# EAGLE schematic MainECU rev16 (EAGLE 9.6.2)

## Sheet 1 of 9
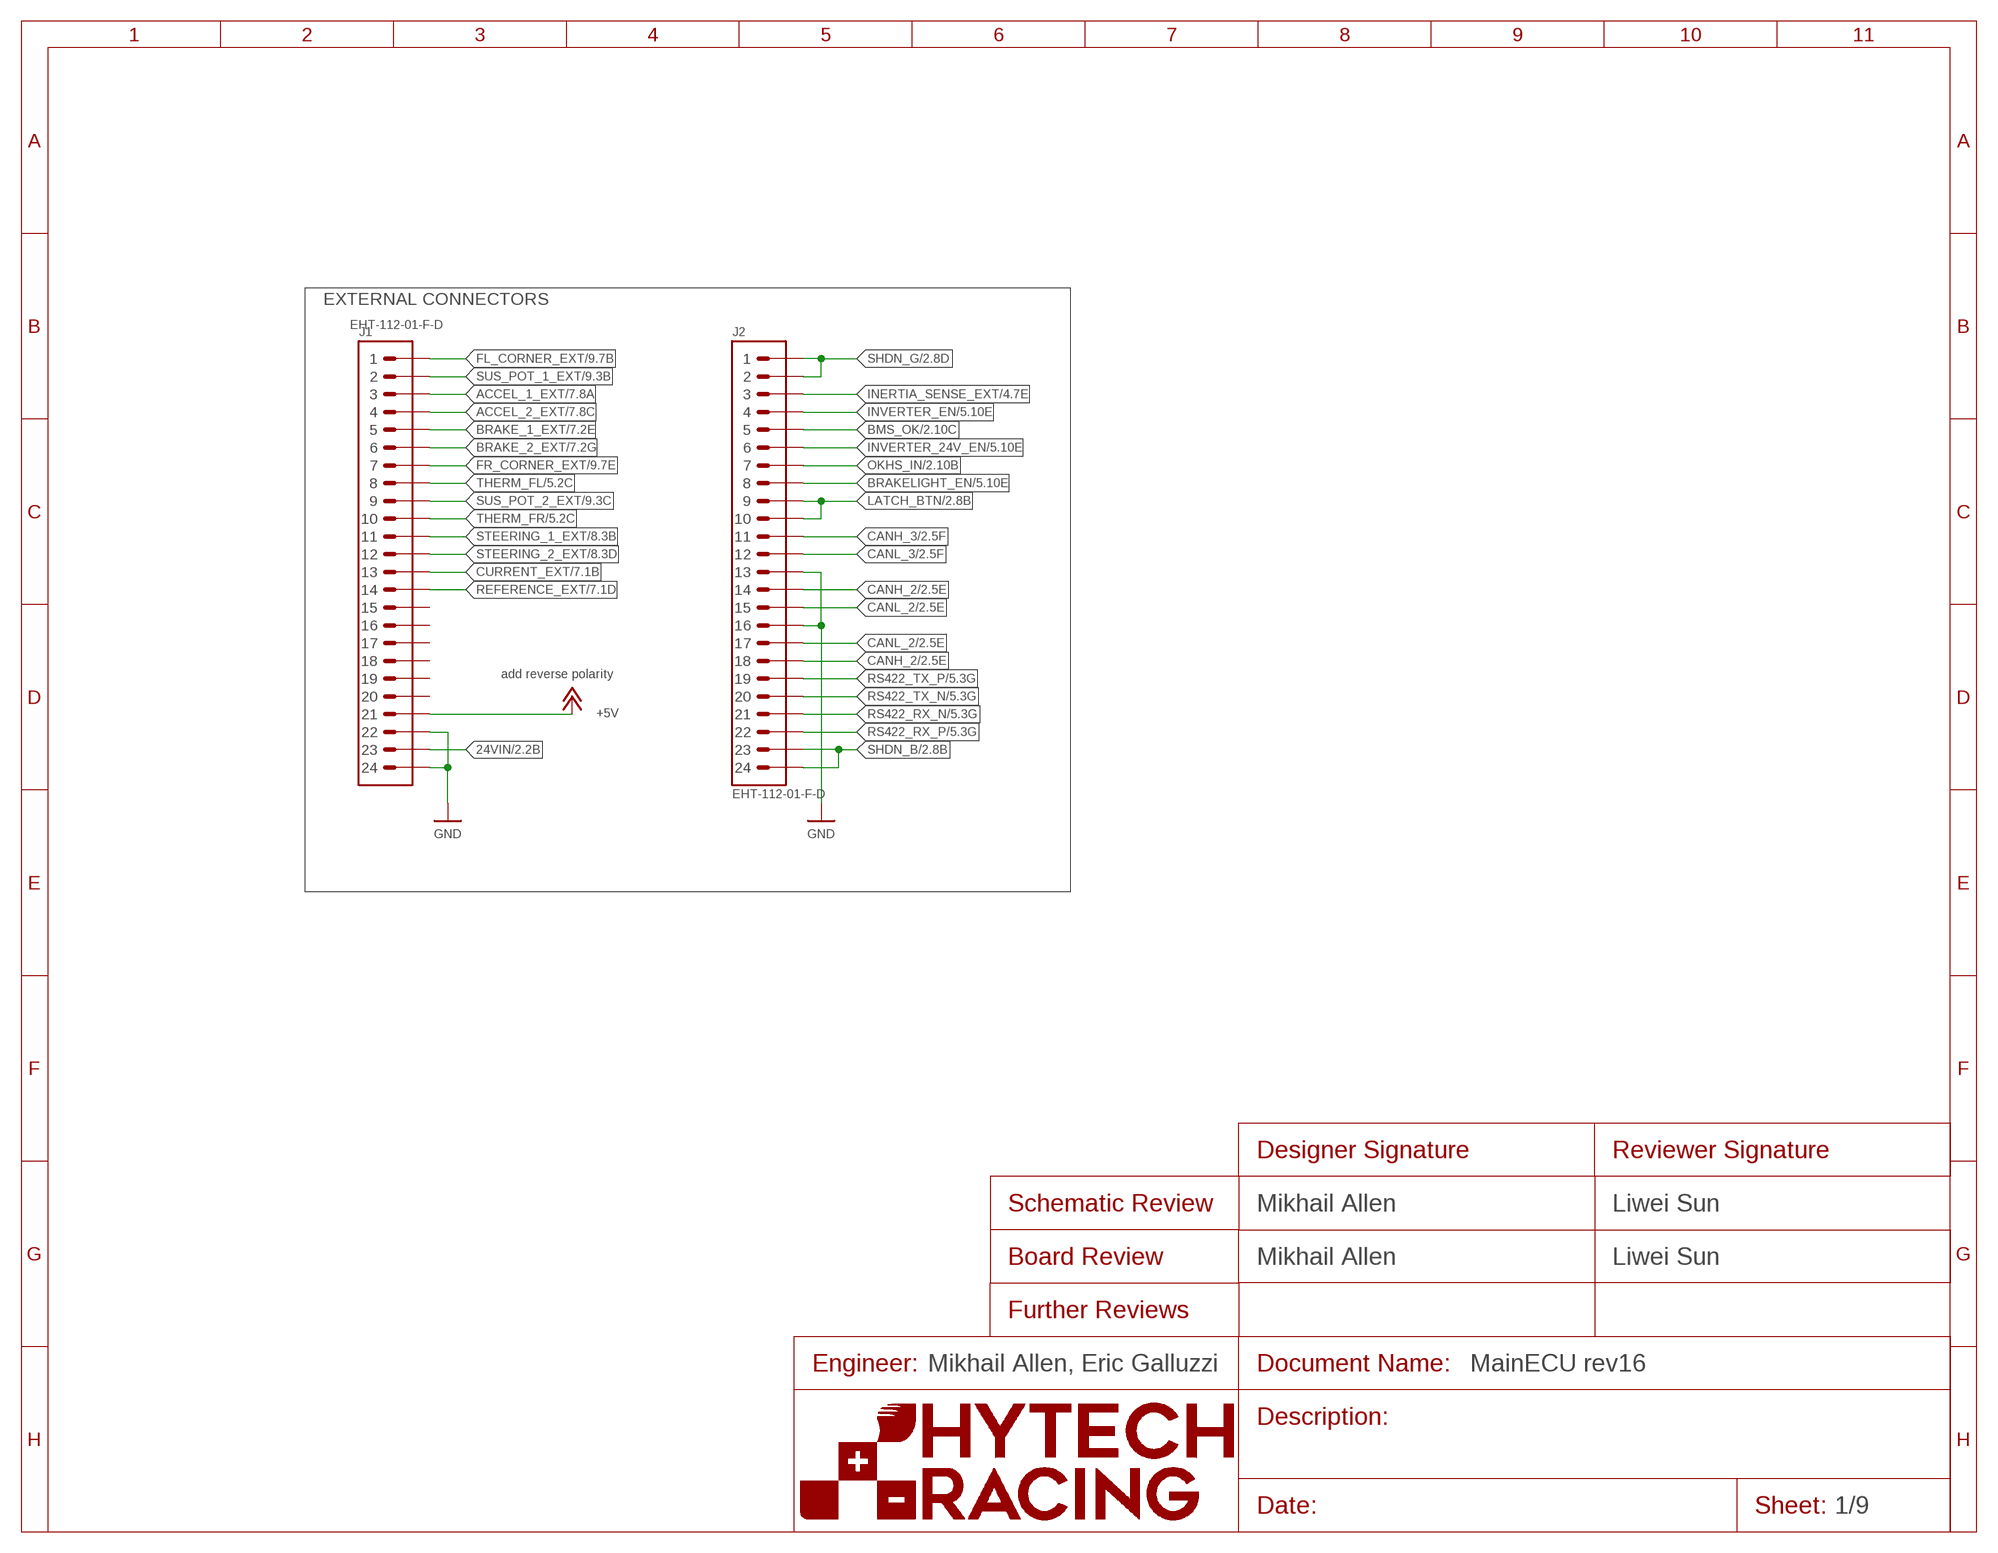
[diagram p0: schematic, sheet 1]
FRAME8 (FRAME): DESIGNER_BOARD: Mikhail Allen; DESIGNER_SCHEMATIC: Mikhail Allen; ENGINEER: Mikhail Allen, Eric Galluzzi; REVIEWER_BOARD: Liwei Sun; REVIEWER_SCHEMATIC: Liwei Sun

### Parts
J1  CONNECTOR-24_CONNECTOR-24_  [EHT-112-01]
J2  CONNECTOR-24_CONNECTOR-24_  [EHT-112-01]

### Nets
24VIN: J1.23 ; also sheet 2
+5V: J1.21 ; also sheet 2,3,5,6,7
ACCEL_1_EXT: J1.3 ; also sheet 7
ACCEL_2_EXT: J1.4 ; also sheet 7
BMS_OK: J2.5 ; also sheet 2,4
BRAKE_1_EXT: J1.5 ; also sheet 7
BRAKE_2_EXT: J1.6 ; also sheet 7
BRAKELIGHT_EN: J2.8 ; also sheet 5
CANH_2 [diff pairs]: J2.14 J2.18 ; also sheet 2,5,6
CANH_3 [diff pairs]: J2.11 ; also sheet 2,5,6
CANL_2 [diff pairs]: J2.15 J2.17 ; also sheet 2,5,6
CANL_3 [diff pairs]: J2.12 ; also sheet 2,5,6
CURRENT_EXT: J1.13 ; also sheet 7
FL_CORNER_EXT [diff pairs]: J1.1 ; also sheet 9
FR_CORNER_EXT: J1.7 ; also sheet 9
GND: J1.22 J1.24 J2.13 J2.16 ; also sheet 2,3,4,5,6,7,8,9
INERTIA_SENSE_EXT: J2.3 ; also sheet 4
INVERTER_24V_EN: J2.6 ; also sheet 5
INVERTER_EN: J2.4 ; also sheet 5
LATCH_BTN: J2.9 J2.10 ; also sheet 2,4
OKHS_IN: J2.7 ; also sheet 2,4
REFERENCE_EXT: J1.14 ; also sheet 7
RS422_RX_N [diff pairs]: J2.21 ; also sheet 5
RS422_RX_P [diff pairs]: J2.22 ; also sheet 5
RS422_TX_N [diff pairs]: J2.20 ; also sheet 5
RS422_TX_P [diff pairs]: J2.19 ; also sheet 5
SHDN_B: J2.23 J2.24 ; also sheet 2,4
SHDN_G: J2.1 J2.2 ; also sheet 2,4
STEERING_1_EXT: J1.11 ; also sheet 8
STEERING_2_EXT: J1.12 ; also sheet 8
SUS_POT_1_EXT [diff pairs]: J1.2 ; also sheet 9
SUS_POT_2_EXT: J1.9 ; also sheet 9
THERM_FL: J1.8 ; also sheet 5,8
THERM_FR: J1.10 ; also sheet 5,8
Unconnected: J1.15 J1.16 J1.17 J1.18 J1.19 J1.20

### Notes on the sheet
- EXTERNAL CONNECTORS
- add reverse polarity

## Sheet 2 of 9
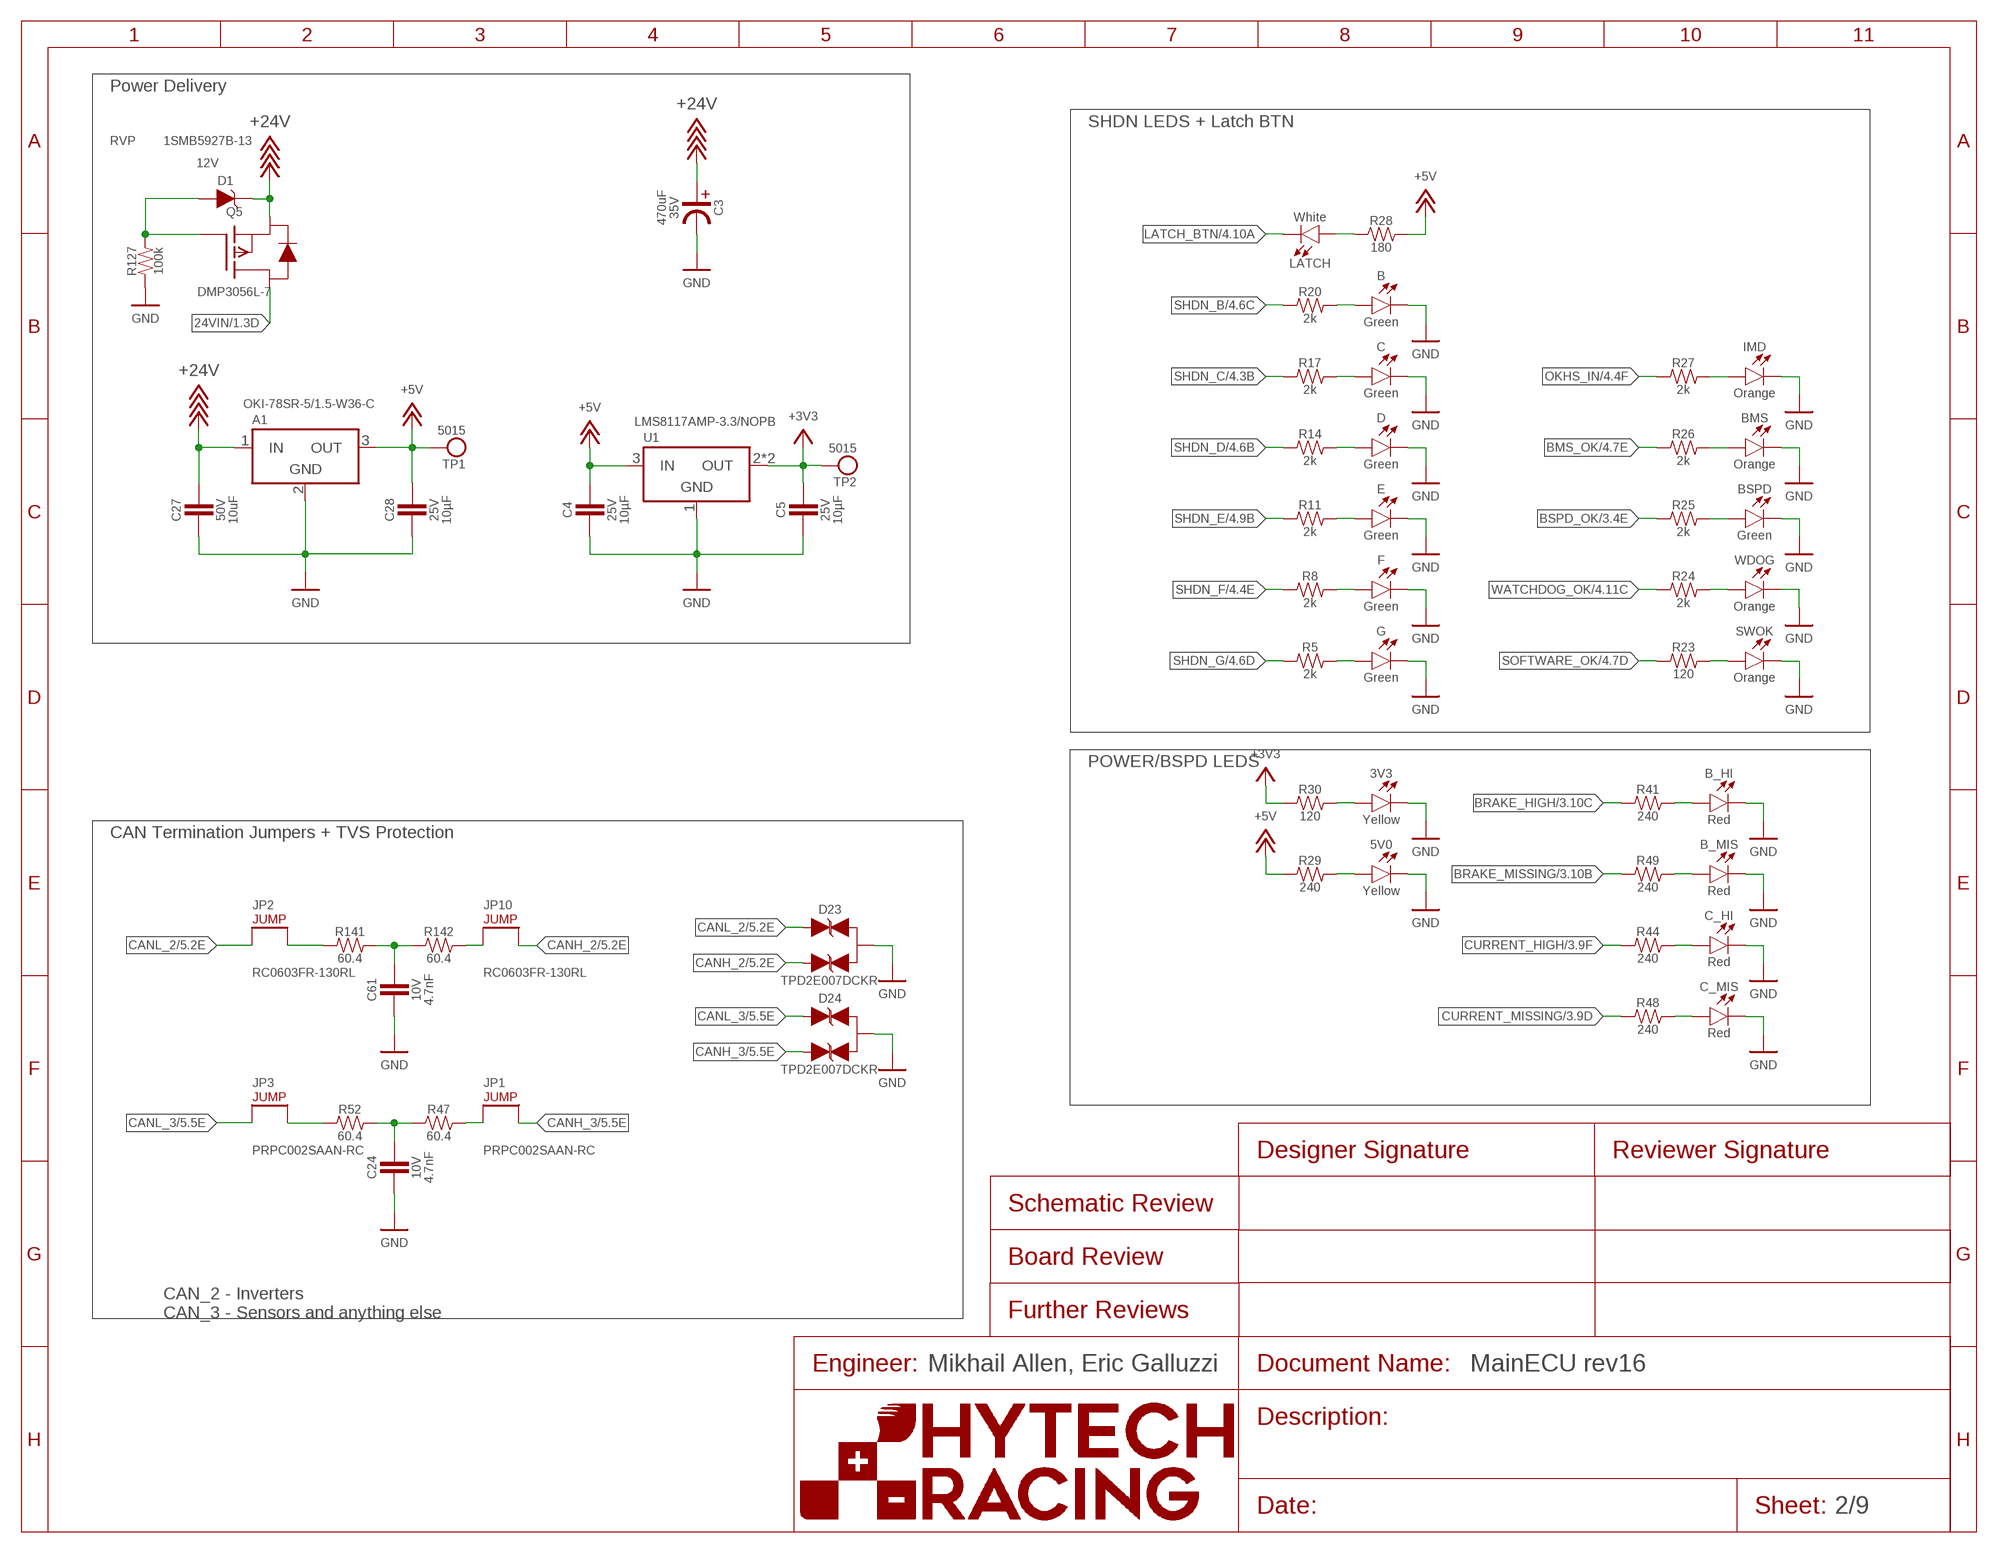
[diagram p1: schematic, sheet 2]
FRAME1 (FRAME): ENGINEER: Mikhail Allen, Eric Galluzzi

### Parts
3V3  LED_0603_YELLOW  [0603-LED]
5V0  LED_0603_YELLOW  [0603-LED]
A1  VOLTAGE_REGULATOR_MODULE_OKI-78SR_5V  [OKI-78SR(VERTICAL)]
B  LED_0603_GREEN  [0603-LED]
B_HI  LED_0603_RED  [0603-LED]
B_MIS  LED_0603_RED  [0603-LED]
BMS  LED_0603_ORANGE  [0603-LED]
BSPD  LED_0603_GREEN  [0603-LED]
C  LED_0603_GREEN  [0603-LED]
C3  CAPACITOR_ELECTROLYTIC_EEH_AZS_470UF  [EEH-AZS]
C4  CAPACITOR_0603_25V_10UF  [0603-CAP]
C5  CAPACITOR_0603_25V_10UF  [0603-CAP]
C24  CAPACITOR_0603_10V_4.7NF  [0603-CAP]
C27  CAPACITOR_0805_50V_10UF  [0805-CAP]
C28  CAPACITOR_0603_25V_10UF  [0603-CAP]
C61  CAPACITOR_0603_10V_4.7NF  [0603-CAP]
C_HI  LED_0603_RED  [0603-LED]
C_MIS  LED_0603_RED  [0603-LED]
D  LED_0603_GREEN  [0603-LED]
D1  ZENER_1.5SMBJ_12V  [1.5SMBJ]
D23  TVS_BIDIRECTIONAL_DUAL  [SC-70-3]
D24  TVS_BIDIRECTIONAL_DUAL  [SC-70-3]
E  LED_0603_GREEN  [0603-LED]
F  LED_0603_GREEN  [0603-LED]
G  LED_0603_GREEN  [0603-LED]
IMD  LED_0603_ORANGE  [0603-LED]
JP1  JUMPER__1X02  [1X02]
JP2  JUMPER_0603_  [0603-RES]
JP3  JUMPER__1X02  [1X02]
JP10  JUMPER_0603_  [0603-RES]
LATCH  LED_0603_WHITE  [0603-LED]
Q5  TRANSISTOR_P_MOS_SOT-23_DMP3056L-7  [SOT-23]
R5  RESISTOR_0603_2K  [0603-RES]
R8  RESISTOR_0603_2K  [0603-RES]
R11  RESISTOR_0603_2K  [0603-RES]
R14  RESISTOR_0603_2K  [0603-RES]
R17  RESISTOR_0603_2K  [0603-RES]
R20  RESISTOR_0603_2K  [0603-RES]
R23  RESISTOR_0603_120  [0603-RES]
R24  RESISTOR_0603_2K  [0603-RES]
R25  RESISTOR_0603_2K  [0603-RES]
R26  RESISTOR_0603_2K  [0603-RES]
R27  RESISTOR_0603_2K  [0603-RES]
R28  RESISTOR_0603_180  [0603-RES]
R29  RESISTOR_0603_240  [0603-RES]
R30  RESISTOR_0603_120  [0603-RES]
R41  RESISTOR_0603_240  [0603-RES]
R44  RESISTOR_0603_240  [0603-RES]
R47  RESISTOR_0603_60.4  [0603-RES]
R48  RESISTOR_0603_240  [0603-RES]
R49  RESISTOR_0603_240  [0603-RES]
R52  RESISTOR_0603_60.4  [0603-RES]
R127  RESISTOR_0603_100K  [0603-RES]
R141  RESISTOR_0603_60.4  [0603-RES]
R142  RESISTOR_0603_60.4  [0603-RES]
SWOK  LED_0603_ORANGE  [0603-LED]
TP1  TEST_POINT  [5015]
TP2  TEST_POINT  [5015]
U1  VOLTAGE_REGULATOR_SOT-223_3.3V  [SOT-223]
WDOG  LED_0603_ORANGE  [0603-LED]

### Nets
24VIN: Q5.3(D) ; also sheet 1
+3V3: C5.1 R30.1 TP2.1 U1.2(OUT) U1.4(OUT) ; also sheet 3,4,5,6,7,8,9
+5V: A1.3(OUT) C4.1 C28.1 R28.2 R29.1 TP1.1 U1.3(IN) ; also sheet 1,3,5,6,7
+24V: A1.1(IN) C3.PLUS C27.1 D1.2(C) Q5.2(S) ; also sheet 3,4,6
BMS_OK: R26.1 ; also sheet 1,4
BRAKE_HIGH: R41.1 ; also sheet 3
BRAKE_MISSING: R49.1 ; also sheet 3
BSPD_OK: R25.1 ; also sheet 3,4
CANH_2 [diff pairs]: D23.2(C2) JP10.2 ; also sheet 1,5,6
CANH_3 [diff pairs]: D24.2(C2) JP1.2 ; also sheet 1,5,6
CANL_2 [diff pairs]: D23.1(C1) JP2.1 ; also sheet 1,5,6
CANL_3 [diff pairs]: D24.1(C1) JP3.1 ; also sheet 1,5,6
CURRENT_HIGH: R44.1 ; also sheet 3
CURRENT_MISSING: R48.1 ; also sheet 3
GND: 3V3.1(C) 5V0.1(C) A1.2(GND) B.1(C) B_HI.1(C) B_MIS.1(C) BMS.1(C) BSPD.1(C) C3.MINUS C4.2 C5.2 C24.2 C27.2 C28.2 C61.2 C.1(C) C_HI.1(C) C_MIS.1(C) D23.3(A) D24.3(A) D.1(C) E.1(C) F.1(C) G.1(C) IMD.1(C) R127.1 SWOK.1(C) U1.1(GND) WDOG.1(C) ; also sheet 1,3,4,5,6,7,8,9
LATCH_BTN: LATCH.1(C) ; also sheet 1,4
N$2: JP10.1 R142.2
N$6: JP1.1 R47.2
N$7: C61.1 R141.2 R142.1
N$8: C24.1 R47.1 R52.2
N$9: JP3.2 R52.1
N$13: G.2(A) R5.2
N$15: LATCH.2(A) R28.1
N$16: B.2(A) R20.2
N$17: C.2(A) R17.2
N$18: D.2(A) R14.2
N$19: E.2(A) R11.2
N$20: F.2(A) R8.2
N$28: B_MIS.2(A) R49.2
N$29: C_HI.2(A) R44.2
N$30: C_MIS.2(A) R48.2
N$36: D1.1(A) Q5.1(G) R127.2
N$37: JP2.2 R141.1
N$40: IMD.2(A) R27.2
N$41: BMS.2(A) R26.2
N$42: BSPD.2(A) R25.2
N$43: R24.2 WDOG.2(A)
N$44: 3V3.2(A) R30.2
N$45: R23.2 SWOK.2(A)
N$47: 5V0.2(A) R29.2
N$56: B_HI.2(A) R41.2
OKHS_IN: R27.1 ; also sheet 1,4
SHDN_B: R20.1 ; also sheet 1,4
SHDN_C: R17.1 ; also sheet 4
SHDN_D: R14.1 ; also sheet 4
SHDN_E: R11.1 ; also sheet 4
SHDN_F: R8.1 ; also sheet 4
SHDN_G: R5.1 ; also sheet 1,4
SOFTWARE_OK: R23.1 ; also sheet 4,5
WATCHDOG_OK: R24.1 ; also sheet 4

### Notes on the sheet
- Power Delivery
- SHDN LEDS + Latch BTN
- RVP
- POWER/BSPD LEDS
- CAN Termination Jumpers + TVS Protection
- CAN_2 - Inverters
  CAN_3 - Sensors and anything else

## Sheet 3 of 9
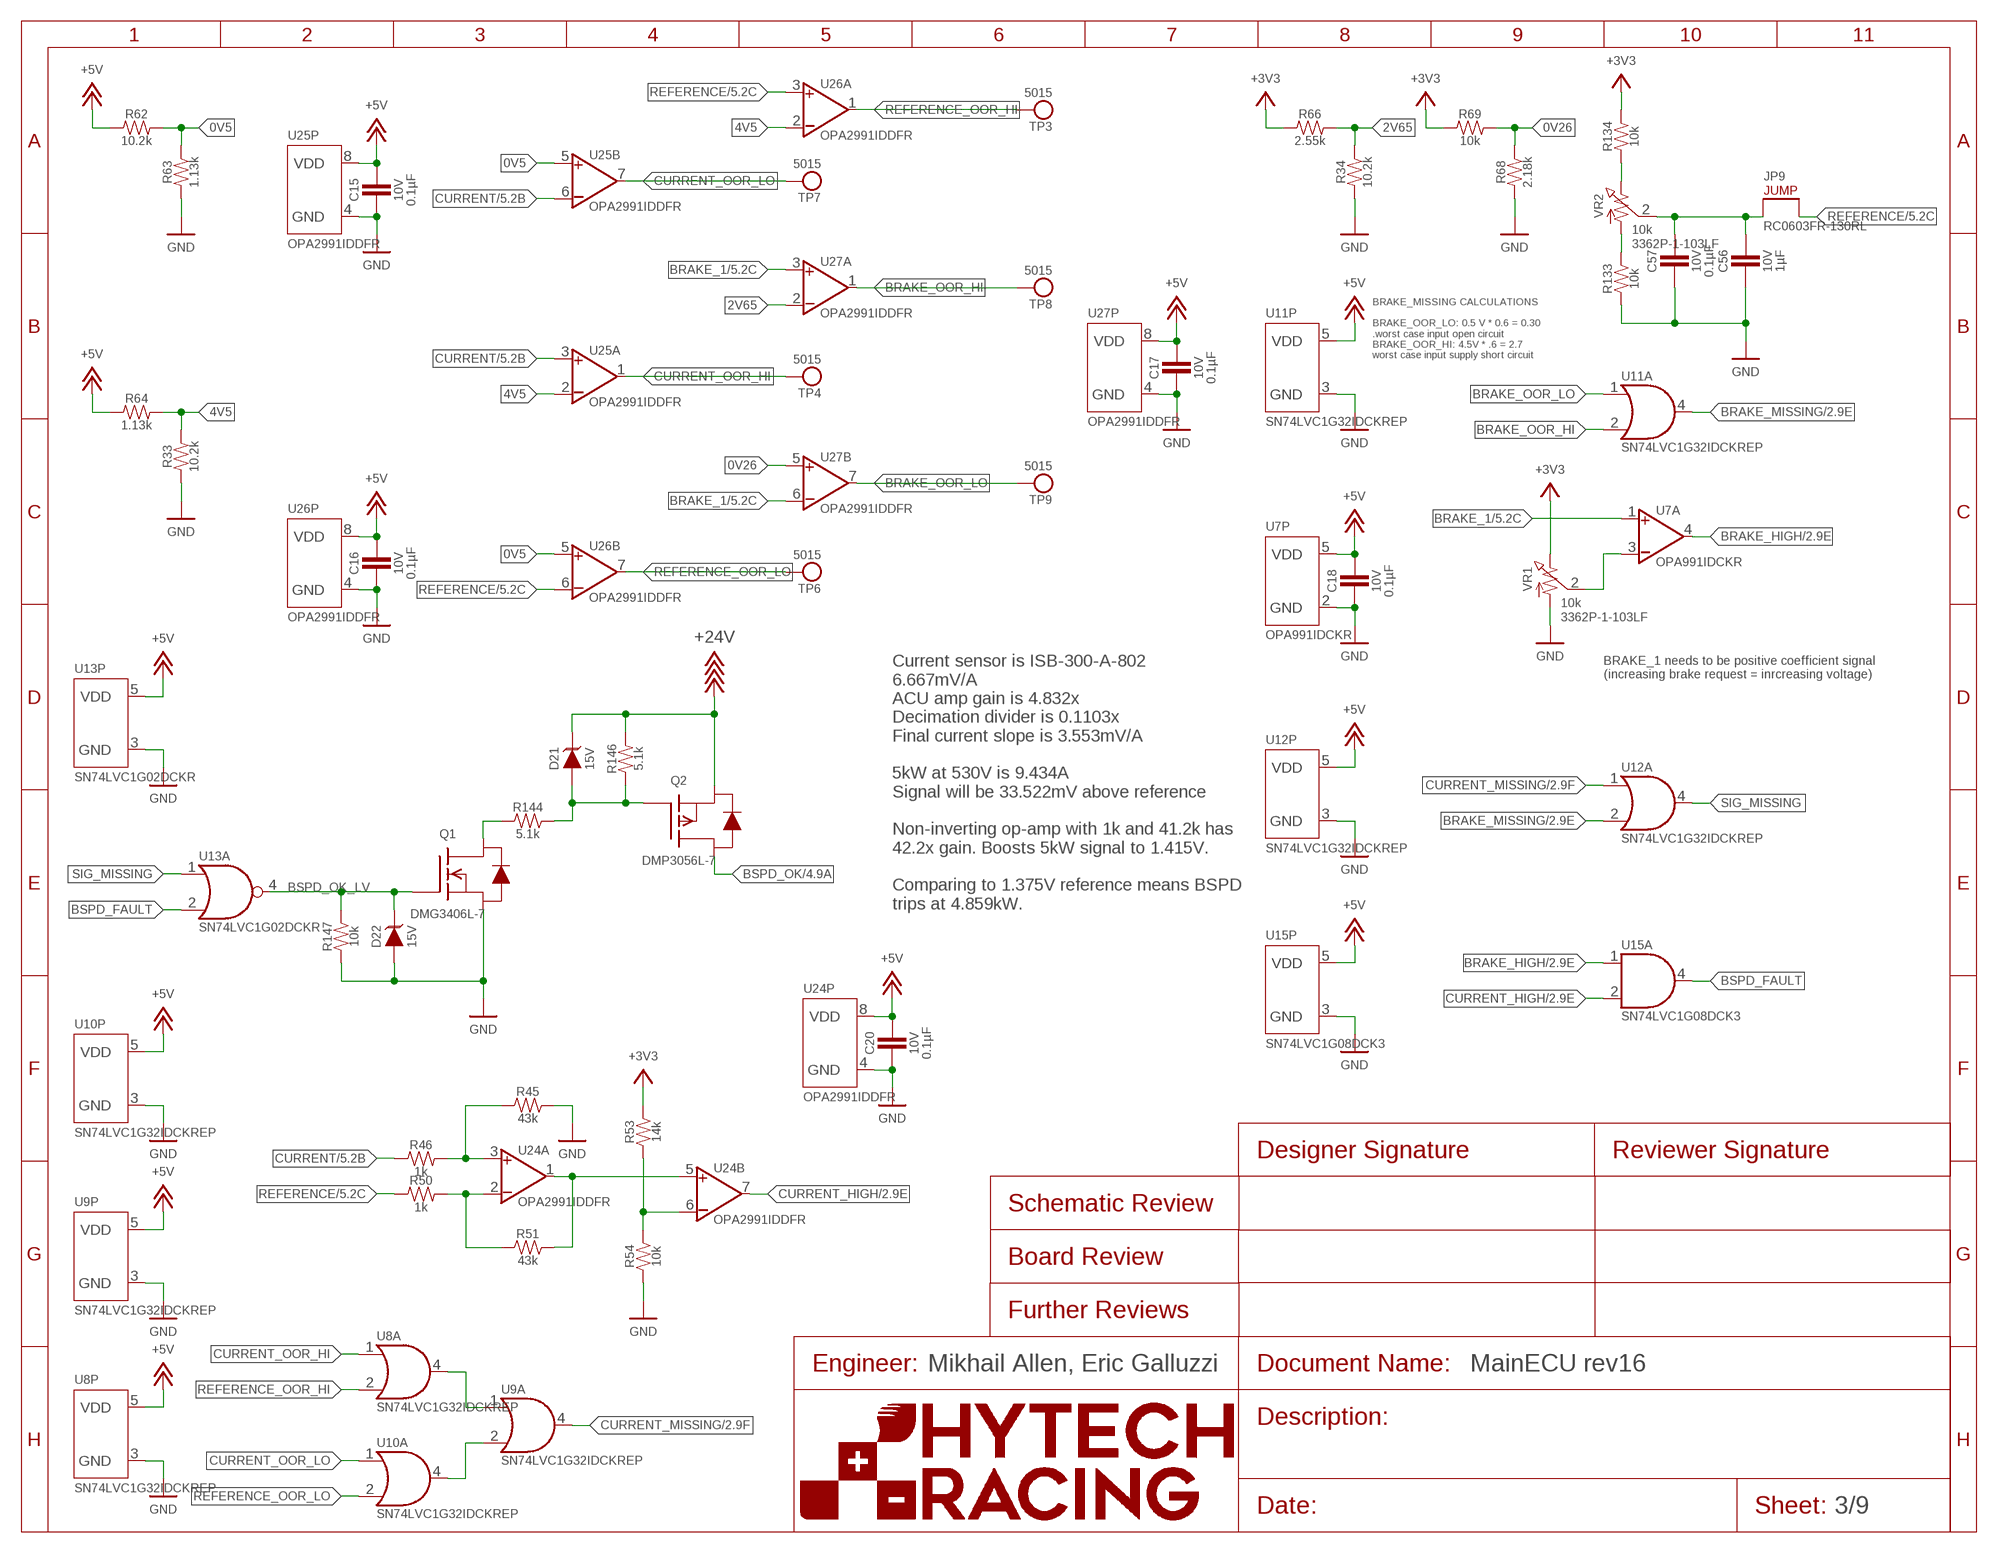
[diagram p2: schematic, sheet 3]
FRAME7 (FRAME): ENGINEER: Mikhail Allen, Eric Galluzzi

### Parts
C15  CAPACITOR_0603_10V_0.1UF  [0603-CAP]
C16  CAPACITOR_0603_10V_0.1UF  [0603-CAP]
C17  CAPACITOR_0603_10V_0.1UF  [0603-CAP]
C18  CAPACITOR_0603_10V_0.1UF  [0603-CAP]
C20  CAPACITOR_0603_10V_0.1UF  [0603-CAP]
C56  CAPACITOR_0603_10V_1UF  [0603-CAP]
C57  CAPACITOR_0603_10V_0.1UF  [0603-CAP]
D21  TVS__15V  [SOT-23]
D22  TVS__15V  [SOT-23]
JP9  DNP  JUMPER_0603_  [0603-RES]
Q1  TRANSISTOR_N_MOS__DMG3406L-7  [SOT-23]
Q2  TRANSISTOR_P_MOS_SOT-23_DMP3056L-7  [SOT-23]
R33  RESISTOR_0603_10.2K  [0603-RES]
R34  RESISTOR_0603_10.2K  [0603-RES]
R45  RESISTOR_0603_43K  [0603-RES]
R46  RESISTOR_0603_1K  [0603-RES]
R50  RESISTOR_0603_1K  [0603-RES]
R51  RESISTOR_0603_43K  [0603-RES]
R53  RESISTOR_0603_14K  [0603-RES]
R54  RESISTOR_0603_10K  [0603-RES]
R62  RESISTOR_0603_10.2K  [0603-RES]
R63  RESISTOR_0603_1.13K  [0603-RES]
R64  RESISTOR_0603_1.13K  [0603-RES]
R66  RESISTOR_0603_2.55K  [0603-RES]
R68  RESISTOR_0603_2.18K  [0603-RES]
R69  RESISTOR_0603_10K  [0603-RES]
R133  RESISTOR_0603_10K  [0603-RES]
R134  RESISTOR_0603_10K  [0603-RES]
R144  RESISTOR_0603_5.1K  [0603-RES]
R146  RESISTOR_0603_5.1K  [0603-RES]
R147  RESISTOR_0603_10K  [0603-RES]
TP3  TEST_POINT  [5015]
TP4  TEST_POINT  [5015]
TP6  TEST_POINT  [5015]
TP7  TEST_POINT  [5015]
TP8  TEST_POINT  [5015]
TP9  TEST_POINT  [5015]
U7  OPAMP_1_CHANNEL_OPA991  [SC-70-5]
U8  LOGICGATE_OR  [SC-70-5]
U9  LOGICGATE_OR  [SC-70-5]
U10  LOGICGATE_OR  [SC-70-5]
U11  LOGICGATE_OR  [SC-70-5]
U12  LOGICGATE_OR  [SC-70-5]
U13  LOGICGATE_NOR  [SC-70-5]
U15  LOGICGATE_AND_DCK3  [SC-70-5]
U24  OPAMP_2_CHANNEL_OPA_2991  [SOT-23-8]
U25  OPAMP_2_CHANNEL_OPA_2991  [SOT-23-8]
U26  OPAMP_2_CHANNEL_OPA_2991  [SOT-23-8]
U27  OPAMP_2_CHANNEL_OPA_2991  [SOT-23-8]
VR1  RESISTOR_TRIMPOT_10K_3362P  [3362P]
VR2  RESISTOR_TRIMPOT_10K_3362P  [3362P]

### Nets
0V5: R62.2 R63.2 U25.5(B:VIN+) U26.5(B:VIN+)
0V26: R68.2 R69.2 U27.5(B:VIN+)
2V65: R34.2 R66.2 U27.2(A:VIN-)
4V5: R33.2 R64.2 U25.2(A:VIN-) U26.2(A:VIN-)
+3V3: R53.2 R66.1 R69.1 R134.2 VR1.3 ; also sheet 2,4,5,6,7,8,9
+5V: C15.1 C16.1 C17.1 C18.1 C20.1 R62.1 R64.1 U7.5(P:VDD) U8.5(P:VDD) U9.5(P:VDD) U10.5(P:VDD) U11.5(P:VDD) U12.5(P:VDD) U13.5(P:VDD) U15.5(P:VDD) U24.8(P:VDD) U25.8(P:VDD) U26.8(P:VDD) U27.8(P:VDD) ; also sheet 1,2,5,6,7
+24V: D21.3(C) Q2.2(S) R146.2 ; also sheet 2,4,6
BRAKE_1: U7.1(A:VIN+) U27.3(A:VIN+) U27.6(B:VIN-) ; also sheet 5,7
BRAKE_HIGH: U7.4(A:VOUT) U15.1(A:IN1) ; also sheet 2
BRAKE_MISSING: U11.4(A:OUT) U12.2(A:IN2) ; also sheet 2
BRAKE_OOR_HI: TP8.1 U11.2(A:IN2) U27.1(A:VOUT)
BRAKE_OOR_LO: TP9.1 U11.1(A:IN1) U27.7(B:VOUT)
BSPD_FAULT: U13.2(A:IN2) U15.4(A:OUT)
BSPD_OK: Q2.3(D) ; also sheet 2,4
BSPD_OK_LV: D22.3(C) Q1.1(G) R147.2 U13.4(A:OUT)
CURRENT: R46.1 U25.3(A:VIN+) U25.6(B:VIN-) ; also sheet 5,6,7
CURRENT_HIGH: U15.2(A:IN2) U24.7(B:VOUT) ; also sheet 2
CURRENT_MISSING: U9.4(A:OUT) U12.1(A:IN1) ; also sheet 2
CURRENT_OOR_HI: TP4.1 U8.1(A:IN1) U25.1(A:VOUT)
CURRENT_OOR_LO: TP7.1 U10.1(A:IN1) U25.7(B:VOUT)
GND: C15.2 C16.2 C17.2 C18.2 C20.2 C56.2 C57.2 D22.1(A) Q1.2(S) R33.1 R34.1 R45.2 R54.1 R63.1 R68.1 R133.1 R147.1 U7.2(P:GND) U8.3(P:GND) U9.3(P:GND) U10.3(P:GND) U11.3(P:GND) U12.3(P:GND) U13.3(P:GND) U15.3(P:GND) U24.4(P:GND) U25.4(P:GND) U26.4(P:GND) U27.4(P:GND) VR1.1 ; also sheet 1,2,4,5,6,7,8,9
N$26: R45.1 R46.2 U24.3(A:VIN+)
N$39: R134.1 VR2.3
N$46: C56.1 C57.1 JP9.1 VR2.2
N$48: R133.2 VR2.1
N$65: R53.1 R54.2 U24.6(B:VIN-)
N$67: R50.2 R51.1 U24.2(A:VIN-)
N$68: R51.2 U24.1(A:VOUT) U24.5(B:VIN+)
N$73: U7.3(A:VIN-) VR1.2
N$74: D21.1(A) Q2.1(G) R144.2 R146.1
N$75: Q1.3(D) R144.1
OOR_HI: U8.4(A:OUT) U9.1(A:IN1)
OOR_LO: U9.2(A:IN2) U10.4(A:OUT)
REFERENCE: JP9.2 R50.1 U26.3(A:VIN+) U26.6(B:VIN-) ; also sheet 5,6,7
REFERENCE_OOR_HI: TP3.1 U8.2(A:IN2) U26.1(A:VOUT)
REFERENCE_OOR_LO: TP6.1 U10.2(A:IN2) U26.7(B:VOUT)
SIG_MISSING: U12.4(A:OUT) U13.1(A:IN1)

### Notes on the sheet
- BRAKE_MISSING CALCULATIONS
  
  BRAKE_OOR_LO: 0.5 V * 0.6 = 0.30
  .worst case input open circuit
  BRAKE_OOR_HI: 4.5V * .6 = 2.7
  worst case input supply short circuit
- BRAKE_1 needs to be positive coefficient signal
  (increasing brake request = inrcreasing voltage)
- Current sensor is ISB-300-A-802
  6.667mV/A
  ACU amp gain is 4.832x
  Decimation divider is 0.1103x
  Final current slope is 3.553mV/A
  
  5kW at 530V is 9.434A
  Signal will be 33.522mV above reference
  
  Non-inverting op-amp with 1k and 41.2k has
  42.2x gain. Boosts 5kW signal to 1.415V.
  
  Comparing to 1.375V reference means BSPD
  trips at 4.859kW.

## Sheet 4 of 9
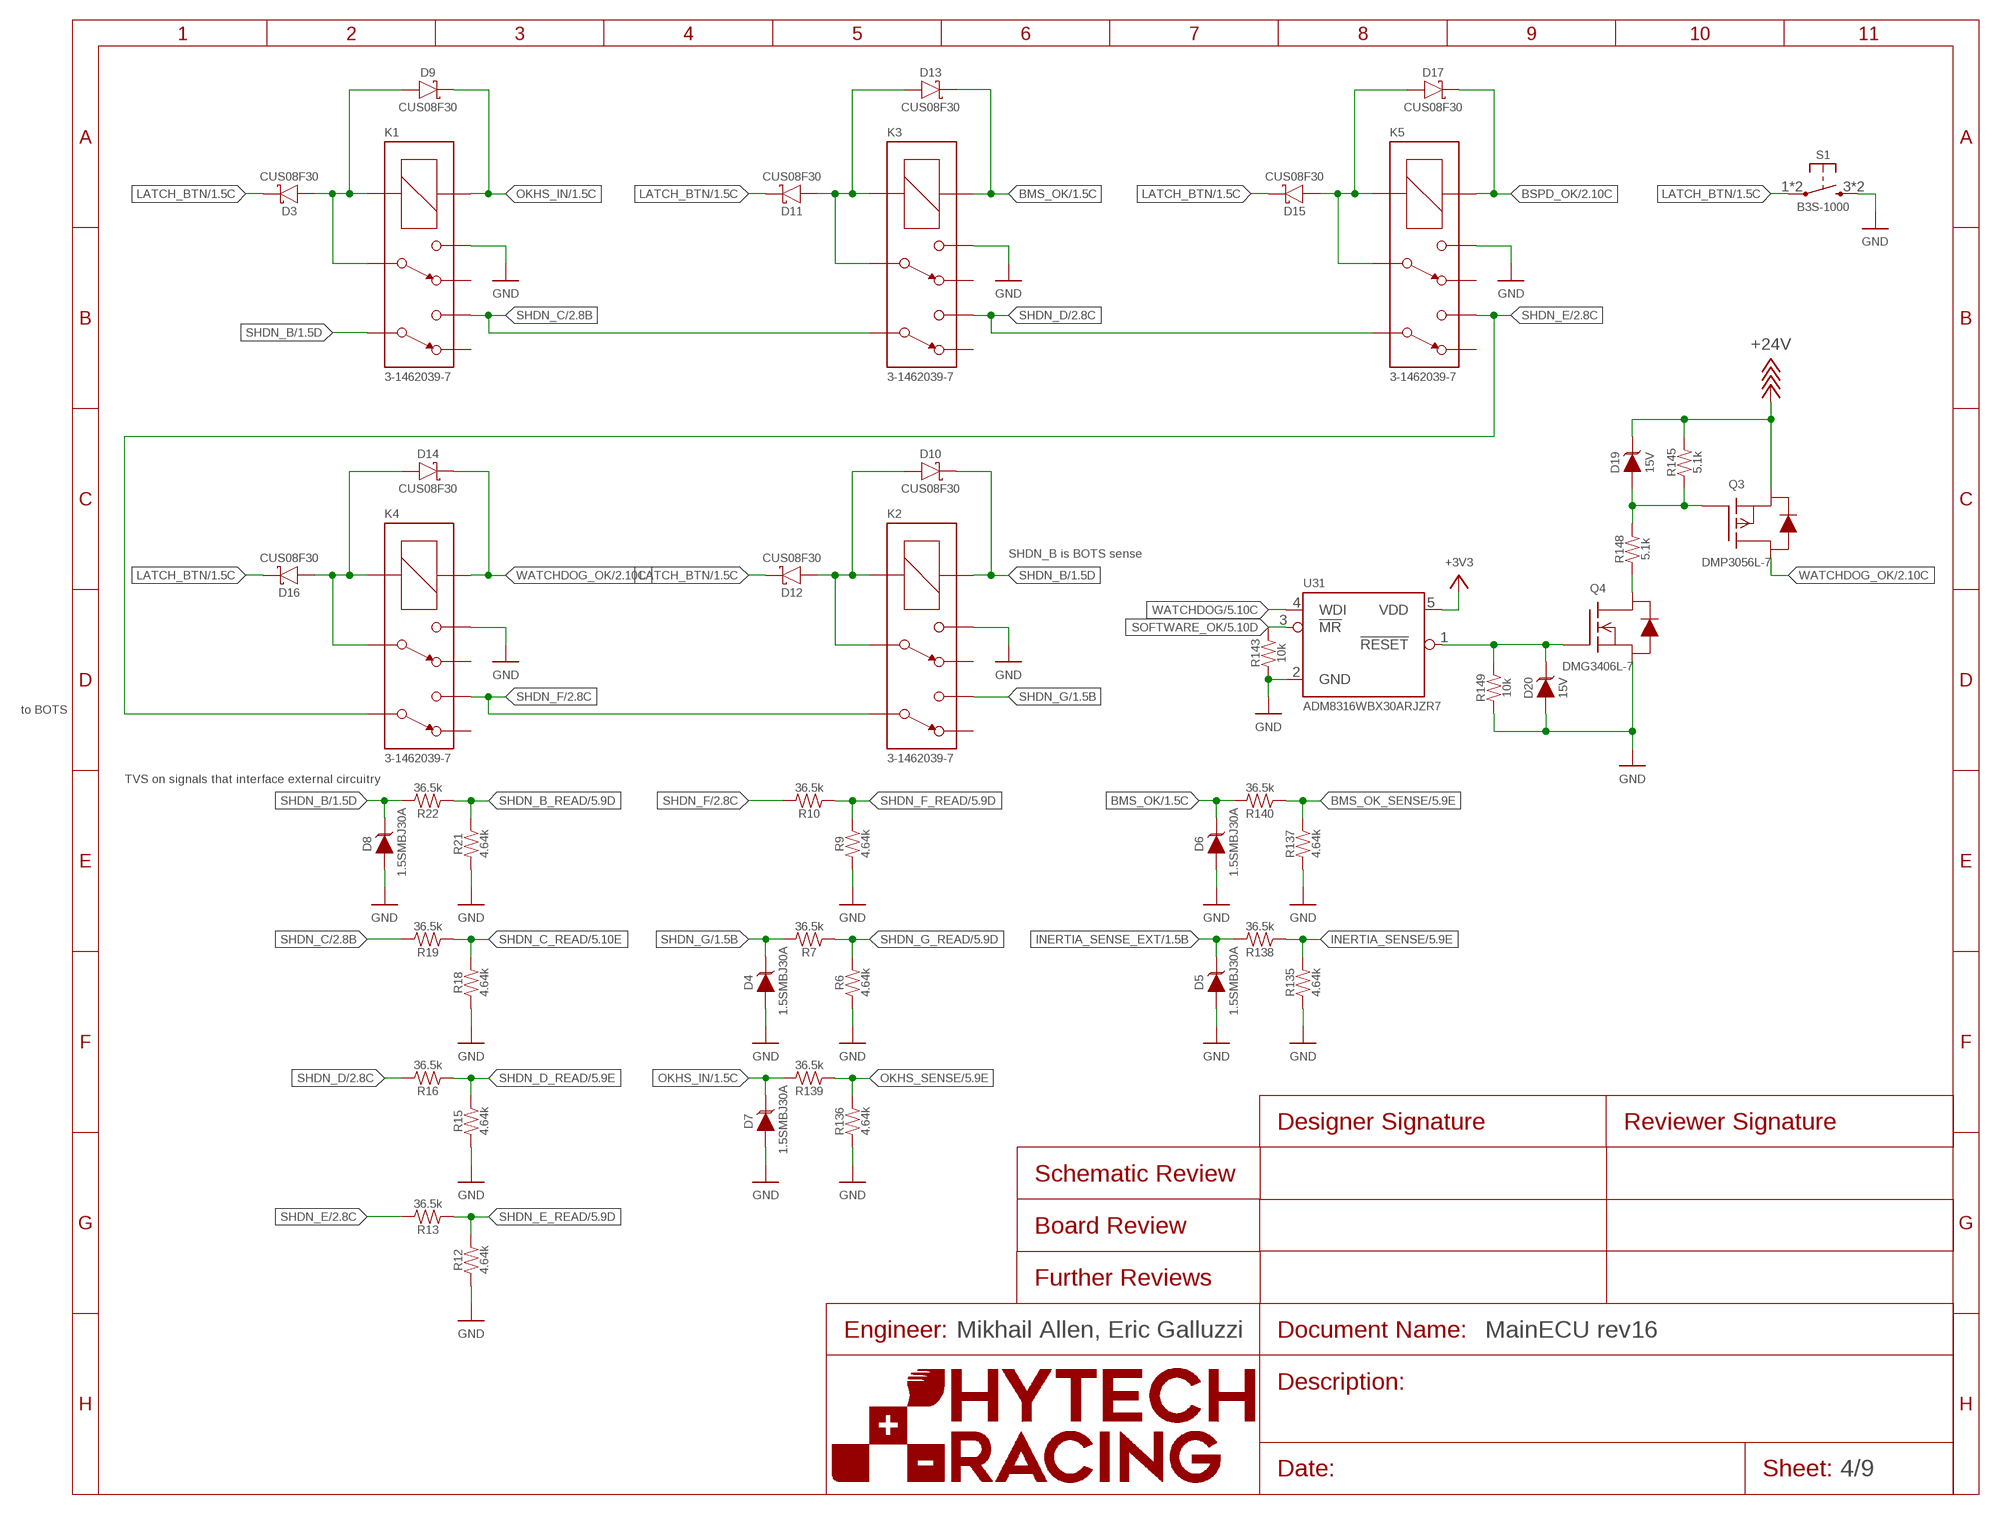
[diagram p3: schematic, sheet 4]
FRAME2 (FRAME): ENGINEER: Mikhail Allen, Eric Galluzzi

### Parts
D3  SCHOTTKY_SOD323_30V  [SOD-323]
D4  TVS_DO-214AA_30V  [1.5SMBJ]
D5  TVS_DO-214AA_30V  [1.5SMBJ]
D6  TVS_DO-214AA_30V  [1.5SMBJ]
D7  TVS_DO-214AA_30V  [1.5SMBJ]
D8  TVS_DO-214AA_30V  [1.5SMBJ]
D9  SCHOTTKY_SOD323_30V  [SOD-323]
D10  SCHOTTKY_SOD323_30V  [SOD-323]
D11  SCHOTTKY_SOD323_30V  [SOD-323]
D12  SCHOTTKY_SOD323_30V  [SOD-323]
D13  SCHOTTKY_SOD323_30V  [SOD-323]
D14  SCHOTTKY_SOD323_30V  [SOD-323]
D15  SCHOTTKY_SOD323_30V  [SOD-323]
D16  SCHOTTKY_SOD323_30V  [SOD-323]
D17  SCHOTTKY_SOD323_30V  [SOD-323]
D19  TVS__15V  [SOT-23]
D20  TVS__15V  [SOT-23]
K1  RELAY_DPDT_07DSMT  [IM*G]
K2  RELAY_DPDT_07DSMT  [IM*G]
K3  RELAY_DPDT_07DSMT  [IM*G]
K4  RELAY_DPDT_07DSMT  [IM*G]
K5  RELAY_DPDT_07DSMT  [IM*G]
Q3  TRANSISTOR_P_MOS_SOT-23_DMP3056L-7  [SOT-23]
Q4  TRANSISTOR_N_MOS__DMG3406L-7  [SOT-23]
R6  RESISTOR_0603_4.64K  [0603-RES]
R7  RESISTOR_0603_36.5K  [0603-RES]
R9  RESISTOR_0603_4.64K  [0603-RES]
R10  RESISTOR_0603_36.5K  [0603-RES]
R12  RESISTOR_0603_4.64K  [0603-RES]
R13  RESISTOR_0603_36.5K  [0603-RES]
R15  RESISTOR_0603_4.64K  [0603-RES]
R16  RESISTOR_0603_36.5K  [0603-RES]
R18  RESISTOR_0603_4.64K  [0603-RES]
R19  RESISTOR_0603_36.5K  [0603-RES]
R21  RESISTOR_0603_4.64K  [0603-RES]
R22  RESISTOR_0603_36.5K  [0603-RES]
R135  RESISTOR_0603_4.64K  [0603-RES]
R136  RESISTOR_0603_4.64K  [0603-RES]
R137  RESISTOR_0603_4.64K  [0603-RES]
R138  RESISTOR_0603_36.5K  [0603-RES]
R139  RESISTOR_0603_36.5K  [0603-RES]
R140  RESISTOR_0603_36.5K  [0603-RES]
R143  RESISTOR_0603_10K  [0603-RES]
R145  RESISTOR_0603_5.1K  [0603-RES]
R148  RESISTOR_0603_5.1K  [0603-RES]
R149  RESISTOR_0603_10K  [0603-RES]
S1  BUTTON  [B3S-100X]
U31  ADM8316WBX30  [SOT-23-5]

### Nets
+3V3: U31.5(VDD) ; also sheet 2,3,5,6,7,8,9
+24V: D19.3(C) Q3.2(S) R145.2 ; also sheet 2,3,6
BMS_OK: D6.2(C) D13.C K3.1(COIL+) R140.2 ; also sheet 1,2
BMS_OK_SENSE: R137.2 R140.1 ; also sheet 5
BSPD_OK: D17.C K5.1(COIL+) ; also sheet 2,3
GND: D4.1(A) D5.1(A) D6.1(A) D7.1(A) D8.1(A) D20.1(A) K1.4 K2.4 K3.4 K4.4 K5.4 Q4.2(S) R6.1 R9.1 R12.1 R15.1 R18.1 R21.1 R135.1 R136.1 R137.1 R143.1 R149.1 S1.3(S) S1.4(S) U31.2(GND) ; also sheet 1,2,3,5,6,7,8,9
INERTIA_SENSE: R135.2 R138.1 ; also sheet 5
INERTIA_SENSE_EXT: D5.2(C) R138.2 ; also sheet 1
LATCH_BTN: D3.C D11.C D12.C D15.C D16.C S1.1(P) S1.2(P) ; also sheet 1,2
N$4: D19.1(A) Q3.1(G) R145.1 R148.2
N$5: Q4.3(D) R148.1
N$21: D3.A D9.A K1.3 K1.8(COIL-)
N$22: D15.A D17.A K5.3 K5.8(COIL-)
N$23: D11.A D13.A K3.3 K3.8(COIL-)
N$24: D10.A D12.A K2.3 K2.8(COIL-)
N$25: D14.A D16.A K4.3 K4.8(COIL-)
OKHS_IN: D7.2(C) D9.C K1.1(COIL+) R139.2 ; also sheet 1,2
OKHS_SENSE: R136.2 R139.1 ; also sheet 5
SHDN_B: D8.2(C) D10.C K1.6 K2.1(COIL+) R22.2 ; also sheet 1,2
SHDN_B_READ: R21.2 R22.1 ; also sheet 5
SHDN_C: K1.5 K3.6 R19.2 ; also sheet 2
SHDN_C_READ: R18.2 R19.1 ; also sheet 5
SHDN_D: K3.5 K5.6 R16.2 ; also sheet 2
SHDN_D_READ: R15.2 R16.1 ; also sheet 5
SHDN_E: K4.6 K5.5 R13.2 ; also sheet 2
SHDN_E_READ: R12.2 R13.1 ; also sheet 5
SHDN_F: K2.6 K4.5 R10.2 ; also sheet 2
SHDN_F_READ: R9.2 R10.1 ; also sheet 5
SHDN_G: D4.2(C) K2.5 R7.2 ; also sheet 1,2
SHDN_G_READ: R6.2 R7.1 ; also sheet 5
SOFTWARE_OK: R143.2 U31.3(!MR!) ; also sheet 2,5
WATCHDOG: U31.4(WDI) ; also sheet 5
WATCHDOG_OK: D14.C K4.1(COIL+) Q3.3(D) ; also sheet 2
WATCHDOG_OK_LV: D20.3(C) Q4.1(G) R149.2 U31.1(!RESET!)
Unconnected: K1.2 K1.7 K2.2 K2.7 K3.2 K3.7 K4.2 K4.7 K5.2 K5.7

### Notes on the sheet
- SHDN_B is BOTS sense
- to BOTS
- TVS on signals that interface external circuitry

## Sheet 5 of 9
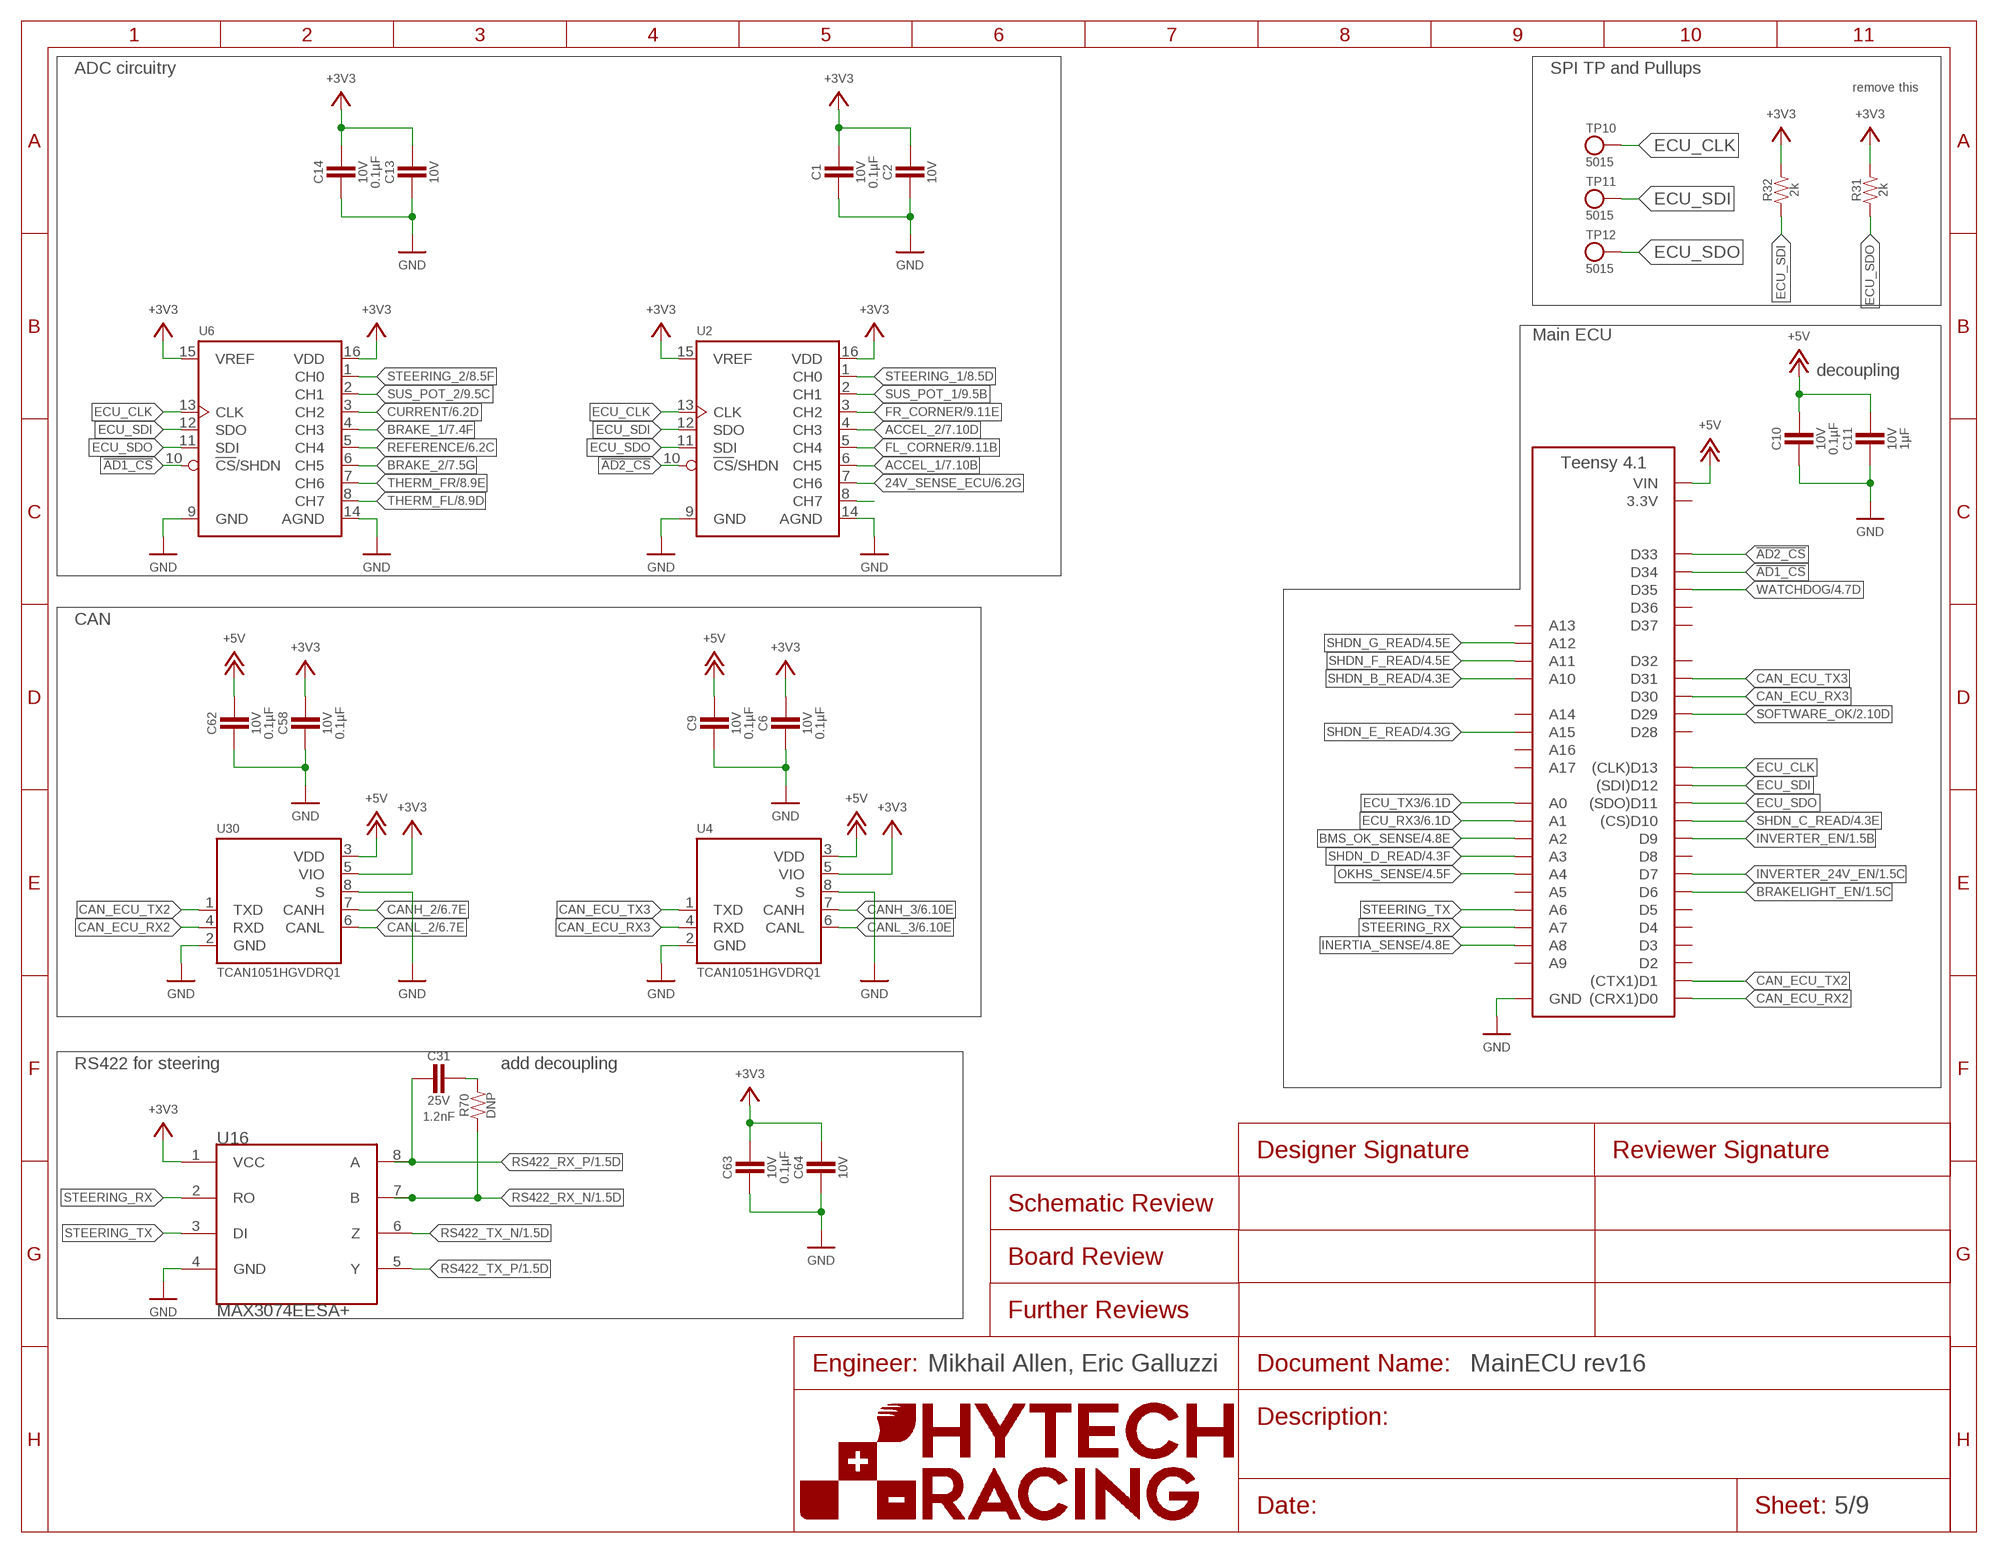
[diagram p4: schematic, sheet 5]
FRAME3 (FRAME): ENGINEER: Mikhail Allen, Eric Galluzzi

### Parts
A2  TEENSY_4.1_SMT  [TEENSY_LONG_SSM]
C1  CAPACITOR_0603_10V_0.1UF  [0603-CAP]
C2  CAPACITOR_0603_10V_1UF  [0603-CAP]
C6  CAPACITOR_0603_10V_0.1UF  [0603-CAP]
C9  CAPACITOR_0603_10V_0.1UF  [0603-CAP]
C10  CAPACITOR_0603_10V_0.1UF  [0603-CAP]
C11  CAPACITOR_0603_10V_1UF  [0603-CAP]
C13  CAPACITOR_0603_10V_1UF  [0603-CAP]
C14  CAPACITOR_0603_10V_0.1UF  [0603-CAP]
C31  CAPACITOR_0603_25V_1.2NF  [0603-CAP]
C58  CAPACITOR_0603_10V_0.1UF  [0603-CAP]
C62  CAPACITOR_0603_10V_0.1UF  [0603-CAP]
C63  CAPACITOR_0603_10V_0.1UF  [0603-CAP]
C64  CAPACITOR_0603_10V_1UF  [0603-CAP]
R31  RESISTOR_0603_2K  [0603-RES]
R32  RESISTOR_0603_2K  [0603-RES]
R70  RESISTOR_0603_DNP  [0603-RES]
TP10  TEST_POINT  [5015]
TP11  TEST_POINT  [5015]
TP12  TEST_POINT  [5015]
U2  MCP3208  [SOIC-16]
U4  TCAN1051HQV-Q1  [SOIC-08(NARROW,0.15")]
U6  MCP3208  [SOIC-16]
U16  MAX3074EESA+  [SOIC-08(NARROW,0.15")]
U30  TCAN1051HQV-Q1  [SOIC-08(NARROW,0.15")]

### Nets
24V_SENSE_ECU: U2.7(CH6) ; also sheet 6
!AD1_CS: A2.D34 U6.10(!CS!/SHDN)
!AD2_CS: A2.D33 U2.10(!CS!/SHDN)
+3V3: C1.1 C2.1 C6.1 C13.1 C14.1 C58.1 C63.1 C64.1 R31.2 R32.2 U2.15(VREF) U2.16(VDD) U4.5(VIO) U6.15(VREF) U6.16(VDD) U16.1(VCC) U30.5(VIO) ; also sheet 2,3,4,6,7,8,9
+5V: A2.VIN C9.1 C10.1 C11.1 C62.1 U4.3(VDD) U30.3(VDD) ; also sheet 1,2,3,6,7
ACCEL_1: U2.6(CH5) ; also sheet 7
ACCEL_2: U2.4(CH3) ; also sheet 7
BMS_OK_SENSE: A2.D16(A2) ; also sheet 4
BRAKE_1: U6.4(CH3) ; also sheet 3,7
BRAKE_2: U6.6(CH5) ; also sheet 7
BRAKELIGHT_EN: A2.D6 ; also sheet 1
CAN_ECU_RX2: A2.D0((CRX1)D0) U30.4(RXD)
CAN_ECU_RX3: A2.D30 U4.4(RXD)
CAN_ECU_TX2: A2.D1((CTX1)D1) U30.1(TXD)
CAN_ECU_TX3: A2.D31 U4.1(TXD)
CANH_2 [diff pairs]: U30.7(CANH) ; also sheet 1,2,6
CANH_3 [diff pairs]: U4.7(CANH) ; also sheet 1,2,6
CANL_2 [diff pairs]: U30.6(CANL) ; also sheet 1,2,6
CANL_3 [diff pairs]: U4.6(CANL) ; also sheet 1,2,6
CURRENT: U6.3(CH2) ; also sheet 3,6,7
ECU_CLK: A2.D13((CLK)D13) TP10.1 U2.13(CLK) U6.13(CLK)
ECU_RX3: A2.D15(A1) ; also sheet 6
ECU_SDI: A2.D12((SDI)D12) R32.1 TP11.1 U2.12(SDO) U6.12(SDO)
ECU_SDO: A2.D11((SDO)D11) R31.1 TP12.1 U2.11(SDI) U6.11(SDI)
ECU_TX3: A2.D14(A0) ; also sheet 6
FL_CORNER: U2.5(CH4) ; also sheet 9
FR_CORNER: U2.3(CH2) ; also sheet 9
GND: A2.AGND/GND(GND) A2.GND A2.GND@1(GND) C1.2 C2.2 C6.2 C9.2 C10.2 C11.2 C13.2 C14.2 C58.2 C62.2 C63.2 C64.2 U2.9(GND) U2.14(AGND) U4.2(GND) U4.8(S) U6.9(GND) U6.14(AGND) U16.4(GND) U30.2(GND) U30.8(S) ; also sheet 1,2,3,4,6,7,8,9
INERTIA_SENSE: A2.D22(A8) ; also sheet 4
INVERTER_24V_EN: A2.D7 ; also sheet 1
INVERTER_EN: A2.D9 ; also sheet 1
N$3: C31.1 R70.2
N$113: U2.8(CH7)
OKHS_SENSE: A2.D18(A4) ; also sheet 4
REFERENCE: U6.5(CH4) ; also sheet 3,6,7
RS422_RX_N [diff pairs]: R70.1 U16.7(B) ; also sheet 1
RS422_RX_P [diff pairs]: C31.2 U16.8(A) ; also sheet 1
RS422_TX_N [diff pairs]: U16.6(Z) ; also sheet 1
RS422_TX_P [diff pairs]: U16.5(Y) ; also sheet 1
SHDN_B_READ: A2.D24(A10) ; also sheet 4
SHDN_C_READ: A2.D10((CS)D10) ; also sheet 4
SHDN_D_READ: A2.D17(A3) ; also sheet 4
SHDN_E_READ: A2.D39(A15) ; also sheet 4
SHDN_F_READ: A2.D25(A11) ; also sheet 4
SHDN_G_READ: A2.D26(A12) ; also sheet 4
SOFTWARE_OK: A2.D29 ; also sheet 2,4
STEERING_1: U2.1(CH0) ; also sheet 8
STEERING_2: U6.1(CH0) ; also sheet 8
STEERING_RX: A2.D21(A7) U16.2(RO)
STEERING_TX: A2.D20(A6) U16.3(DI)
SUS_POT_1: U2.2(CH1) ; also sheet 9
SUS_POT_2: U6.2(CH1) ; also sheet 9
THERM_FL: U6.8(CH7) ; also sheet 1,8
THERM_FR: U6.7(CH6) ; also sheet 1,8
WATCHDOG: A2.D35 ; also sheet 4
Unconnected: A2.D2 A2.D3 A2.D4 A2.D5 A2.D8 A2.D19(A5) A2.D23(A9) A2.D27(A13) A2.D28 A2.D32 A2.D36 A2.D37 A2.D38(A14) A2.D40(A16) A2.D41(A17)

### Notes on the sheet
- ADC circuitry | SPI TP and Pullups
- remove this
- Main ECU
- decoupling
- CAN
- RS422 for steering | add decoupling

## Sheet 6 of 9
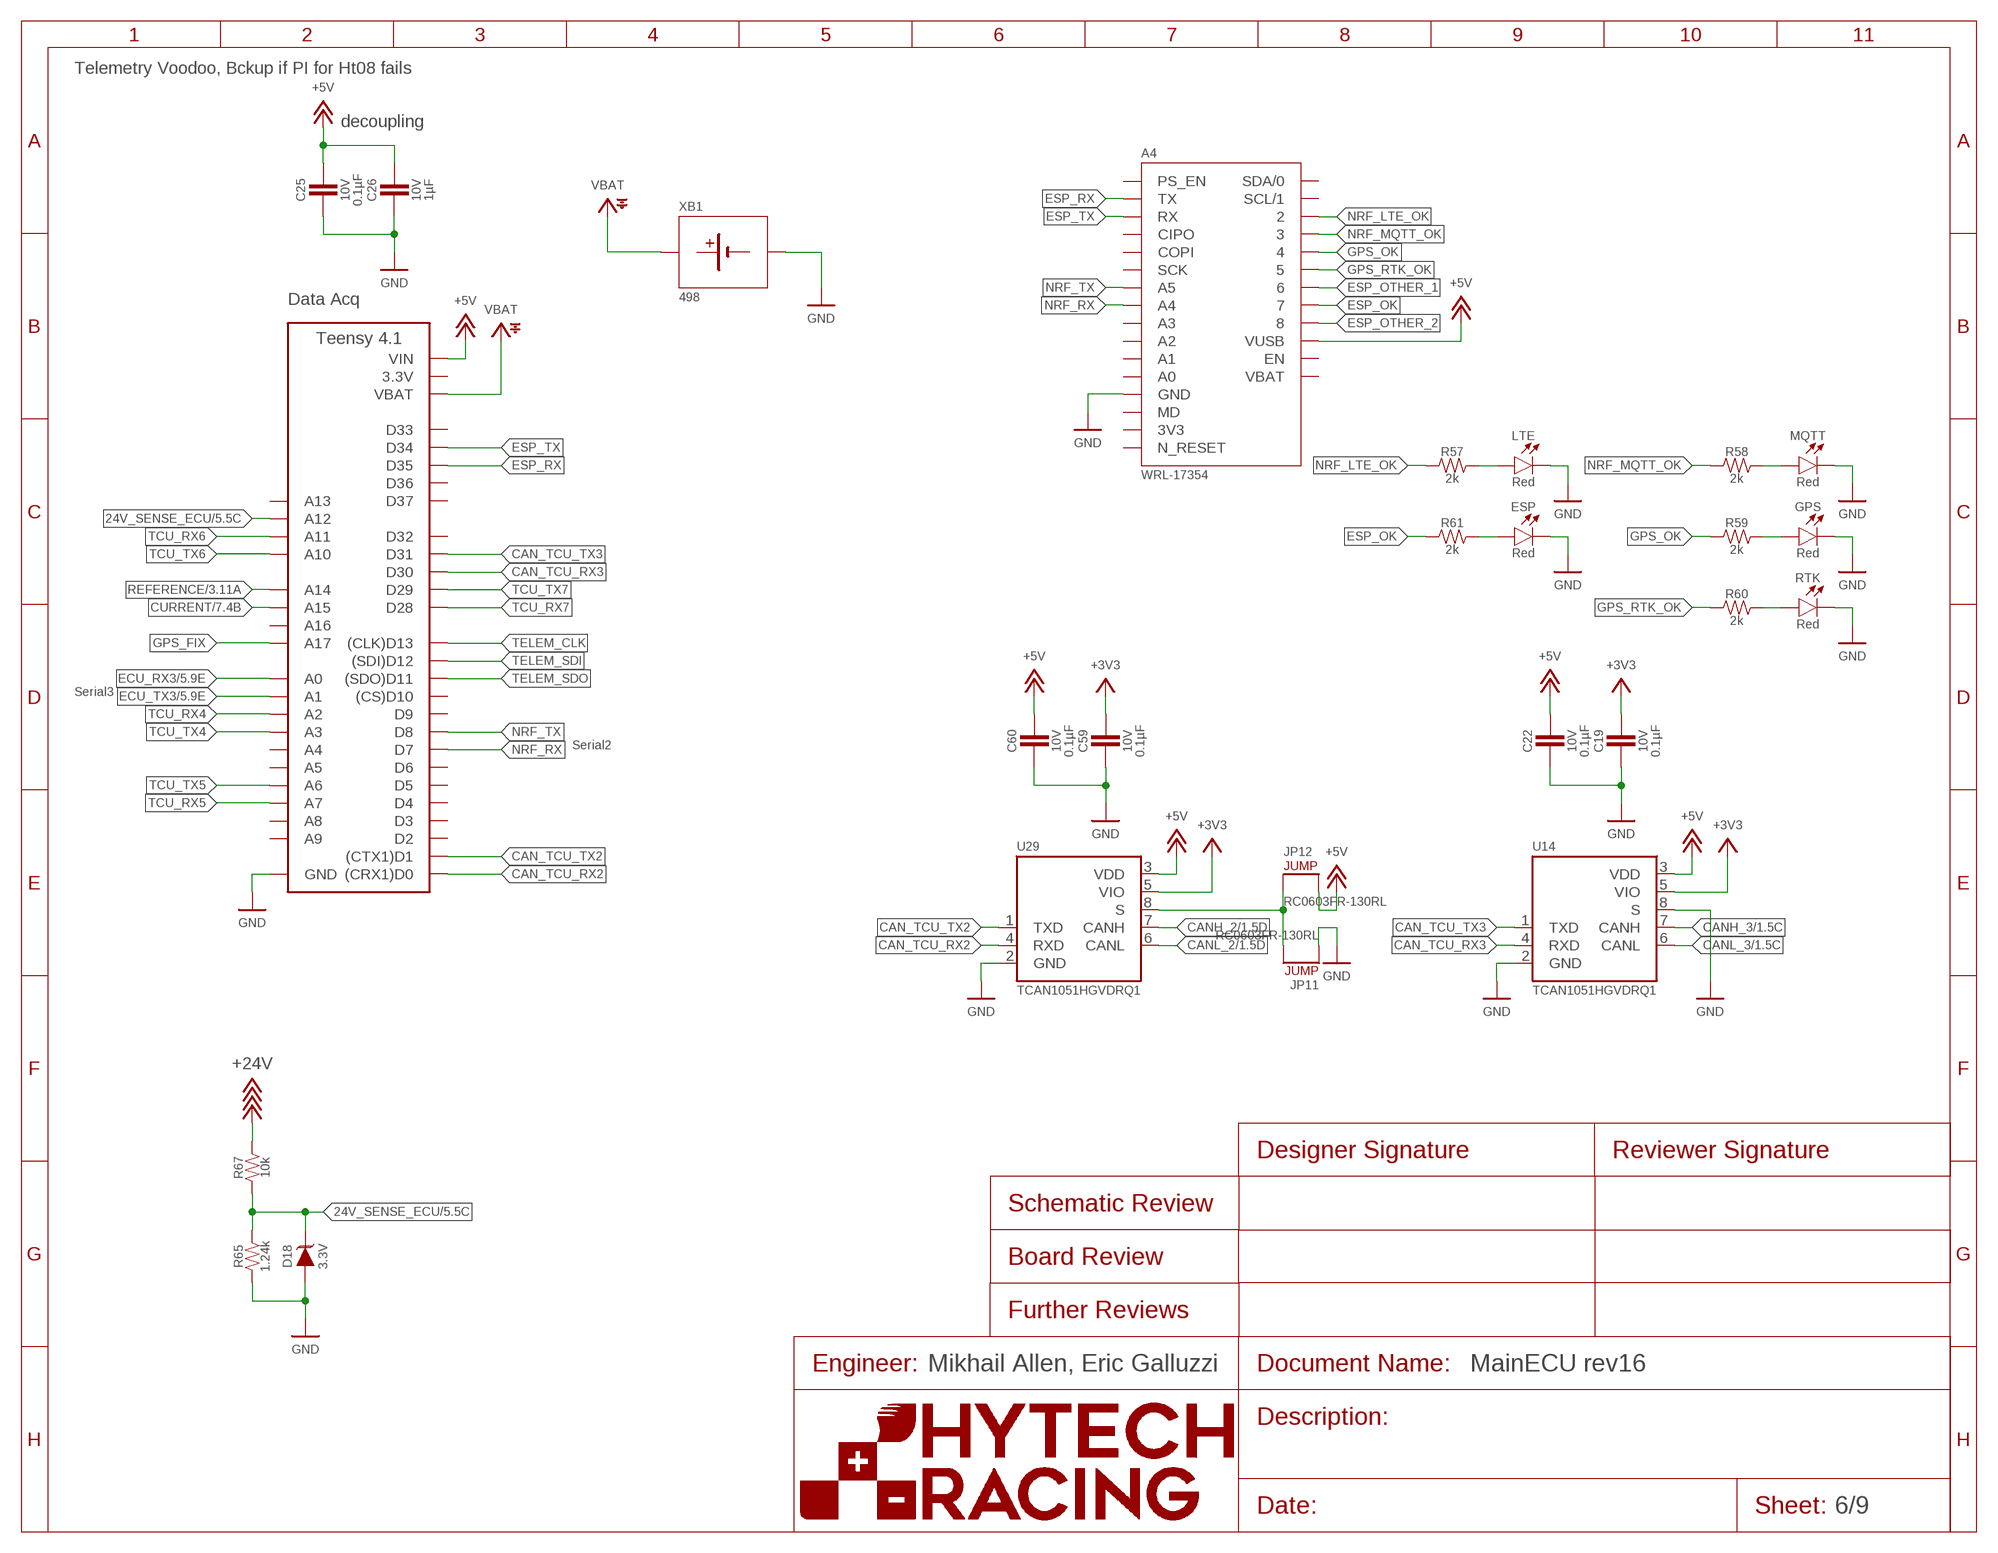
[diagram p5: schematic, sheet 6]
FRAME6 (FRAME): ENGINEER: Mikhail Allen, Eric Galluzzi

### Parts
A3  TEENSY_4.1  [TEENSY_LONG_EXT]
A4  NRF9160LTE  [NRF9160LTE]
C19  CAPACITOR_0603_10V_0.1UF  [0603-CAP]
C22  CAPACITOR_0603_10V_0.1UF  [0603-CAP]
C25  CAPACITOR_0603_10V_0.1UF  [0603-CAP]
C26  CAPACITOR_0603_10V_1UF  [0603-CAP]
C59  CAPACITOR_0603_10V_0.1UF  [0603-CAP]
C60  CAPACITOR_0603_10V_0.1UF  [0603-CAP]
D18  TVS__5V  [SOT-23]
ESP  LED_0603_RED  [0603-LED]
GPS  LED_0603_RED  [0603-LED]
JP11  DNP  JUMPER_0603_  [0603-RES]
JP12  JUMPER_0603_  [0603-RES]
LTE  LED_0603_RED  [0603-LED]
MQTT  LED_0603_RED  [0603-LED]
R57  RESISTOR_0603_2K  [0603-RES]
R58  RESISTOR_0603_2K  [0603-RES]
R59  RESISTOR_0603_2K  [0603-RES]
R60  RESISTOR_0603_2K  [0603-RES]
R61  RESISTOR_0603_2K  [0603-RES]
R65  RESISTOR_0603_1.24K  [0603-RES]
R67  RESISTOR_0603_10K  [0603-RES]
RTK  LED_0603_RED  [0603-LED]
U14  TCAN1051HQV-Q1  [SOIC-08(NARROW,0.15")]
U29  TCAN1051HQV-Q1  [SOIC-08(NARROW,0.15")]
XB1  BATTERY_HOLDER_KEYSTONE_498  [498]

### Nets
24V_SENSE_ECU: A3.D26(A12) D18.3(C) R65.2 R67.1 ; also sheet 5
+3V3: C19.1 C59.1 U14.5(VIO) U29.5(VIO) ; also sheet 2,3,4,5,7,8,9
+5V: A3.VIN A4.VUSB C22.1 C25.1 C26.1 C60.1 JP12.2 U14.3(VDD) U29.3(VDD) ; also sheet 1,2,3,5,7
+24V: R67.2 ; also sheet 2,3,4
CAN_TCU_RX2: A3.D0((CRX1)D0) U29.4(RXD)
CAN_TCU_RX3: A3.D30 U14.4(RXD)
CAN_TCU_TX2: A3.D1((CTX1)D1) U29.1(TXD)
CAN_TCU_TX3: A3.D31 U14.1(TXD)
CANH_2 [diff pairs]: U29.7(CANH) ; also sheet 1,2,5
CANH_3 [diff pairs]: U14.7(CANH) ; also sheet 1,2,5
CANL_2 [diff pairs]: U29.6(CANL) ; also sheet 1,2,5
CANL_3 [diff pairs]: U14.6(CANL) ; also sheet 1,2,5
CURRENT: A3.D39(A15) ; also sheet 3,5,7
ECU_RX3: A3.D14(A0) ; also sheet 5
ECU_TX3: A3.D15(A1) ; also sheet 5
ESP_OK: A4.7 R61.1
ESP_OTHER_1: A4.6
ESP_OTHER_2: A4.8
ESP_RX: A3.D35 A4.TX
ESP_TX: A3.D34 A4.RX
GND: A3.AGND/GND(GND) A3.GND A3.GND@2(GND) A4.GND C19.2 C22.2 C25.2 C26.2 C59.2 C60.2 D18.1(A) ESP.1(C) GPS.1(C) JP11.1 LTE.1(C) MQTT.1(C) R65.1 RTK.1(C) U14.2(GND) U14.8(S) U29.2(GND) XB1.2(MINUS) ; also sheet 1,2,3,4,5,7,8,9
GPS_FIX: A3.D41(A17)
GPS_OK: A4.4 R59.1
GPS_RTK_OK: A4.5 R60.1
N$1: ESP.2(A) R61.2
N$11: JP11.2 JP12.1 U29.8(S)
N$38: LTE.2(A) R57.2
N$52: MQTT.2(A) R58.2
N$57: GPS.2(A) R59.2
N$58: R60.2 RTK.2(A)
NRF_LTE_OK: A4.2 R57.1
NRF_MQTT_OK: A4.3 R58.1
NRF_RX: A3.D7 A4.A4
NRF_TX: A3.D8 A4.A5
REFERENCE: A3.D38(A14) ; also sheet 3,5,7
TCU_RX4: A3.D16(A2)
TCU_RX5: A3.D21(A7)
TCU_RX6: A3.D25(A11)
TCU_RX7: A3.D28
TCU_TX4: A3.D17(A3)
TCU_TX5: A3.D20(A6)
TCU_TX6: A3.D24(A10)
TCU_TX7: A3.D29
TELEM_CLK: A3.D13((CLK)D13)
TELEM_SDI: A3.D12((SDI)D12)
TELEM_SDO: A3.D11((SDO)D11)
VBAT: A3.VBAT XB1.1(PLUS)
Unconnected: A3.D2 A3.D3 A3.D4 A3.D5 A3.D6 A3.D9 A3.D10((CS)D10) A3.D18(A4) A3.D19(A5) A3.D22(A8) A3.D23(A9) A3.D27(A13) A3.D32 A3.D33 A3.D36 A3.D37 A3.D40(A16) A4.A0 A4.A1 A4.A2 A4.A3 A4.CIPO A4.COPI A4.EN A4.MD A4.PS-EN(PS_EN) A4.RESET(N_RESET) A4.SCK A4.SCL/1 A4.SDA/0

### Notes on the sheet
- Telemetry Voodoo, Bckup if PI for Ht08 fails
- decoupling
- Data Acq
- Serial3
- Serial2

## Sheet 7 of 9
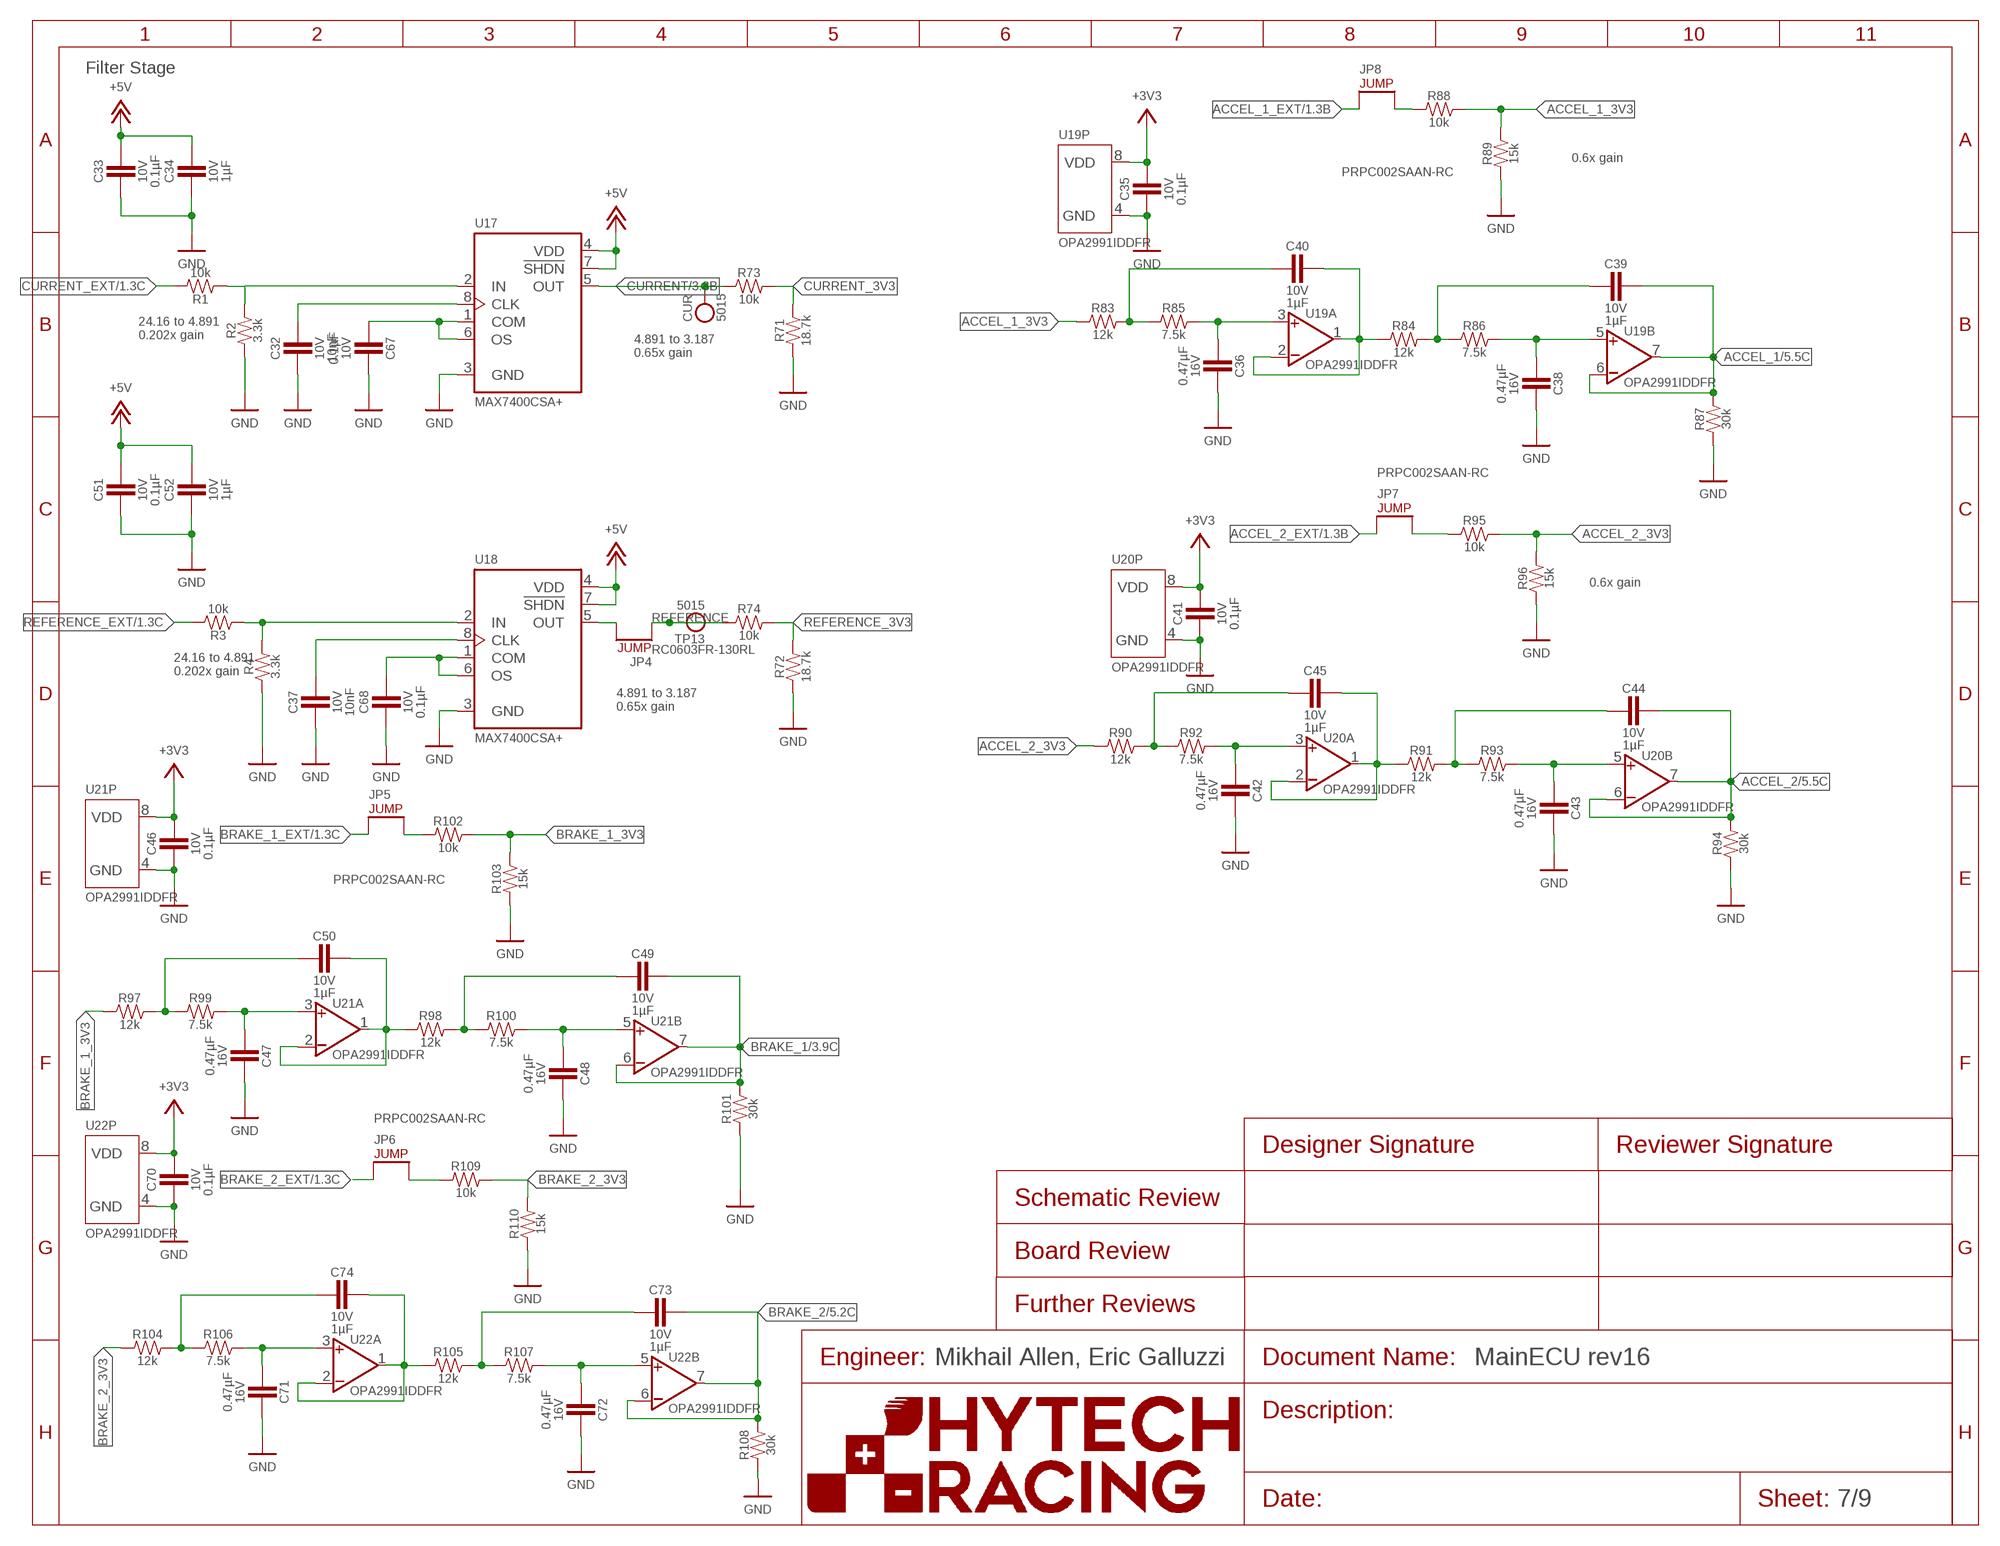
[diagram p6: schematic, sheet 7]
FRAME4 (FRAME): ENGINEER: Mikhail Allen, Eric Galluzzi

### Parts
C32  CAPACITOR_0603_10V_10NF  [0603-CAP]
C33  CAPACITOR_0603_10V_0.1UF  [0603-CAP]
C34  CAPACITOR_0603_10V_1UF  [0603-CAP]
C35  CAPACITOR_0603_10V_0.1UF  [0603-CAP]
C36  CAPACITOR_0603_16V_0.47UF  [0603-CAP]
C37  CAPACITOR_0603_10V_10NF  [0603-CAP]
C38  CAPACITOR_0603_16V_0.47UF  [0603-CAP]
C39  CAPACITOR_0603_10V_1UF  [0603-CAP]
C40  CAPACITOR_0603_10V_1UF  [0603-CAP]
C41  CAPACITOR_0603_10V_0.1UF  [0603-CAP]
C42  CAPACITOR_0603_16V_0.47UF  [0603-CAP]
C43  CAPACITOR_0603_16V_0.47UF  [0603-CAP]
C44  CAPACITOR_0603_10V_1UF  [0603-CAP]
C45  CAPACITOR_0603_10V_1UF  [0603-CAP]
C46  CAPACITOR_0603_10V_0.1UF  [0603-CAP]
C47  CAPACITOR_0603_16V_0.47UF  [0603-CAP]
C48  CAPACITOR_0603_16V_0.47UF  [0603-CAP]
C49  CAPACITOR_0603_10V_1UF  [0603-CAP]
C50  CAPACITOR_0603_10V_1UF  [0603-CAP]
C51  CAPACITOR_0603_10V_0.1UF  [0603-CAP]
C52  CAPACITOR_0603_10V_1UF  [0603-CAP]
C67  CAPACITOR_0603_10V_0.1UF  [0603-CAP]
C68  CAPACITOR_0603_10V_0.1UF  [0603-CAP]
C70  CAPACITOR_0603_10V_0.1UF  [0603-CAP]
C71  CAPACITOR_0603_16V_0.47UF  [0603-CAP]
C72  CAPACITOR_0603_16V_0.47UF  [0603-CAP]
C73  CAPACITOR_0603_10V_1UF  [0603-CAP]
C74  CAPACITOR_0603_10V_1UF  [0603-CAP]
CUR  TEST_POINT  [5015]
JP4  JUMPER_0603_  [0603-RES]
JP5  JUMPER__1X02  [1X02]
JP6  JUMPER__1X02  [1X02]
JP7  JUMPER__1X02  [1X02]
JP8  JUMPER__1X02  [1X02]
R1  RESISTOR_0603_10K  [0603-RES]
R2  RESISTOR_0603_3.3K  [0603-RES]
R3  RESISTOR_0603_10K  [0603-RES]
R4  RESISTOR_0603_3.3K  [0603-RES]
R71  RESISTOR_0603_18.7K  [0603-RES]
R72  RESISTOR_0603_18.7K  [0603-RES]
R73  RESISTOR_0603_10K  [0603-RES]
R74  RESISTOR_0603_10K  [0603-RES]
R83  RESISTOR_0603_12K  [0603-RES]
R84  RESISTOR_0603_12K  [0603-RES]
R85  RESISTOR_0603_7.5K  [0603-RES]
R86  RESISTOR_0603_7.5K  [0603-RES]
R87  RESISTOR_0603_30K  [0603-RES]
R88  RESISTOR_0603_10K  [0603-RES]
R89  RESISTOR_0603_15K  [0603-RES]
R90  RESISTOR_0603_12K  [0603-RES]
R91  RESISTOR_0603_12K  [0603-RES]
R92  RESISTOR_0603_7.5K  [0603-RES]
R93  RESISTOR_0603_7.5K  [0603-RES]
R94  RESISTOR_0603_30K  [0603-RES]
R95  RESISTOR_0603_10K  [0603-RES]
R96  RESISTOR_0603_15K  [0603-RES]
R97  RESISTOR_0603_12K  [0603-RES]
R98  RESISTOR_0603_12K  [0603-RES]
R99  RESISTOR_0603_7.5K  [0603-RES]
R100  RESISTOR_0603_7.5K  [0603-RES]
R101  RESISTOR_0603_30K  [0603-RES]
R102  RESISTOR_0603_10K  [0603-RES]
R103  RESISTOR_0603_15K  [0603-RES]
R104  RESISTOR_0603_12K  [0603-RES]
R105  RESISTOR_0603_12K  [0603-RES]
R106  RESISTOR_0603_7.5K  [0603-RES]
R107  RESISTOR_0603_7.5K  [0603-RES]
R108  RESISTOR_0603_30K  [0603-RES]
R109  RESISTOR_0603_10K  [0603-RES]
R110  RESISTOR_0603_15K  [0603-RES]
TP13  TEST_POINT  [5015]
U17  MAX7400  [SOIC-08(NARROW,0.15")]
U18  MAX7400  [SOIC-08(NARROW,0.15")]
U19  OPAMP_2_CHANNEL_OPA_2991  [SOT-23-8]
U20  OPAMP_2_CHANNEL_OPA_2991  [SOT-23-8]
U21  OPAMP_2_CHANNEL_OPA_2991  [SOT-23-8]
U22  OPAMP_2_CHANNEL_OPA_2991  [SOT-23-8]

### Nets
+3V3: C35.1 C41.1 C46.1 C70.1 U19.8(P:VDD) U20.8(P:VDD) U21.8(P:VDD) U22.8(P:VDD) ; also sheet 2,3,4,5,6,8,9
+5V: C33.1 C34.1 C51.1 C52.1 U17.4(VDD) U17.7(!SHDN) U18.4(VDD) U18.7(!SHDN) ; also sheet 1,2,3,5,6
ACCEL_1: C39.1 R87.2 U19.6(B:VIN-) U19.7(B:VOUT) ; also sheet 5
ACCEL_1_3V3: R83.1 R88.2 R89.2
ACCEL_1_EXT: JP8.1 ; also sheet 1
ACCEL_2: C44.1 R94.2 U20.6(B:VIN-) U20.7(B:VOUT) ; also sheet 5
ACCEL_2_3V3: R90.1 R95.2 R96.2
ACCEL_2_EXT: JP7.1 ; also sheet 1
BRAKE_1: C49.1 R101.2 U21.6(B:VIN-) U21.7(B:VOUT) ; also sheet 3,5
BRAKE_1_3V3: R97.1 R102.2 R103.2
BRAKE_1_EXT: JP5.1 ; also sheet 1
BRAKE_2: C73.1 R108.2 U22.6(B:VIN-) U22.7(B:VOUT) ; also sheet 5
BRAKE_2_3V3: R104.1 R109.2 R110.2
BRAKE_2_EXT: JP6.1 ; also sheet 1
CURRENT: CUR.1 R73.1 U17.5(OUT) ; also sheet 3,5,6
CURRENT_3V3: R71.2 R73.2
CURRENT_EXT: R1.2 ; also sheet 1
CURRENT_PRE: R1.1 R2.2 U17.2(IN)
GND: C32.2 C33.2 C34.2 C35.2 C36.1 C37.2 C38.1 C41.2 C42.1 C43.1 C46.2 C47.1 C48.1 C51.2 C52.2 C67.1 C68.2 C70.2 C71.1 C72.1 R2.1 R4.1 R71.1 R72.1 R87.1 R89.1 R94.1 R96.1 R101.1 R103.1 R108.1 R110.1 U17.3(GND) U18.3(GND) U19.4(P:GND) U20.4(P:GND) U21.4(P:GND) U22.4(P:GND) ; also sheet 1,2,3,4,5,6,8,9
N$14: C40.2 R83.2 R85.1
N$27: C36.2 R85.2 U19.3(A:VIN+)
N$31: C39.2 R84.2 R86.1
N$33: C40.1 R84.1 U19.1(A:VOUT) U19.2(A:VIN-)
N$34: C38.2 R86.2 U19.5(B:VIN+)
N$35: C43.2 R93.2 U20.5(B:VIN+)
N$50: JP4.2 U18.5(OUT)
N$54: C42.2 R92.2 U20.3(A:VIN+)
N$60: C37.1 U18.8(CLK)
N$61: C45.1 R91.1 U20.1(A:VOUT) U20.2(A:VIN-)
N$64: C44.2 R91.2 R93.1
N$72: C45.2 R90.2 R92.1
N$77: C50.2 R97.2 R99.1
N$78: C68.1 U18.1(COM) U18.6(OS)
N$79: C32.1 U17.8(CLK)
N$80: C47.2 R99.2 U21.3(A:VIN+)
N$81: C67.2 U17.1(COM) U17.6(OS)
N$82: C50.1 R98.1 U21.1(A:VOUT) U21.2(A:VIN-)
N$83: C49.2 R98.2 R100.1
N$84: C48.2 R100.2 U21.5(B:VIN+)
N$88: C74.2 R104.2 R106.1
N$89: C71.2 R106.2 U22.3(A:VIN+)
N$90: C74.1 R105.1 U22.1(A:VOUT) U22.2(A:VIN-)
N$91: C73.2 R105.2 R107.1
N$92: C72.2 R107.2 U22.5(B:VIN+)
N$103: JP5.2 R102.1
N$104: JP8.2 R88.1
N$105: JP7.2 R95.1
N$106: JP6.2 R109.1
REFERENCE: JP4.1 R74.1 TP13.1 ; also sheet 3,5,6
REFERENCE_3V3: R72.2 R74.2
REFERENCE_EXT: R3.2 ; also sheet 1
REFERNECE_PRE: R3.1 R4.2 U18.2(IN)

### Notes on the sheet
- Filter Stage
- 0.6x gain
- 24.16 to 4.891
  0.202x gain
- 4.891 to 3.187
  0.65x gain
- 0.6x gain
- 24.16 to 4.891
  0.202x gain
- 4.891 to 3.187
  0.65x gain

## Sheet 8 of 9
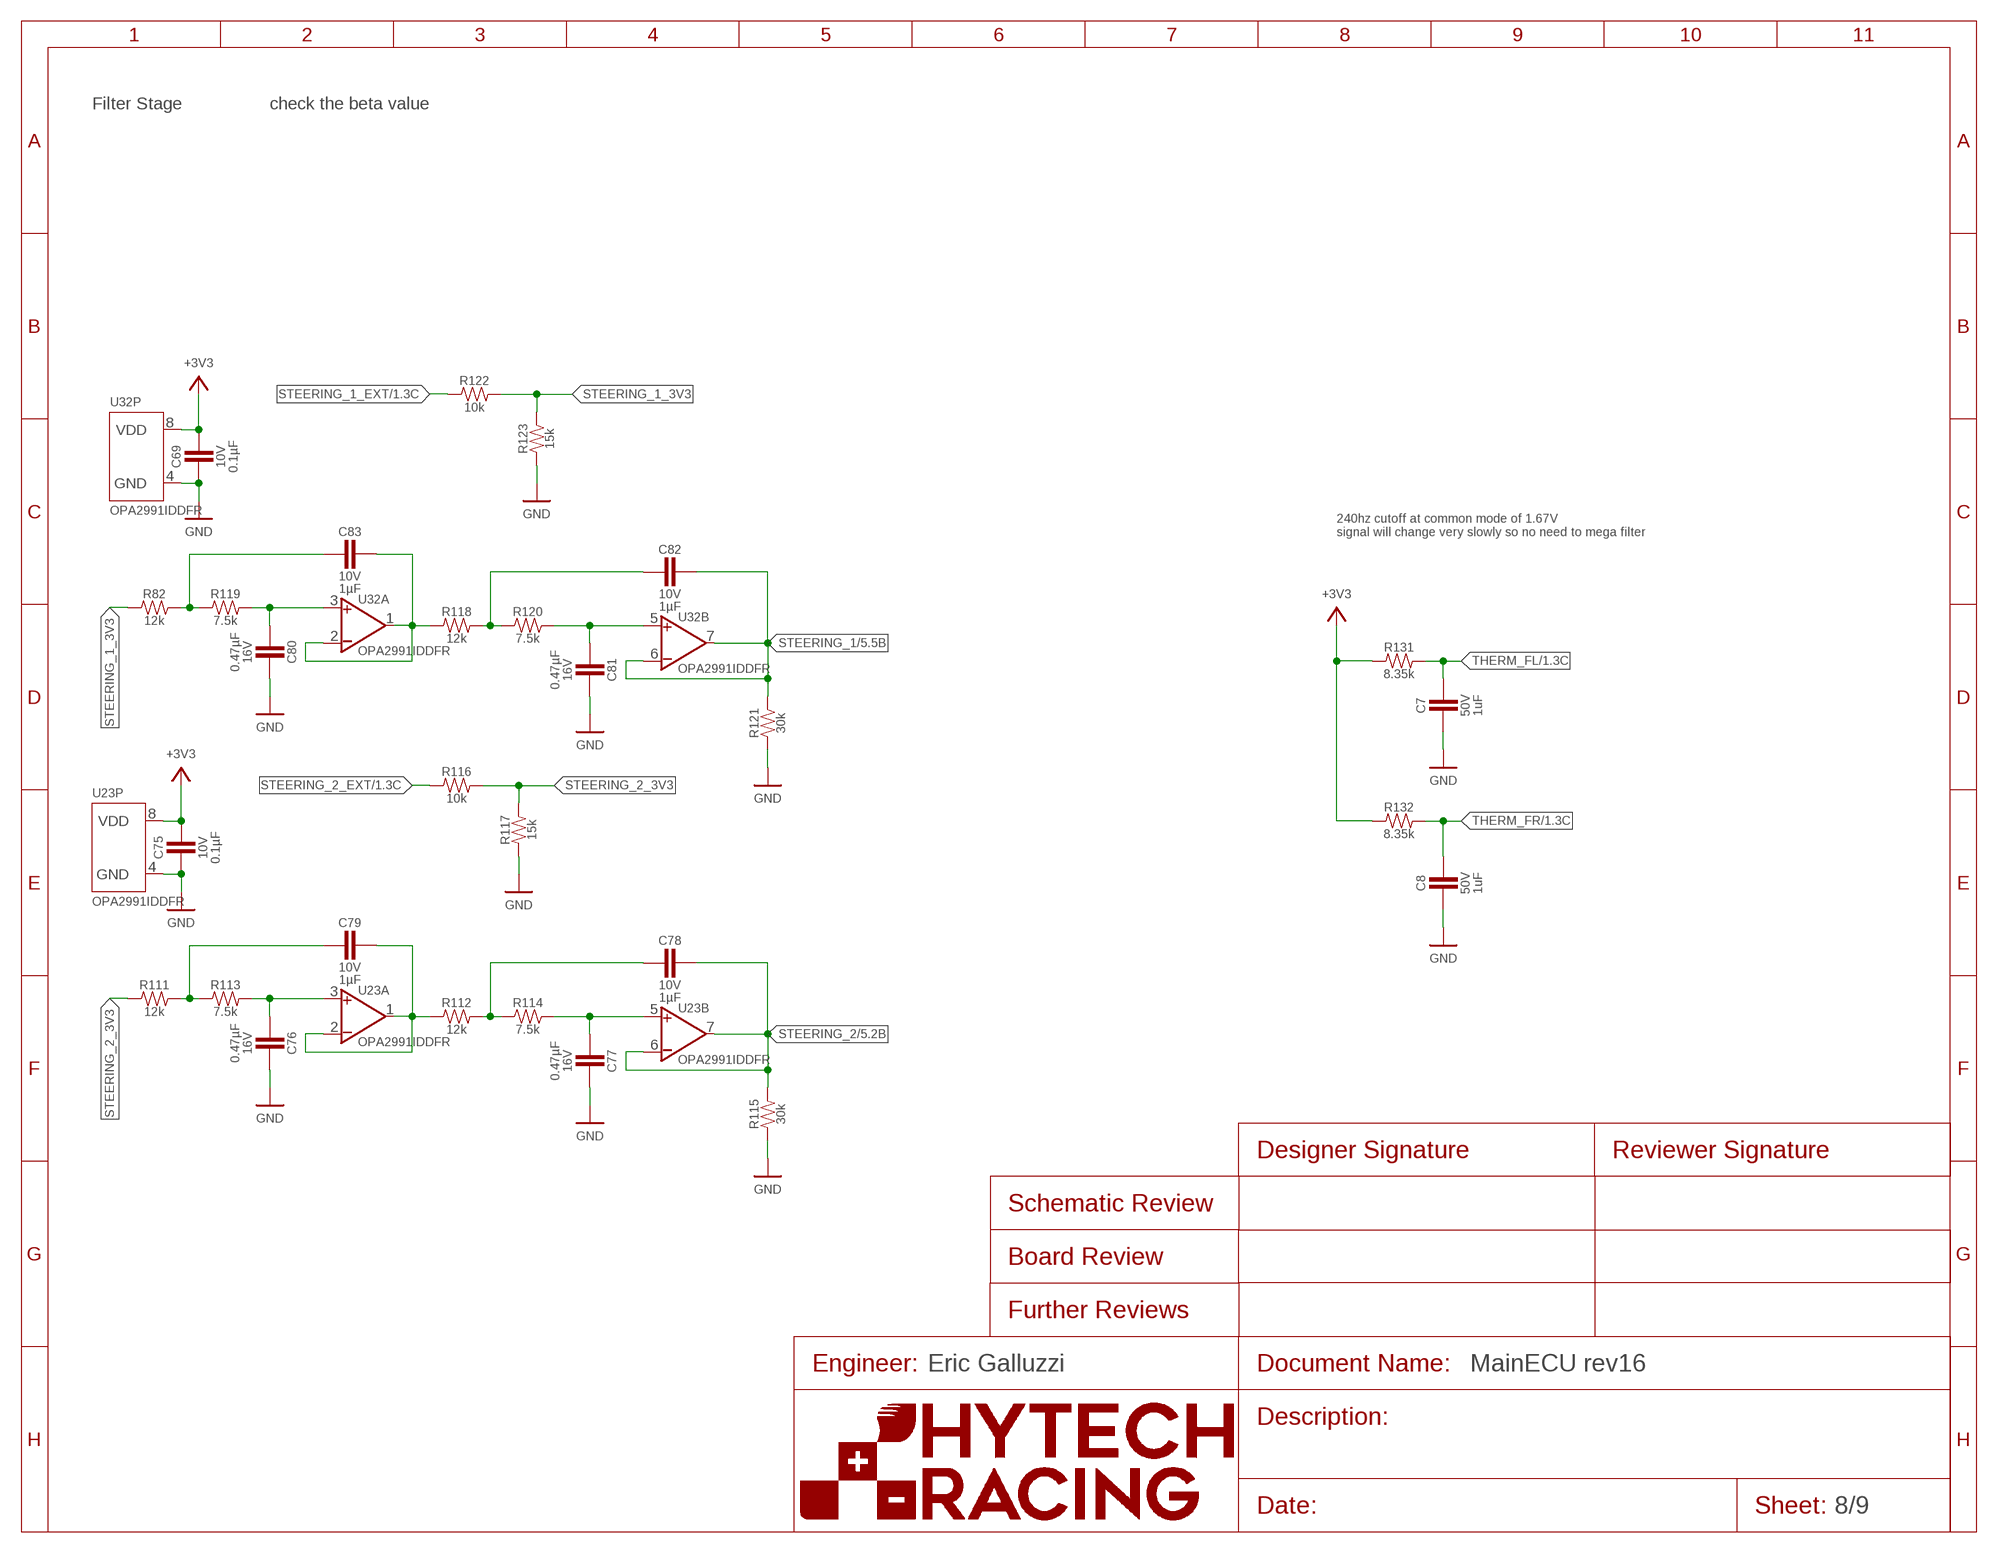
[diagram p7: schematic, sheet 8]
FRAME5 (FRAME): ENGINEER: Eric Galluzzi

### Parts
C7  CAPACITOR_0603_50V_1UF  [0603-CAP]
C8  CAPACITOR_0603_50V_1UF  [0603-CAP]
C69  CAPACITOR_0603_10V_0.1UF  [0603-CAP]
C75  CAPACITOR_0603_10V_0.1UF  [0603-CAP]
C76  CAPACITOR_0603_16V_0.47UF  [0603-CAP]
C77  CAPACITOR_0603_16V_0.47UF  [0603-CAP]
C78  CAPACITOR_0603_10V_1UF  [0603-CAP]
C79  CAPACITOR_0603_10V_1UF  [0603-CAP]
C80  CAPACITOR_0603_16V_0.47UF  [0603-CAP]
C81  CAPACITOR_0603_16V_0.47UF  [0603-CAP]
C82  CAPACITOR_0603_10V_1UF  [0603-CAP]
C83  CAPACITOR_0603_10V_1UF  [0603-CAP]
R82  RESISTOR_0603_12K  [0603-RES]
R111  RESISTOR_0603_12K  [0603-RES]
R112  RESISTOR_0603_12K  [0603-RES]
R113  RESISTOR_0603_7.5K  [0603-RES]
R114  RESISTOR_0603_7.5K  [0603-RES]
R115  RESISTOR_0603_30K  [0603-RES]
R116  RESISTOR_0603_10K  [0603-RES]
R117  RESISTOR_0603_15K  [0603-RES]
R118  RESISTOR_0603_12K  [0603-RES]
R119  RESISTOR_0603_7.5K  [0603-RES]
R120  RESISTOR_0603_7.5K  [0603-RES]
R121  RESISTOR_0603_30K  [0603-RES]
R122  RESISTOR_0603_10K  [0603-RES]
R123  RESISTOR_0603_15K  [0603-RES]
R131  RESISTOR_0603_8.35K  [0603-RES]
R132  RESISTOR_0603_8.35K  [0603-RES]
U23  OPAMP_2_CHANNEL_OPA_2991  [SOT-23-8]
U32  OPAMP_2_CHANNEL_OPA_2991  [SOT-23-8]

### Nets
+3V3: C69.1 C75.1 R131.1 R132.1 U23.8(P:VDD) U32.8(P:VDD) ; also sheet 2,3,4,5,6,7,9
GND: C7.2 C8.2 C69.2 C75.2 C76.1 C77.1 C80.1 C81.1 R115.1 R117.1 R121.1 R123.1 U23.4(P:GND) U32.4(P:GND) ; also sheet 1,2,3,4,5,6,7,9
N$86: C83.2 R82.2 R119.1
N$87: C80.2 R119.2 U32.3(A:VIN+)
N$93: C83.1 R118.1 U32.1(A:VOUT) U32.2(A:VIN-)
N$94: C82.2 R118.2 R120.1
N$95: C81.2 R120.2 U32.5(B:VIN+)
N$96: C79.2 R111.2 R113.1
N$97: C76.2 R113.2 U23.3(A:VIN+)
N$98: C79.1 R112.1 U23.1(A:VOUT) U23.2(A:VIN-)
N$99: C78.2 R112.2 R114.1
N$100: C77.2 R114.2 U23.5(B:VIN+)
STEERING_1: C82.1 R121.2 U32.6(B:VIN-) U32.7(B:VOUT) ; also sheet 5
STEERING_1_3V3: R82.1 R122.2 R123.2
STEERING_1_EXT: R122.1 ; also sheet 1
STEERING_2: C78.1 R115.2 U23.6(B:VIN-) U23.7(B:VOUT) ; also sheet 5
STEERING_2_3V3: R111.1 R116.2 R117.2
STEERING_2_EXT: R116.1 ; also sheet 1
THERM_FL: C7.1 R131.2 ; also sheet 1,5
THERM_FR: C8.1 R132.2 ; also sheet 1,5

### Notes on the sheet
- Filter Stage | check the beta value
- 240hz cutoff at common mode of 1.67V
  signal will change very slowly so no need to mega filter

## Sheet 9 of 9
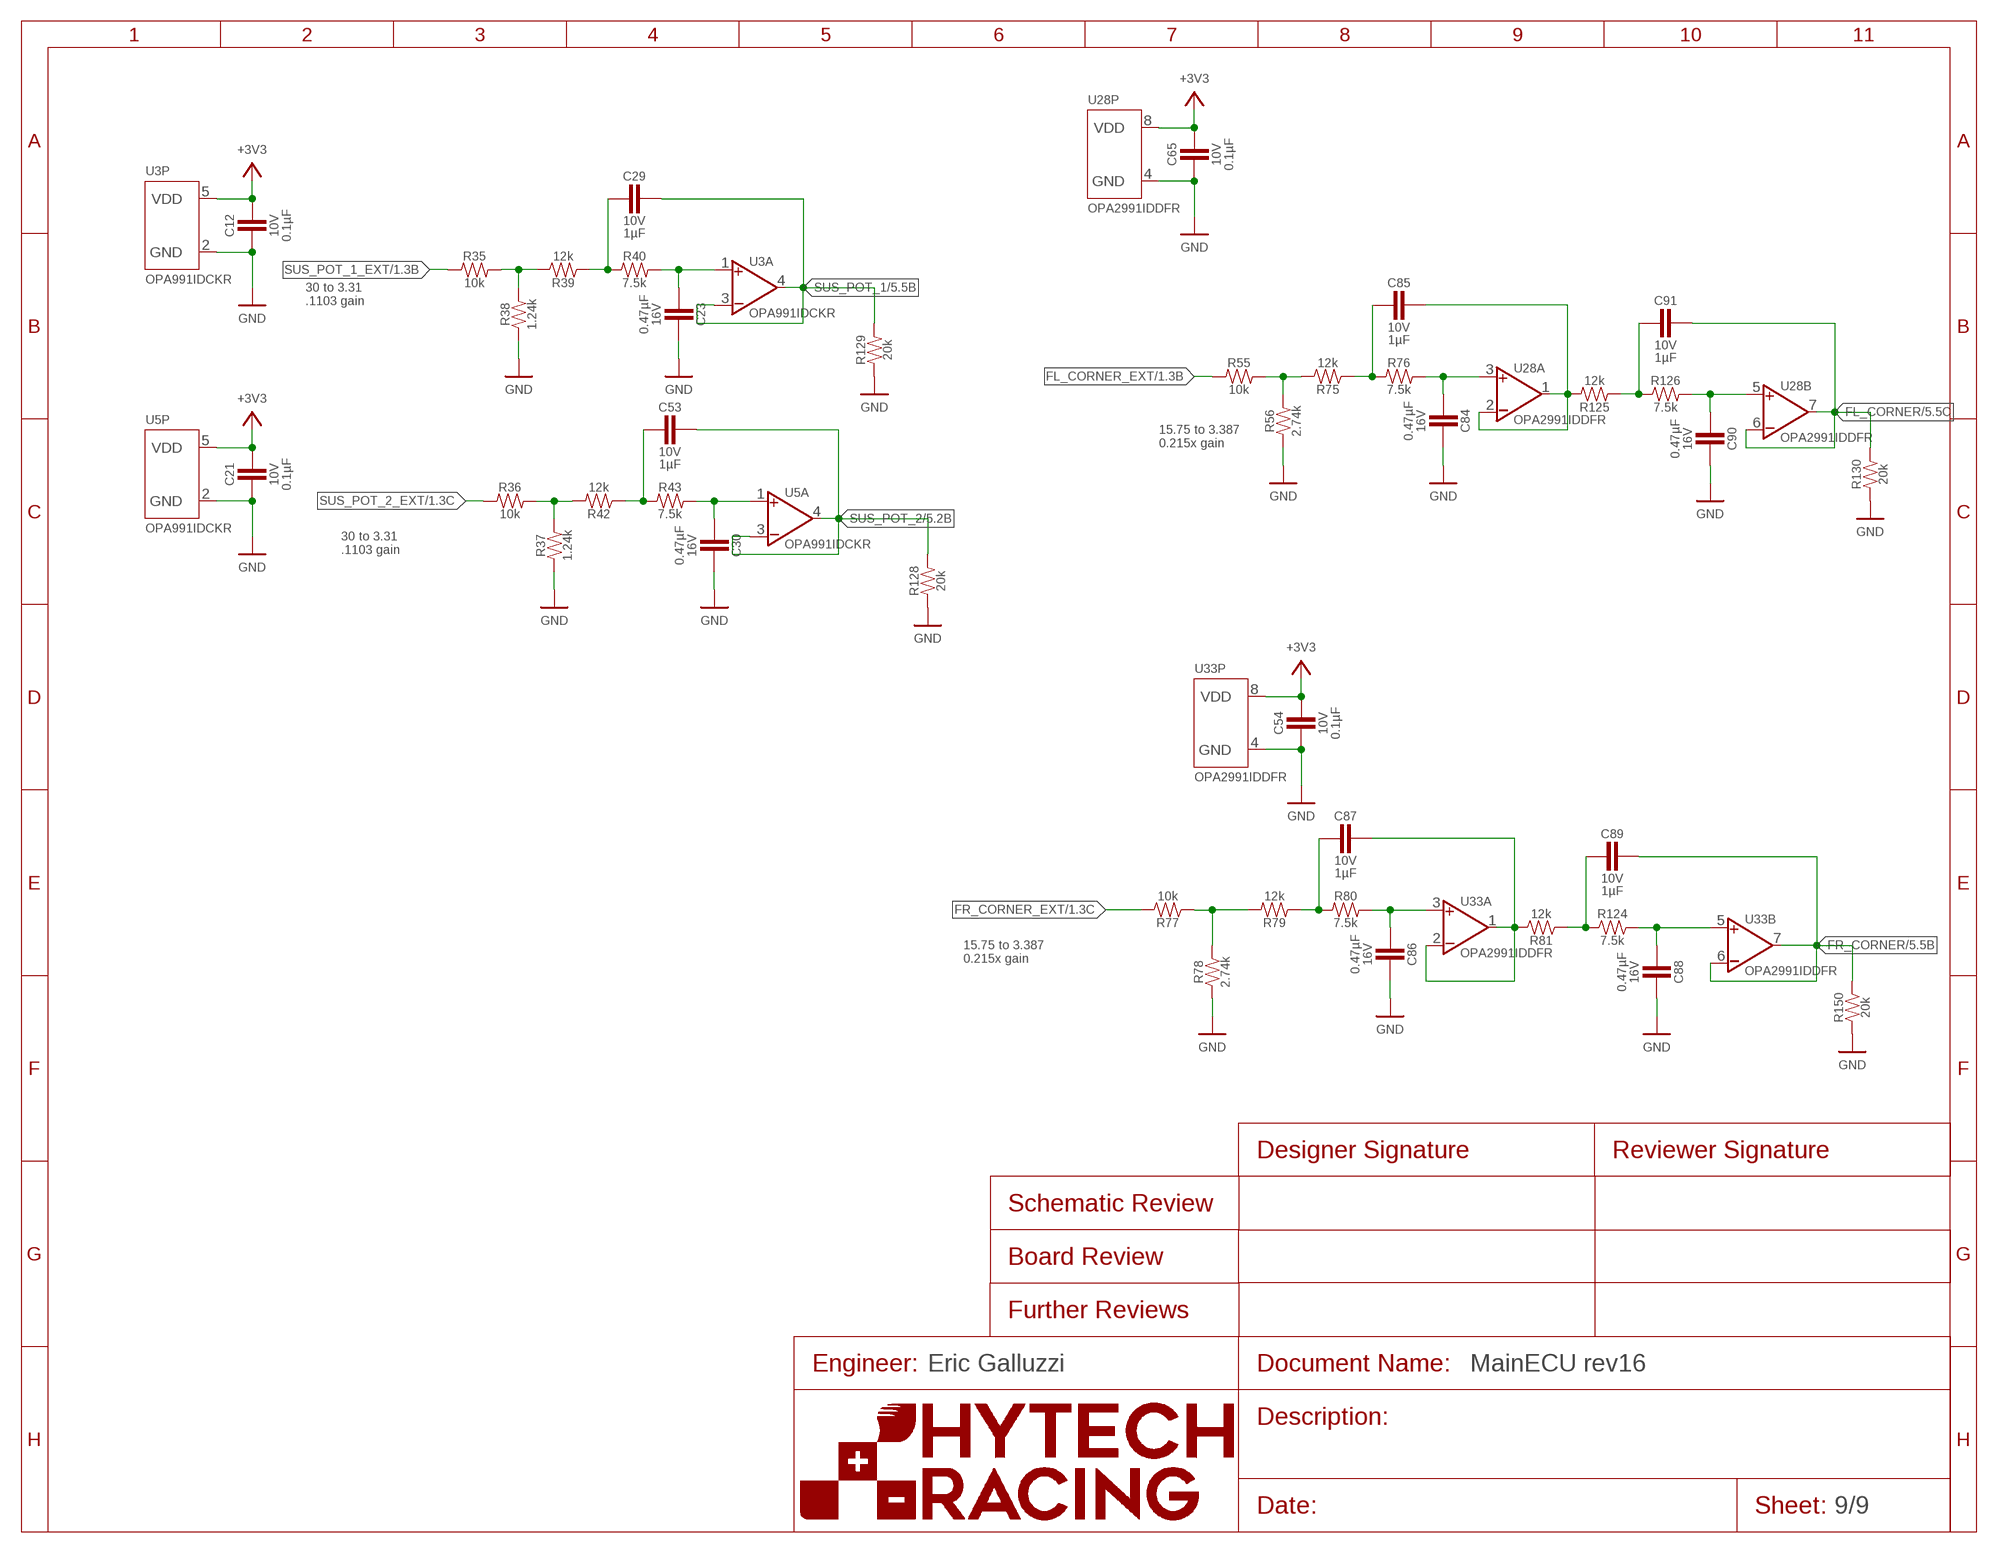
[diagram p8: schematic, sheet 9]
FRAME9 (FRAME): ENGINEER: Eric Galluzzi

### Parts
C12  CAPACITOR_0603_10V_0.1UF  [0603-CAP]
C21  CAPACITOR_0603_10V_0.1UF  [0603-CAP]
C23  CAPACITOR_0603_16V_0.47UF  [0603-CAP]
C29  CAPACITOR_0603_10V_1UF  [0603-CAP]
C30  CAPACITOR_0603_16V_0.47UF  [0603-CAP]
C53  CAPACITOR_0603_10V_1UF  [0603-CAP]
C54  CAPACITOR_0603_10V_0.1UF  [0603-CAP]
C65  CAPACITOR_0603_10V_0.1UF  [0603-CAP]
C84  CAPACITOR_0603_16V_0.47UF  [0603-CAP]
C85  CAPACITOR_0603_10V_1UF  [0603-CAP]
C86  CAPACITOR_0603_16V_0.47UF  [0603-CAP]
C87  CAPACITOR_0603_10V_1UF  [0603-CAP]
C88  CAPACITOR_0603_16V_0.47UF  [0603-CAP]
C89  CAPACITOR_0603_10V_1UF  [0603-CAP]
C90  CAPACITOR_0603_16V_0.47UF  [0603-CAP]
C91  CAPACITOR_0603_10V_1UF  [0603-CAP]
R35  RESISTOR_0603_10K  [0603-RES]
R36  RESISTOR_0603_10K  [0603-RES]
R37  RESISTOR_0603_1.24K  [0603-RES]
R38  RESISTOR_0603_1.24K  [0603-RES]
R39  RESISTOR_0603_12K  [0603-RES]
R40  RESISTOR_0603_7.5K  [0603-RES]
R42  RESISTOR_0603_12K  [0603-RES]
R43  RESISTOR_0603_7.5K  [0603-RES]
R55  RESISTOR_0603_10K  [0603-RES]
R56  RESISTOR_0603_2.74K  [0603-RES]
R75  RESISTOR_0603_12K  [0603-RES]
R76  RESISTOR_0603_7.5K  [0603-RES]
R77  RESISTOR_0603_10K  [0603-RES]
R78  RESISTOR_0603_2.74K  [0603-RES]
R79  RESISTOR_0603_12K  [0603-RES]
R80  RESISTOR_0603_7.5K  [0603-RES]
R81  RESISTOR_0603_12K  [0603-RES]
R124  RESISTOR_0603_7.5K  [0603-RES]
R125  RESISTOR_0603_12K  [0603-RES]
R126  RESISTOR_0603_7.5K  [0603-RES]
R128  RESISTOR_0603_20K  [0603-RES]
R129  RESISTOR_0603_20K  [0603-RES]
R130  RESISTOR_0603_20K  [0603-RES]
R150  RESISTOR_0603_20K  [0603-RES]
U3  OPAMP_1_CHANNEL_OPA991  [SC-70-5]
U5  OPAMP_1_CHANNEL_OPA991  [SC-70-5]
U28  OPAMP_2_CHANNEL_OPA_2991  [SOT-23-8]
U33  OPAMP_2_CHANNEL_OPA_2991  [SOT-23-8]

### Nets
+3V3: C12.1 C21.1 C54.1 C65.1 U3.5(P:VDD) U5.5(P:VDD) U28.8(P:VDD) U33.8(P:VDD) ; also sheet 2,3,4,5,6,7,8
FL_CORNER: C91.1 R130.2 U28.6(B:VIN-) U28.7(B:VOUT) ; also sheet 5
FL_CORNER_EXT [diff pairs]: R55.1 ; also sheet 1
FL_CORNER_PRE: R55.2 R56.2 R75.2
FR_CORNER: C89.1 R150.2 U33.6(B:VIN-) U33.7(B:VOUT) ; also sheet 5
FR_CORNER_EXT: R77.2 ; also sheet 1
FR_CORNER_PRE: R77.1 R78.2 R79.2
FR_CORNER_STAGE1: C87.1 R81.2 U33.1(A:VOUT) U33.2(A:VIN-)
GND: C12.2 C21.2 C23.1 C30.1 C54.2 C65.2 C84.1 C86.1 C88.1 C90.1 R37.1 R38.1 R56.1 R78.1 R128.1 R129.1 R130.1 R150.1 U3.2(P:GND) U5.2(P:GND) U28.4(P:GND) U33.4(P:GND) ; also sheet 1,2,3,4,5,6,7,8
N$12: C84.2 R76.2 U28.3(A:VIN+)
N$32: C85.2 R75.1 R76.1
N$49: C23.2 R40.2 U3.1(A:VIN+)
N$51: C29.2 R39.1 R40.1
N$53: R35.2 R38.2 R39.2
N$59: C86.2 R80.2 U33.3(A:VIN+)
N$62: C30.2 R43.2 U5.1(A:VIN+)
N$63: C53.2 R42.1 R43.1
N$66: R36.2 R37.2 R42.2
N$69: C87.2 R79.1 R80.1
N$70: C88.2 R124.2 U33.5(B:VIN+)
N$71: C89.2 R81.1 R124.1
N$76: C90.2 R126.2 U28.5(B:VIN+)
N$85: C91.2 R125.1 R126.1
N$101: C85.1 R125.2 U28.1(A:VOUT) U28.2(A:VIN-)
SUS_POT_1: C29.1 R129.2 U3.3(A:VIN-) U3.4(A:VOUT) ; also sheet 5
SUS_POT_1_EXT [diff pairs]: R35.1 ; also sheet 1
SUS_POT_2: C53.1 R128.2 U5.3(A:VIN-) U5.4(A:VOUT) ; also sheet 5
SUS_POT_2_EXT: R36.1 ; also sheet 1

### Notes on the sheet
- 30 to 3.31
  .1103 gain
- 15.75 to 3.387
  0.215x gain
- 30 to 3.31
  .1103 gain
- 15.75 to 3.387
  0.215x gain

## Power pins joined to a net without a drawn wire
3.3V: A2.3.3V A2.3.3V@1(3.3V) A3.3V3(3.3V) A3.3V3@2(3.3V) A3.3V3@3(3.3V)
3V3: A4.3V3
VBAT: A4.VBAT

## Library data of the parts
3V3 5V0 = HyTechDevices:LED_?_*: LED 0603 Blue <https://www.mouser.com/datasheet/2/216/APT1608VBC_D-246010.pdf> Green <https://www.mouser.com/datasheet/2/216/APT1608ZGCK-1173388.pdf> Orange <https://www.mouser.com/datasheet/2/216/APT1608SECK-6197.pdf> Red <https://www.mouser.com/datasheet/2/216/APT1608SECK-J3-PRV-1173336.pdf> White <https://www.mouser.com/datasheet/2/50/SM0603UWC-880813.pdf> Yellow <https://www.mouser.com/datasheet/2/216/APT1608SYCK-J3-PRV-1173311.pdf> 2835 (Series not on Digikey) Lumiled LUXEON 2835 Color Line <https://www.mouser.com/datasheet/2/602/DS236_luxeon_2835_color_line_datasheet-1596094.pdf>; COLOR: Yellow; DKPN: 754-1788-1-ND; MANUFACTURER: Kingbright; MOPN: 604-APT1608SYCK/J3-PRV; MPN: APT1608SYCK/J3-PRV
A1 = HyTechDevices:VOLTAGE_REGULATOR_MODULE_?_*: Voltage Regulator Modules OKI-78SR Datasheet <https://www.mouser.com/datasheet/2/281/oki-78sr-56393.pdf>; DKPN: 811-2196-5-ND; MANUFACTURER: Murata Power Solutions Inc.; MOPN: 580-OKI78SR5/1.5W36C; MPN: OKI-78SR-5/1.5-W36-C
A2 = HyTechDevices:TEENSY_4.1_SMT: Teensy 4.1 without VBAT Datasheet <https://www.pjrc.com/store/teensy41.html#pins> Requires ordering of: 2: 24 pin, 0.1" pitch SMT female headers; TEENSY: 4.1
A3 = HyTechDevices:TEENSY_4.1: Teensy 4.1 with VBAT Datasheet <https://www.pjrc.com/store/teensy41.html#pins> Requires ordering of: 2: 24 pin, 0.1" pitch female headers 1: 2 pin, 0.1" pitch female headers; TEENSY: 4.1
A4 = HyTechDevices:NRF9160LTE: SparkFun Thing Plus - nRF9160 LTE module Datasheet <https://cdn.sparkfun.com/assets/learn_tutorials/1/5/9/7/nRF9160_PS_v1.2.pdf> Sparkfun link <https://www.sparkfun.com/products/17354>; DKPN: 1568-WRL-17354-ND; MANUFACTURER: SparkFun Electronics; MOPN: 474-WRL-17354; MPN: WRL-17354
B BSPD C D E F G = HyTechDevices:LED_?_*: LED 0603 Blue <https://www.mouser.com/datasheet/2/216/APT1608VBC_D-246010.pdf> Green <https://www.mouser.com/datasheet/2/216/APT1608ZGCK-1173388.pdf> Orange <https://www.mouser.com/datasheet/2/216/APT1608SECK-6197.pdf> Red <https://www.mouser.com/datasheet/2/216/APT1608SECK-J3-PRV-1173336.pdf> White <https://www.mouser.com/datasheet/2/50/SM0603UWC-880813.pdf> Yellow <https://www.mouser.com/datasheet/2/216/APT1608SYCK-J3-PRV-1173311.pdf> 2835 (Series not on Digikey) Lumiled LUXEON 2835 Color Line <https://www.mouser.com/datasheet/2/602/DS236_luxeon_2835_color_line_datasheet-1596094.pdf>; COLOR: Green; DKPN: 754-1790-1-ND; MANUFACTURER: Kingbright; MOPN: 604-APT1608ZGCK; MPN: APT1608ZGCK
B_HI B_MIS C_HI C_MIS ESP GPS LTE MQTT RTK = HyTechDevices:LED_?_*: LED 0603 Blue <https://www.mouser.com/datasheet/2/216/APT1608VBC_D-246010.pdf> Green <https://www.mouser.com/datasheet/2/216/APT1608ZGCK-1173388.pdf> Orange <https://www.mouser.com/datasheet/2/216/APT1608SECK-6197.pdf> Red <https://www.mouser.com/datasheet/2/216/APT1608SECK-J3-PRV-1173336.pdf> White <https://www.mouser.com/datasheet/2/50/SM0603UWC-880813.pdf> Yellow <https://www.mouser.com/datasheet/2/216/APT1608SYCK-J3-PRV-1173311.pdf> 2835 (Series not on Digikey) Lumiled LUXEON 2835 Color Line <https://www.mouser.com/datasheet/2/602/DS236_luxeon_2835_color_line_datasheet-1596094.pdf>; COLOR: Red; DKPN: 754-1786-1-ND; MANUFACTURER: Kingbright; MOPN: 604-APT1608SECKJ3PRV; MPN: APT1608SECK/J3-PRV
BMS IMD SWOK WDOG = HyTechDevices:LED_?_*: LED 0603 Blue <https://www.mouser.com/datasheet/2/216/APT1608VBC_D-246010.pdf> Green <https://www.mouser.com/datasheet/2/216/APT1608ZGCK-1173388.pdf> Orange <https://www.mouser.com/datasheet/2/216/APT1608SECK-6197.pdf> Red <https://www.mouser.com/datasheet/2/216/APT1608SECK-J3-PRV-1173336.pdf> White <https://www.mouser.com/datasheet/2/50/SM0603UWC-880813.pdf> Yellow <https://www.mouser.com/datasheet/2/216/APT1608SYCK-J3-PRV-1173311.pdf> 2835 (Series not on Digikey) Lumiled LUXEON 2835 Color Line <https://www.mouser.com/datasheet/2/602/DS236_luxeon_2835_color_line_datasheet-1596094.pdf>; COLOR: Orange; DKPN: 754-1120-1-ND; MANUFACTURER: Kingbright; MOPN: 604-APT1608SECK; MPN: APT1608SECK
C1 C6 C9 C10 C12 C14-C22 C25 C33 C35 C41 C46 C51 C54 C57-C60 C62 C63 C65 C67-C70 C75 = HyTechDevices:CAPACITOR_?_*: Capacitor, Non-Polarized VJ...1BC Series Datasheet <https://www.mouser.com/datasheet/2/427/vjw1bcbascomseries-1762447.pdf> Samsung Datasheet <https://www.mouser.com/datasheet/2/585/MLCC-1837944.pdf> Samsung Automotive MLCC Datasheet <https://www.mouser.com/datasheet/2/585/MLCC_Automotive-1837966.pdf> Walsin Datasheet <https://www.mouser.com/datasheet/2/210/WTC_MLCC_General_Purpose-1534899.pdf> GRM188R61A226ME15D <https://www.mouser.com/datasheet/2/281/1/GRM188R61A226ME15_02A-1985787.pdf> GRM188R61E106MA73D <https://www.mouser.com/datasheet/2/281/1/GRM188R61E106MA73_01A-1985806.pdf> 885012006013 <https://www.mouser.com/datasheet/2/445/885012006013-1726946.pdf> 2220Y6300105KXTWS2 <https://www.mouser.com/datasheet/2/218/SMD_High_and_Std_StackiCap_P62-1825512.pdf> Yageo Class 2, X5R <https://www.mouser.com/datasheet/2/447/UPY_GPHC_X5R_4V_to_50V_26-1827097.pdf> TDK C Series <https://www.mouser.com/ProductDetail/TDK/C3216X5R1V226M160AC?qs=%2Fha2pyFadujbcx9jh7lYl%2F4NeMoXFhdc8AqVWNq4wW6M2y7zl6GzBuhgtI0ngznN> AVX Automotive MLCC <https://www.mouser.com/datasheet/2/40/AutoMLCC-777028.pdf> KEMET X7R Series <https://www.mouser.com/datasheet/2/212/KEM_C1002_X7R_SMD-1102033.pdf> Kyocera AVX <https://www.mouser.com/datasheet/2/40/C0GNP0_Dielectric-951274.pdf> GRM21BR61H <https://www.mouser.com/datasheet/2/281/1/GRM21BR61H106KE43_01A-1986884.pdf> C1812W104KDRACTU <https://www.mouser.com/datasheet/2/212/KEM_C1034_X7R_HV_ARC_SMD-1101730.pdf> CGA series - MLCC Automotive grade <https://product.tdk.com/system/files/dam/doc/product/capacitor/ceramic/mlcc/catalog/mlcc_automotive_general_en.pdf> TDK C Series Data Sheet <https://product.tdk.com/system/files/dam/doc/product/capacitor/ceramic/mlcc/catalog/mlcc_commercial_general_en.pdf>; CAPACITANCE: 0.1µF; DKPN: 720-1688-1-ND; MANUFACTURER: Vishay Vitramon; MOPN: 77-VJ0603Y104JXQPBC; MPN: VJ0603Y104JXQPW1BC; TOLERANCE: 5%; VOLTAGE: 10V
C2 C11 C13 C26 C29 C34 C39 C40 C44 C45 C49 C50 C52 C53 C56 C64 C73 C74 C78 C79 C82 C83 C85 C87 C89 C91 = HyTechDevices:CAPACITOR_?_*: Capacitor, Non-Polarized VJ...1BC Series Datasheet <https://www.mouser.com/datasheet/2/427/vjw1bcbascomseries-1762447.pdf> Samsung Datasheet <https://www.mouser.com/datasheet/2/585/MLCC-1837944.pdf> Samsung Automotive MLCC Datasheet <https://www.mouser.com/datasheet/2/585/MLCC_Automotive-1837966.pdf> Walsin Datasheet <https://www.mouser.com/datasheet/2/210/WTC_MLCC_General_Purpose-1534899.pdf> GRM188R61A226ME15D <https://www.mouser.com/datasheet/2/281/1/GRM188R61A226ME15_02A-1985787.pdf> GRM188R61E106MA73D <https://www.mouser.com/datasheet/2/281/1/GRM188R61E106MA73_01A-1985806.pdf> 885012006013 <https://www.mouser.com/datasheet/2/445/885012006013-1726946.pdf> 2220Y6300105KXTWS2 <https://www.mouser.com/datasheet/2/218/SMD_High_and_Std_StackiCap_P62-1825512.pdf> Yageo Class 2, X5R <https://www.mouser.com/datasheet/2/447/UPY_GPHC_X5R_4V_to_50V_26-1827097.pdf> TDK C Series <https://www.mouser.com/ProductDetail/TDK/C3216X5R1V226M160AC?qs=%2Fha2pyFadujbcx9jh7lYl%2F4NeMoXFhdc8AqVWNq4wW6M2y7zl6GzBuhgtI0ngznN> AVX Automotive MLCC <https://www.mouser.com/datasheet/2/40/AutoMLCC-777028.pdf> KEMET X7R Series <https://www.mouser.com/datasheet/2/212/KEM_C1002_X7R_SMD-1102033.pdf> Kyocera AVX <https://www.mouser.com/datasheet/2/40/C0GNP0_Dielectric-951274.pdf> GRM21BR61H <https://www.mouser.com/datasheet/2/281/1/GRM21BR61H106KE43_01A-1986884.pdf> C1812W104KDRACTU <https://www.mouser.com/datasheet/2/212/KEM_C1034_X7R_HV_ARC_SMD-1101730.pdf> CGA series - MLCC Automotive grade <https://product.tdk.com/system/files/dam/doc/product/capacitor/ceramic/mlcc/catalog/mlcc_automotive_general_en.pdf> TDK C Series Data Sheet <https://product.tdk.com/system/files/dam/doc/product/capacitor/ceramic/mlcc/catalog/mlcc_commercial_general_en.pdf>; CAPACITANCE: 1µF; DKPN: 311-1796-1-ND; MANUFACTURER: Yageo; MOPN: 603-CC603KRX7R6BB105; MPN: CC0603KRX7R6BB105; TOLERANCE: 10%; VOLTAGE: 10V
C3 = HyTechDevices:CAPACITOR_ELECTROLYTIC_?_*: A759 Series Aluminium Hybrid Electrolytic Capacitor Datasheet <https://www.mouser.com/datasheet/2/212/KEM_A4072_A759-1104329.pdf> EEH_AZS Hybrid Electrolytic Capacitor Datasheet <https://www.mouser.com/datasheet/2/315/DMD0000COL92-1141863.pdf> EEU-FP1E Aluminum Electrolytic Capacitor Datasheet <https://www.mouser.com/datasheet/2/315/RDF0000C1260-1391675.pdf>; CAPACITANCE: 470uF; DKPN: 10-EEH-AZS1V471BCT-ND; MANUFACTURER: Panasonic Electronic Components; MOPN: 667-EEH-AZS1V471B; MPN: EEH-AZS1V471B; TOLERANCE: 20&; VOLTAGE: 35V
C4 C5 C28 = HyTechDevices:CAPACITOR_?_*: Capacitor, Non-Polarized VJ...1BC Series Datasheet <https://www.mouser.com/datasheet/2/427/vjw1bcbascomseries-1762447.pdf> Samsung Datasheet <https://www.mouser.com/datasheet/2/585/MLCC-1837944.pdf> Samsung Automotive MLCC Datasheet <https://www.mouser.com/datasheet/2/585/MLCC_Automotive-1837966.pdf> Walsin Datasheet <https://www.mouser.com/datasheet/2/210/WTC_MLCC_General_Purpose-1534899.pdf> GRM188R61A226ME15D <https://www.mouser.com/datasheet/2/281/1/GRM188R61A226ME15_02A-1985787.pdf> GRM188R61E106MA73D <https://www.mouser.com/datasheet/2/281/1/GRM188R61E106MA73_01A-1985806.pdf> 885012006013 <https://www.mouser.com/datasheet/2/445/885012006013-1726946.pdf> 2220Y6300105KXTWS2 <https://www.mouser.com/datasheet/2/218/SMD_High_and_Std_StackiCap_P62-1825512.pdf> Yageo Class 2, X5R <https://www.mouser.com/datasheet/2/447/UPY_GPHC_X5R_4V_to_50V_26-1827097.pdf> TDK C Series <https://www.mouser.com/ProductDetail/TDK/C3216X5R1V226M160AC?qs=%2Fha2pyFadujbcx9jh7lYl%2F4NeMoXFhdc8AqVWNq4wW6M2y7zl6GzBuhgtI0ngznN> AVX Automotive MLCC <https://www.mouser.com/datasheet/2/40/AutoMLCC-777028.pdf> KEMET X7R Series <https://www.mouser.com/datasheet/2/212/KEM_C1002_X7R_SMD-1102033.pdf> Kyocera AVX <https://www.mouser.com/datasheet/2/40/C0GNP0_Dielectric-951274.pdf> GRM21BR61H <https://www.mouser.com/datasheet/2/281/1/GRM21BR61H106KE43_01A-1986884.pdf> C1812W104KDRACTU <https://www.mouser.com/datasheet/2/212/KEM_C1034_X7R_HV_ARC_SMD-1101730.pdf> CGA series - MLCC Automotive grade <https://product.tdk.com/system/files/dam/doc/product/capacitor/ceramic/mlcc/catalog/mlcc_automotive_general_en.pdf> TDK C Series Data Sheet <https://product.tdk.com/system/files/dam/doc/product/capacitor/ceramic/mlcc/catalog/mlcc_commercial_general_en.pdf>; CAPACITANCE: 10µF; DKPN: 490-7202-1-ND; MANUFACTURER: Murata Electronics; MOPN: 81-GRM188R61E106MA3D; MPN: GRM188R61E106MA73D; TOLERANCE: 20%; VOLTAGE: 25V
C7 C8 = HyTechDevices:CAPACITOR_?_*: Capacitor, Non-Polarized VJ...1BC Series Datasheet <https://www.mouser.com/datasheet/2/427/vjw1bcbascomseries-1762447.pdf> Samsung Datasheet <https://www.mouser.com/datasheet/2/585/MLCC-1837944.pdf> Samsung Automotive MLCC Datasheet <https://www.mouser.com/datasheet/2/585/MLCC_Automotive-1837966.pdf> Walsin Datasheet <https://www.mouser.com/datasheet/2/210/WTC_MLCC_General_Purpose-1534899.pdf> GRM188R61A226ME15D <https://www.mouser.com/datasheet/2/281/1/GRM188R61A226ME15_02A-1985787.pdf> GRM188R61E106MA73D <https://www.mouser.com/datasheet/2/281/1/GRM188R61E106MA73_01A-1985806.pdf> 885012006013 <https://www.mouser.com/datasheet/2/445/885012006013-1726946.pdf> 2220Y6300105KXTWS2 <https://www.mouser.com/datasheet/2/218/SMD_High_and_Std_StackiCap_P62-1825512.pdf> Yageo Class 2, X5R <https://www.mouser.com/datasheet/2/447/UPY_GPHC_X5R_4V_to_50V_26-1827097.pdf> TDK C Series <https://www.mouser.com/ProductDetail/TDK/C3216X5R1V226M160AC?qs=%2Fha2pyFadujbcx9jh7lYl%2F4NeMoXFhdc8AqVWNq4wW6M2y7zl6GzBuhgtI0ngznN> AVX Automotive MLCC <https://www.mouser.com/datasheet/2/40/AutoMLCC-777028.pdf> KEMET X7R Series <https://www.mouser.com/datasheet/2/212/KEM_C1002_X7R_SMD-1102033.pdf> Kyocera AVX <https://www.mouser.com/datasheet/2/40/C0GNP0_Dielectric-951274.pdf> GRM21BR61H <https://www.mouser.com/datasheet/2/281/1/GRM21BR61H106KE43_01A-1986884.pdf> C1812W104KDRACTU <https://www.mouser.com/datasheet/2/212/KEM_C1034_X7R_HV_ARC_SMD-1101730.pdf> CGA series - MLCC Automotive grade <https://product.tdk.com/system/files/dam/doc/product/capacitor/ceramic/mlcc/catalog/mlcc_automotive_general_en.pdf> TDK C Series Data Sheet <https://product.tdk.com/system/files/dam/doc/product/capacitor/ceramic/mlcc/catalog/mlcc_commercial_general_en.pdf>; CAPACITANCE: 1uF; DKPN: 587-2400-2-ND; MANUFACTURER: Taiyo Yuden; MOPN: 963-UMK107BJ105KA-T; MPN: UMK107BJ105KA-T; TOLERANCE: 10%; VOLTAGE: 50V
C23 C30 C36 C38 C42 C43 C47 C48 C71 C72 C76 C77 C80 C81 C84 C86 C88 C90 = HyTechDevices:CAPACITOR_?_*: Capacitor, Non-Polarized VJ...1BC Series Datasheet <https://www.mouser.com/datasheet/2/427/vjw1bcbascomseries-1762447.pdf> Samsung Datasheet <https://www.mouser.com/datasheet/2/585/MLCC-1837944.pdf> Samsung Automotive MLCC Datasheet <https://www.mouser.com/datasheet/2/585/MLCC_Automotive-1837966.pdf> Walsin Datasheet <https://www.mouser.com/datasheet/2/210/WTC_MLCC_General_Purpose-1534899.pdf> GRM188R61A226ME15D <https://www.mouser.com/datasheet/2/281/1/GRM188R61A226ME15_02A-1985787.pdf> GRM188R61E106MA73D <https://www.mouser.com/datasheet/2/281/1/GRM188R61E106MA73_01A-1985806.pdf> 885012006013 <https://www.mouser.com/datasheet/2/445/885012006013-1726946.pdf> 2220Y6300105KXTWS2 <https://www.mouser.com/datasheet/2/218/SMD_High_and_Std_StackiCap_P62-1825512.pdf> Yageo Class 2, X5R <https://www.mouser.com/datasheet/2/447/UPY_GPHC_X5R_4V_to_50V_26-1827097.pdf> TDK C Series <https://www.mouser.com/ProductDetail/TDK/C3216X5R1V226M160AC?qs=%2Fha2pyFadujbcx9jh7lYl%2F4NeMoXFhdc8AqVWNq4wW6M2y7zl6GzBuhgtI0ngznN> AVX Automotive MLCC <https://www.mouser.com/datasheet/2/40/AutoMLCC-777028.pdf> KEMET X7R Series <https://www.mouser.com/datasheet/2/212/KEM_C1002_X7R_SMD-1102033.pdf> Kyocera AVX <https://www.mouser.com/datasheet/2/40/C0GNP0_Dielectric-951274.pdf> GRM21BR61H <https://www.mouser.com/datasheet/2/281/1/GRM21BR61H106KE43_01A-1986884.pdf> C1812W104KDRACTU <https://www.mouser.com/datasheet/2/212/KEM_C1034_X7R_HV_ARC_SMD-1101730.pdf> CGA series - MLCC Automotive grade <https://product.tdk.com/system/files/dam/doc/product/capacitor/ceramic/mlcc/catalog/mlcc_automotive_general_en.pdf> TDK C Series Data Sheet <https://product.tdk.com/system/files/dam/doc/product/capacitor/ceramic/mlcc/catalog/mlcc_commercial_general_en.pdf>; CAPACITANCE: 0.47µF; DKPN: 445-5192-1-ND; MANUFACTURER: TDK Corporation; MOPN: 810-C1608X7R1C474K; MPN: C1608X7R1C474K080AC; TOLERANCE: 10%; VOLTAGE: 16V
C24 C61 = HyTechDevices:CAPACITOR_?_*: Capacitor, Non-Polarized VJ...1BC Series Datasheet <https://www.mouser.com/datasheet/2/427/vjw1bcbascomseries-1762447.pdf> Samsung Datasheet <https://www.mouser.com/datasheet/2/585/MLCC-1837944.pdf> Samsung Automotive MLCC Datasheet <https://www.mouser.com/datasheet/2/585/MLCC_Automotive-1837966.pdf> Walsin Datasheet <https://www.mouser.com/datasheet/2/210/WTC_MLCC_General_Purpose-1534899.pdf> GRM188R61A226ME15D <https://www.mouser.com/datasheet/2/281/1/GRM188R61A226ME15_02A-1985787.pdf> GRM188R61E106MA73D <https://www.mouser.com/datasheet/2/281/1/GRM188R61E106MA73_01A-1985806.pdf> 885012006013 <https://www.mouser.com/datasheet/2/445/885012006013-1726946.pdf> 2220Y6300105KXTWS2 <https://www.mouser.com/datasheet/2/218/SMD_High_and_Std_StackiCap_P62-1825512.pdf> Yageo Class 2, X5R <https://www.mouser.com/datasheet/2/447/UPY_GPHC_X5R_4V_to_50V_26-1827097.pdf> TDK C Series <https://www.mouser.com/ProductDetail/TDK/C3216X5R1V226M160AC?qs=%2Fha2pyFadujbcx9jh7lYl%2F4NeMoXFhdc8AqVWNq4wW6M2y7zl6GzBuhgtI0ngznN> AVX Automotive MLCC <https://www.mouser.com/datasheet/2/40/AutoMLCC-777028.pdf> KEMET X7R Series <https://www.mouser.com/datasheet/2/212/KEM_C1002_X7R_SMD-1102033.pdf> Kyocera AVX <https://www.mouser.com/datasheet/2/40/C0GNP0_Dielectric-951274.pdf> GRM21BR61H <https://www.mouser.com/datasheet/2/281/1/GRM21BR61H106KE43_01A-1986884.pdf> C1812W104KDRACTU <https://www.mouser.com/datasheet/2/212/KEM_C1034_X7R_HV_ARC_SMD-1101730.pdf> CGA series - MLCC Automotive grade <https://product.tdk.com/system/files/dam/doc/product/capacitor/ceramic/mlcc/catalog/mlcc_automotive_general_en.pdf> TDK C Series Data Sheet <https://product.tdk.com/system/files/dam/doc/product/capacitor/ceramic/mlcc/catalog/mlcc_commercial_general_en.pdf>; CAPACITANCE: 4.7nF; DKPN: 732-7931-1-ND; MANUFACTURER: Würth Elektronik; MOPN: 710-885012206012; MPN: 885012206012; TOLERANCE: 10%; VOLTAGE: 10V
C27 = HyTechDevices:CAPACITOR_?_*: Capacitor, Non-Polarized VJ...1BC Series Datasheet <https://www.mouser.com/datasheet/2/427/vjw1bcbascomseries-1762447.pdf> Samsung Datasheet <https://www.mouser.com/datasheet/2/585/MLCC-1837944.pdf> Samsung Automotive MLCC Datasheet <https://www.mouser.com/datasheet/2/585/MLCC_Automotive-1837966.pdf> Walsin Datasheet <https://www.mouser.com/datasheet/2/210/WTC_MLCC_General_Purpose-1534899.pdf> GRM188R61A226ME15D <https://www.mouser.com/datasheet/2/281/1/GRM188R61A226ME15_02A-1985787.pdf> GRM188R61E106MA73D <https://www.mouser.com/datasheet/2/281/1/GRM188R61E106MA73_01A-1985806.pdf> 885012006013 <https://www.mouser.com/datasheet/2/445/885012006013-1726946.pdf> 2220Y6300105KXTWS2 <https://www.mouser.com/datasheet/2/218/SMD_High_and_Std_StackiCap_P62-1825512.pdf> Yageo Class 2, X5R <https://www.mouser.com/datasheet/2/447/UPY_GPHC_X5R_4V_to_50V_26-1827097.pdf> TDK C Series <https://www.mouser.com/ProductDetail/TDK/C3216X5R1V226M160AC?qs=%2Fha2pyFadujbcx9jh7lYl%2F4NeMoXFhdc8AqVWNq4wW6M2y7zl6GzBuhgtI0ngznN> AVX Automotive MLCC <https://www.mouser.com/datasheet/2/40/AutoMLCC-777028.pdf> KEMET X7R Series <https://www.mouser.com/datasheet/2/212/KEM_C1002_X7R_SMD-1102033.pdf> Kyocera AVX <https://www.mouser.com/datasheet/2/40/C0GNP0_Dielectric-951274.pdf> GRM21BR61H <https://www.mouser.com/datasheet/2/281/1/GRM21BR61H106KE43_01A-1986884.pdf> C1812W104KDRACTU <https://www.mouser.com/datasheet/2/212/KEM_C1034_X7R_HV_ARC_SMD-1101730.pdf> CGA series - MLCC Automotive grade <https://product.tdk.com/system/files/dam/doc/product/capacitor/ceramic/mlcc/catalog/mlcc_automotive_general_en.pdf> TDK C Series Data Sheet <https://product.tdk.com/system/files/dam/doc/product/capacitor/ceramic/mlcc/catalog/mlcc_commercial_general_en.pdf>; CAPACITANCE: 10uF; DKPN: 490-18663-2-ND; MANUFACTURER: Murata; MOPN: 81-GRM21BR61H106KE3L; MPN: GRM21BR61H106KE43L; TOLERANCE: 10%; VOLTAGE: 50V
C31 = HyTechDevices:CAPACITOR_?_*: Capacitor, Non-Polarized VJ...1BC Series Datasheet <https://www.mouser.com/datasheet/2/427/vjw1bcbascomseries-1762447.pdf> Samsung Datasheet <https://www.mouser.com/datasheet/2/585/MLCC-1837944.pdf> Samsung Automotive MLCC Datasheet <https://www.mouser.com/datasheet/2/585/MLCC_Automotive-1837966.pdf> Walsin Datasheet <https://www.mouser.com/datasheet/2/210/WTC_MLCC_General_Purpose-1534899.pdf> GRM188R61A226ME15D <https://www.mouser.com/datasheet/2/281/1/GRM188R61A226ME15_02A-1985787.pdf> GRM188R61E106MA73D <https://www.mouser.com/datasheet/2/281/1/GRM188R61E106MA73_01A-1985806.pdf> 885012006013 <https://www.mouser.com/datasheet/2/445/885012006013-1726946.pdf> 2220Y6300105KXTWS2 <https://www.mouser.com/datasheet/2/218/SMD_High_and_Std_StackiCap_P62-1825512.pdf> Yageo Class 2, X5R <https://www.mouser.com/datasheet/2/447/UPY_GPHC_X5R_4V_to_50V_26-1827097.pdf> TDK C Series <https://www.mouser.com/ProductDetail/TDK/C3216X5R1V226M160AC?qs=%2Fha2pyFadujbcx9jh7lYl%2F4NeMoXFhdc8AqVWNq4wW6M2y7zl6GzBuhgtI0ngznN> AVX Automotive MLCC <https://www.mouser.com/datasheet/2/40/AutoMLCC-777028.pdf> KEMET X7R Series <https://www.mouser.com/datasheet/2/212/KEM_C1002_X7R_SMD-1102033.pdf> Kyocera AVX <https://www.mouser.com/datasheet/2/40/C0GNP0_Dielectric-951274.pdf> GRM21BR61H <https://www.mouser.com/datasheet/2/281/1/GRM21BR61H106KE43_01A-1986884.pdf> C1812W104KDRACTU <https://www.mouser.com/datasheet/2/212/KEM_C1034_X7R_HV_ARC_SMD-1101730.pdf> CGA series - MLCC Automotive grade <https://product.tdk.com/system/files/dam/doc/product/capacitor/ceramic/mlcc/catalog/mlcc_automotive_general_en.pdf> TDK C Series Data Sheet <https://product.tdk.com/system/files/dam/doc/product/capacitor/ceramic/mlcc/catalog/mlcc_commercial_general_en.pdf>; CAPACITANCE: 1.2nF; DKPN: 311-4079-2-ND; MANUFACTURER: YAGEO; MOPN: 603-CC603KRX7R8BB122; MPN: CC0603KRX7R8BB122; TOLERANCE: 10%; VOLTAGE: 25V
C32 C37 = HyTechDevices:CAPACITOR_?_*: Capacitor, Non-Polarized VJ...1BC Series Datasheet <https://www.mouser.com/datasheet/2/427/vjw1bcbascomseries-1762447.pdf> Samsung Datasheet <https://www.mouser.com/datasheet/2/585/MLCC-1837944.pdf> Samsung Automotive MLCC Datasheet <https://www.mouser.com/datasheet/2/585/MLCC_Automotive-1837966.pdf> Walsin Datasheet <https://www.mouser.com/datasheet/2/210/WTC_MLCC_General_Purpose-1534899.pdf> GRM188R61A226ME15D <https://www.mouser.com/datasheet/2/281/1/GRM188R61A226ME15_02A-1985787.pdf> GRM188R61E106MA73D <https://www.mouser.com/datasheet/2/281/1/GRM188R61E106MA73_01A-1985806.pdf> 885012006013 <https://www.mouser.com/datasheet/2/445/885012006013-1726946.pdf> 2220Y6300105KXTWS2 <https://www.mouser.com/datasheet/2/218/SMD_High_and_Std_StackiCap_P62-1825512.pdf> Yageo Class 2, X5R <https://www.mouser.com/datasheet/2/447/UPY_GPHC_X5R_4V_to_50V_26-1827097.pdf> TDK C Series <https://www.mouser.com/ProductDetail/TDK/C3216X5R1V226M160AC?qs=%2Fha2pyFadujbcx9jh7lYl%2F4NeMoXFhdc8AqVWNq4wW6M2y7zl6GzBuhgtI0ngznN> AVX Automotive MLCC <https://www.mouser.com/datasheet/2/40/AutoMLCC-777028.pdf> KEMET X7R Series <https://www.mouser.com/datasheet/2/212/KEM_C1002_X7R_SMD-1102033.pdf> Kyocera AVX <https://www.mouser.com/datasheet/2/40/C0GNP0_Dielectric-951274.pdf> GRM21BR61H <https://www.mouser.com/datasheet/2/281/1/GRM21BR61H106KE43_01A-1986884.pdf> C1812W104KDRACTU <https://www.mouser.com/datasheet/2/212/KEM_C1034_X7R_HV_ARC_SMD-1101730.pdf> CGA series - MLCC Automotive grade <https://product.tdk.com/system/files/dam/doc/product/capacitor/ceramic/mlcc/catalog/mlcc_automotive_general_en.pdf> TDK C Series Data Sheet <https://product.tdk.com/system/files/dam/doc/product/capacitor/ceramic/mlcc/catalog/mlcc_commercial_general_en.pdf>; CAPACITANCE: 10nF; DKPN: 311-4054-1-ND; MANUFACTURER: Yageo; MOPN: 603-CC603KRX7R6BB103; MPN: CC0603KRX7R6BB103; TOLERANCE: 10%; VOLTAGE: 10V
CUR TP1-TP4 TP6-TP13 = HyTechDevices:TEST_POINT: Test Point for Probing; DKPN: 36-5015CT-ND; MANUFACTURER: Keystone Electronics; MOPN: 534-5015; MPN: 5015
D1 = HyTechDevices:ZENER_?_*: Zener Diode 1SMB5949B-13 <https://www.diodes.com/assets/Datasheets/ds32125.pdf> SMBJ5350B-TP <https://www.mccsemi.com/pdf/Products/SMBJ5338B-SMBJ5388B(SMB).pdf>; CURRENT: 0.031A; DKPN: 1SMB5927B-13DICT-ND; MANUFACTURER: Diodes Incorporated; MOPN: 621-1SMB5927B-13; MPN: 1SMB5927B-13; VOLTAGE: 12V
D3 D9-D17 = HyTechDevices:SCHOTTKY_?_*: CUS08F30 Shottky Diode Datasheet <https://www.mouser.com/datasheet/2/408/CUS08F30_datasheet_en_20140414-1916097.pdf> CMDSH2-3 Shottky Diode Datasheet <https://www.mouser.com/datasheet/2/68/cmdsh2-3-39086.pdf> SD1206S040S2R0 Schottky Diode Datasheet <https://datasheets.kyocera-avx.com/schottky.pdf>; CURRENT: 0.8A; DKPN: CUS08F30H3FTR-ND; MANUFACTURER: Toshiba Semiconductor and Storage; MOPN: 757-CUS08F30H3F; MPN: CUS08F30; VOLTAGE: 30V
D4-D8 = HyTechDevices:TVS_?_*: TVS Diode GSOT Datasheet <https://www.mouser.com/datasheet/2/427/gsot03-1767593.pdf>; DKPN: 118-1.5SMBJ30ATR-ND; MANUFACTURER: Bourns Inc.; MOPN: 652-1.5SMBJ30A; MPN: 1.5SMBJ30A; VOLTAGE: 30V
D18 = HyTechDevices:TVS_?_*: TVS Diode GSOT Datasheet <https://www.mouser.com/datasheet/2/427/gsot03-1767593.pdf>; DKPN: GSOT03-E3-08CT-ND; MANUFACTURER: Vishay General Semiconductor - Diodes Division; MOPN: 78-GSOT03-E3-08; MPN: GSOT03-E3-08; VOLTAGE: 3.3V
D19-D22 = HyTechDevices:TVS_?_*: TVS Diode GSOT Datasheet <https://www.mouser.com/datasheet/2/427/gsot03-1767593.pdf>; DKPN: GSOT15-E3-08CT-ND; MANUFACTURER: Vishay General Semiconductor - Diodes Division; MOPN: 78-GSOT15-E3-08; MPN: GSOT15-E3-08; VOLTAGE: 15V
D23 D24 = HyTechDevices:TVS_BIDIRECTIONAL_DUAL: Bdirectional TVS for CAN ESD Datasheet <https://www.ti.com/lit/ds/symlink/tpd2e007.pdf?HQS=dis-mous-null-mousermode-dsf-pf-null-wwe&ts=1615155679700&ref_url=https%253A%252F%252Fwww.mouser.com%252F>; DKPN: 296-25281-1-ND; MANUFACTURER: Texas Instruments; MOPN: 595-TPD2E007DCKR; MPN: TPD2E007DCKR
J1 J2 = HyTechDevices:CONNECTOR-24_?_*: 24 pin ribbon connector header (EHT-112-01) Catalog <https://suddendocs.samtec.com/catalog_english/eht.pdf> Datasheet <http://suddendocs.samtec.com/prints/eht-d.pdf> Part <https://www.digikey.com/en/products/detail/samtec-inc/EHT-112-01-F-D/6693915>; DKPN: EHT-112-01-F-D-ND; MANUFACTURER: Samtec; MOPN: 200-EHT11201FD; MPN: EHT-112-01-F-D
JP1 JP3 JP5-JP8 = HyTechDevices:JUMPER_?_*: 2 Pin Connector; DKPN: S1011EC-02-ND; MANUFACTURER: Sullins Connector Solutions; MPN: PRPC002SAAN-RC
JP2 JP4 JP9-JP12 = HyTechDevices:JUMPER_?_*: 2 Pin Connector; DKPN: 13-RC0603FR-130RLTR-ND; MANUFACTURER: YAGEO; MOPN: 603-RC0603FR-130RL; MPN: RC0603FR-130RL
K1-K5 = HyTechDevices:RELAY_DPDT_*: Dual Pole, Dual Throw Relay Datasheet <https://www.mouser.com/datasheet/2/418/5/NG_DS_RT2_1014-572844.pdf>; DKPN: PB2077CT-ND; MANUFACTURER: TE Connectivity; MOPN: 655-3-1462039-7; MPN: 3-1462039-7
LATCH = HyTechDevices:LED_?_*: LED 0603 Blue <https://www.mouser.com/datasheet/2/216/APT1608VBC_D-246010.pdf> Green <https://www.mouser.com/datasheet/2/216/APT1608ZGCK-1173388.pdf> Orange <https://www.mouser.com/datasheet/2/216/APT1608SECK-6197.pdf> Red <https://www.mouser.com/datasheet/2/216/APT1608SECK-J3-PRV-1173336.pdf> White <https://www.mouser.com/datasheet/2/50/SM0603UWC-880813.pdf> Yellow <https://www.mouser.com/datasheet/2/216/APT1608SYCK-J3-PRV-1173311.pdf> 2835 (Series not on Digikey) Lumiled LUXEON 2835 Color Line <https://www.mouser.com/datasheet/2/602/DS236_luxeon_2835_color_line_datasheet-1596094.pdf>; COLOR: White; DKPN: SM0603UWC-ND; MANUFACTURER: Bivar Inc.; MOPN: 749-SM0603UWC; MPN: SM0603UWC
Q1 Q4 = HyTechDevices:TRANSISTOR_N_MOS_?_*: N-MOSFET PMV15ENEA Datasheet <https://www.mouser.com/datasheet/2/916/PMV15ENEA-1604828.pdf> TK6P65W Datasheet <https://www.mouser.com/datasheet/2/408/TK6P65W_datasheet_en_20151225-1916290.pdf> SIR638ADP Datasheet <https://www.mouser.com/datasheet/2/427/sir638adp-1766131.pdf> DMG3406L Datasheet <https://www.diodes.com/assets/Datasheets/DMG3406L.pdf> STL2N80K5 <https://www.mouser.com/datasheet/2/389/dm00092662-1798082.pdf>; DKPN: DMG3406L-7DITR-ND; MANUFACTURER: Diodes Incorporated; MOPN: 621-DMG3406L-7; MPN: DMG3406L-7
Q2 Q3 Q5 = HyTechDevices:TRANSISTOR_P_MOS_?_*: P-MOSFET SI2369DS Datasheet <https://www.mouser.com/datasheet/2/427/si2369d-1764360.pdf> DMP3056L Datasheet <https://www.mouser.com/datasheet/2/115/DIOD_S_A0012915142_1-2543925.pdf>; DKPN: DMP3056L-7DITR-ND; MANUFACTURER: Diodes Incorporated; MOPN: 621-DMP3056L-7; MPN: DMP3056L-7
R1 R3 R35 R36 R54 R55 R67 R69 R73 R74 R77 R88 R95 R102 R109 R116 R122 R133 R134 R143 R147 R149 = HyTechDevices:RESISTOR_?_*: Resistor PWR163 Series <https://www.mouser.com/datasheet/2/54/pwr163-777985.pdf> AC Series <https://www.mouser.com/datasheet/2/447/Yageo_PYu_AC_51_RoHS_L_7_1714230-1874691.pdf> PU Series <https://www.mouser.com/datasheet/2/447/PYu-PU_51_RoHS_L_6-1504619.pdf> UCR Series <https://fscdn.rohm.com/en/products/databook/datasheet/passive/resistor/chip_resistor/ucr-e.pdf> ERA Series <https://www.mouser.com/datasheet/2/315/AOA0000C307-1149632.pdf> PWR263 Series <https://www.mouser.com/datasheet/2/54/pwr263s_35-778069.pdf> KTR Series <https://www.mouser.com/datasheet/2/348/ROHM_S_A0011075115_1-2563276.pdf> RC Series <https://www.mouser.com/datasheet/2/447/Yageo_03_18_2021_PYu_RC_Group_51_RoHS_L_11-2199992.pdf> ERJ Low Resistance Series <https://www.mouser.com/datasheet/2/315/AOA0000C313-1141758.pdf> ERJ PB3, PB6 Series <https://www.mouser.com/datasheet/2/315/AOA0000C328-1530132.pdf> ERJ UP3, UP6, UP8 Series <https://www.mouser.com/datasheet/2/315/Panasonic_Resistors_Thick_Film_Anti_Sulf_Anti_Surg-1825099.pdf> ERJ PA2, P03, PA3, P06, P08, P14 Series <https://www.mouser.com/datasheet/2/315/AOA0000C331-1141874.pdf> B20 Series <https://www.ohmite.com/assets/docs/res_200.pdf?r=false> TE Connectivity/Holsworthy RN73 Series <https://www.mouser.com/datasheet/2/418/4/NG_DS_1773270_M-604713.pdf> Vishay Dale D/CRCW e3 <https://www.mouser.com/datasheet/2/427/dcrcwe3-1762152.pdf> Ohmite B20 <https://www.ohmite.com/assets/docs/res_200.pdf?r=false>; DKPN: P10KBDCT-ND; MANUFACTURER: Panasonic Electronic Components; MOPN: 667-ERA-3ARB103V; MPN: ERA-3ARB103V; POWER: 0.1W; RESISTANCE: 10k; TOLERANCE: 0.1%; VOLTAGE_CONTINUOUS: 31.62V; VOLTAGE_MAX: 75V
R2 R4 = HyTechDevices:RESISTOR_?_*: Resistor PWR163 Series <https://www.mouser.com/datasheet/2/54/pwr163-777985.pdf> AC Series <https://www.mouser.com/datasheet/2/447/Yageo_PYu_AC_51_RoHS_L_7_1714230-1874691.pdf> PU Series <https://www.mouser.com/datasheet/2/447/PYu-PU_51_RoHS_L_6-1504619.pdf> UCR Series <https://fscdn.rohm.com/en/products/databook/datasheet/passive/resistor/chip_resistor/ucr-e.pdf> ERA Series <https://www.mouser.com/datasheet/2/315/AOA0000C307-1149632.pdf> PWR263 Series <https://www.mouser.com/datasheet/2/54/pwr263s_35-778069.pdf> KTR Series <https://www.mouser.com/datasheet/2/348/ROHM_S_A0011075115_1-2563276.pdf> RC Series <https://www.mouser.com/datasheet/2/447/Yageo_03_18_2021_PYu_RC_Group_51_RoHS_L_11-2199992.pdf> ERJ Low Resistance Series <https://www.mouser.com/datasheet/2/315/AOA0000C313-1141758.pdf> ERJ PB3, PB6 Series <https://www.mouser.com/datasheet/2/315/AOA0000C328-1530132.pdf> ERJ UP3, UP6, UP8 Series <https://www.mouser.com/datasheet/2/315/Panasonic_Resistors_Thick_Film_Anti_Sulf_Anti_Surg-1825099.pdf> ERJ PA2, P03, PA3, P06, P08, P14 Series <https://www.mouser.com/datasheet/2/315/AOA0000C331-1141874.pdf> B20 Series <https://www.ohmite.com/assets/docs/res_200.pdf?r=false> TE Connectivity/Holsworthy RN73 Series <https://www.mouser.com/datasheet/2/418/4/NG_DS_1773270_M-604713.pdf> Vishay Dale D/CRCW e3 <https://www.mouser.com/datasheet/2/427/dcrcwe3-1762152.pdf> Ohmite B20 <https://www.ohmite.com/assets/docs/res_200.pdf?r=false>; DKPN: P20340TR-ND; MANUFACTURER: Panasonic Electronic Components; MOPN: 667-ERJ-PB3D3301V; MPN: ERJ-PB3D3301V; POWER: 0.3W; RESISTANCE: 3.3k; TOLERANCE: 0.5%; VOLTAGE_CONTINUOUS: 25.69V; VOLTAGE_MAX: 150
R5 R8 R11 R14 R17 R20 R24-R27 R31 R32 R57-R61 = HyTechDevices:RESISTOR_?_*: Resistor PWR163 Series <https://www.mouser.com/datasheet/2/54/pwr163-777985.pdf> AC Series <https://www.mouser.com/datasheet/2/447/Yageo_PYu_AC_51_RoHS_L_7_1714230-1874691.pdf> PU Series <https://www.mouser.com/datasheet/2/447/PYu-PU_51_RoHS_L_6-1504619.pdf> UCR Series <https://fscdn.rohm.com/en/products/databook/datasheet/passive/resistor/chip_resistor/ucr-e.pdf> ERA Series <https://www.mouser.com/datasheet/2/315/AOA0000C307-1149632.pdf> PWR263 Series <https://www.mouser.com/datasheet/2/54/pwr263s_35-778069.pdf> KTR Series <https://www.mouser.com/datasheet/2/348/ROHM_S_A0011075115_1-2563276.pdf> RC Series <https://www.mouser.com/datasheet/2/447/Yageo_03_18_2021_PYu_RC_Group_51_RoHS_L_11-2199992.pdf> ERJ Low Resistance Series <https://www.mouser.com/datasheet/2/315/AOA0000C313-1141758.pdf> ERJ PB3, PB6 Series <https://www.mouser.com/datasheet/2/315/AOA0000C328-1530132.pdf> ERJ UP3, UP6, UP8 Series <https://www.mouser.com/datasheet/2/315/Panasonic_Resistors_Thick_Film_Anti_Sulf_Anti_Surg-1825099.pdf> ERJ PA2, P03, PA3, P06, P08, P14 Series <https://www.mouser.com/datasheet/2/315/AOA0000C331-1141874.pdf> B20 Series <https://www.ohmite.com/assets/docs/res_200.pdf?r=false> TE Connectivity/Holsworthy RN73 Series <https://www.mouser.com/datasheet/2/418/4/NG_DS_1773270_M-604713.pdf> Vishay Dale D/CRCW e3 <https://www.mouser.com/datasheet/2/427/dcrcwe3-1762152.pdf> Ohmite B20 <https://www.ohmite.com/assets/docs/res_200.pdf?r=false>; DKPN: 10-ERJ-UP3F2001VTR-ND; MANUFACTURER: Panasonic Electronic Components; MOPN: 667-ERJ-UP3F2001V; MPN: ERJ-UP3F2001V; POWER: 0.25W; RESISTANCE: 2k; TOLERANCE: 1%; VOLTAGE_CONTINUOUS: 22.36V; VOLTAGE_MAX: 150V
R6 R9 R12 R15 R18 R21 R135-R137 = HyTechDevices:RESISTOR_?_*: Resistor PWR163 Series <https://www.mouser.com/datasheet/2/54/pwr163-777985.pdf> AC Series <https://www.mouser.com/datasheet/2/447/Yageo_PYu_AC_51_RoHS_L_7_1714230-1874691.pdf> PU Series <https://www.mouser.com/datasheet/2/447/PYu-PU_51_RoHS_L_6-1504619.pdf> UCR Series <https://fscdn.rohm.com/en/products/databook/datasheet/passive/resistor/chip_resistor/ucr-e.pdf> ERA Series <https://www.mouser.com/datasheet/2/315/AOA0000C307-1149632.pdf> PWR263 Series <https://www.mouser.com/datasheet/2/54/pwr263s_35-778069.pdf> KTR Series <https://www.mouser.com/datasheet/2/348/ROHM_S_A0011075115_1-2563276.pdf> RC Series <https://www.mouser.com/datasheet/2/447/Yageo_03_18_2021_PYu_RC_Group_51_RoHS_L_11-2199992.pdf> ERJ Low Resistance Series <https://www.mouser.com/datasheet/2/315/AOA0000C313-1141758.pdf> ERJ PB3, PB6 Series <https://www.mouser.com/datasheet/2/315/AOA0000C328-1530132.pdf> ERJ UP3, UP6, UP8 Series <https://www.mouser.com/datasheet/2/315/Panasonic_Resistors_Thick_Film_Anti_Sulf_Anti_Surg-1825099.pdf> ERJ PA2, P03, PA3, P06, P08, P14 Series <https://www.mouser.com/datasheet/2/315/AOA0000C331-1141874.pdf> B20 Series <https://www.ohmite.com/assets/docs/res_200.pdf?r=false> TE Connectivity/Holsworthy RN73 Series <https://www.mouser.com/datasheet/2/418/4/NG_DS_1773270_M-604713.pdf> Vishay Dale D/CRCW e3 <https://www.mouser.com/datasheet/2/427/dcrcwe3-1762152.pdf> Ohmite B20 <https://www.ohmite.com/assets/docs/res_200.pdf?r=false>; DKPN: 311-4.64KHRCT-ND; MANUFACTURER: Yageo; MOPN: 603-RC0603FR-074K64L; MPN: RC0603FR-074K64L; POWER: 0.1W; RESISTANCE: 4.64k; TOLERANCE: 1%; VOLTAGE_CONTINUOUS: 21.54V; VOLTAGE_MAX: 75V
R7 R10 R13 R16 R19 R22 R138-R140 = HyTechDevices:RESISTOR_?_*: Resistor PWR163 Series <https://www.mouser.com/datasheet/2/54/pwr163-777985.pdf> AC Series <https://www.mouser.com/datasheet/2/447/Yageo_PYu_AC_51_RoHS_L_7_1714230-1874691.pdf> PU Series <https://www.mouser.com/datasheet/2/447/PYu-PU_51_RoHS_L_6-1504619.pdf> UCR Series <https://fscdn.rohm.com/en/products/databook/datasheet/passive/resistor/chip_resistor/ucr-e.pdf> ERA Series <https://www.mouser.com/datasheet/2/315/AOA0000C307-1149632.pdf> PWR263 Series <https://www.mouser.com/datasheet/2/54/pwr263s_35-778069.pdf> KTR Series <https://www.mouser.com/datasheet/2/348/ROHM_S_A0011075115_1-2563276.pdf> RC Series <https://www.mouser.com/datasheet/2/447/Yageo_03_18_2021_PYu_RC_Group_51_RoHS_L_11-2199992.pdf> ERJ Low Resistance Series <https://www.mouser.com/datasheet/2/315/AOA0000C313-1141758.pdf> ERJ PB3, PB6 Series <https://www.mouser.com/datasheet/2/315/AOA0000C328-1530132.pdf> ERJ UP3, UP6, UP8 Series <https://www.mouser.com/datasheet/2/315/Panasonic_Resistors_Thick_Film_Anti_Sulf_Anti_Surg-1825099.pdf> ERJ PA2, P03, PA3, P06, P08, P14 Series <https://www.mouser.com/datasheet/2/315/AOA0000C331-1141874.pdf> B20 Series <https://www.ohmite.com/assets/docs/res_200.pdf?r=false> TE Connectivity/Holsworthy RN73 Series <https://www.mouser.com/datasheet/2/418/4/NG_DS_1773270_M-604713.pdf> Vishay Dale D/CRCW e3 <https://www.mouser.com/datasheet/2/427/dcrcwe3-1762152.pdf> Ohmite B20 <https://www.ohmite.com/assets/docs/res_200.pdf?r=false>; DKPN: 311-36.5KHRCT-ND; MANUFACTURER: Yageo; MOPN: 603-RC0603FR-0736K5L; MPN: RC0603FR-0736K5L; POWER: 0.1W; RESISTANCE: 36.5k; TOLERANCE: 1%; VOLTAGE_CONTINUOUS: 60.42V; VOLTAGE_MAX: 75V
R23 R30 = HyTechDevices:RESISTOR_?_*: Resistor PWR163 Series <https://www.mouser.com/datasheet/2/54/pwr163-777985.pdf> AC Series <https://www.mouser.com/datasheet/2/447/Yageo_PYu_AC_51_RoHS_L_7_1714230-1874691.pdf> PU Series <https://www.mouser.com/datasheet/2/447/PYu-PU_51_RoHS_L_6-1504619.pdf> UCR Series <https://fscdn.rohm.com/en/products/databook/datasheet/passive/resistor/chip_resistor/ucr-e.pdf> ERA Series <https://www.mouser.com/datasheet/2/315/AOA0000C307-1149632.pdf> PWR263 Series <https://www.mouser.com/datasheet/2/54/pwr263s_35-778069.pdf> KTR Series <https://www.mouser.com/datasheet/2/348/ROHM_S_A0011075115_1-2563276.pdf> RC Series <https://www.mouser.com/datasheet/2/447/Yageo_03_18_2021_PYu_RC_Group_51_RoHS_L_11-2199992.pdf> ERJ Low Resistance Series <https://www.mouser.com/datasheet/2/315/AOA0000C313-1141758.pdf> ERJ PB3, PB6 Series <https://www.mouser.com/datasheet/2/315/AOA0000C328-1530132.pdf> ERJ UP3, UP6, UP8 Series <https://www.mouser.com/datasheet/2/315/Panasonic_Resistors_Thick_Film_Anti_Sulf_Anti_Surg-1825099.pdf> ERJ PA2, P03, PA3, P06, P08, P14 Series <https://www.mouser.com/datasheet/2/315/AOA0000C331-1141874.pdf> B20 Series <https://www.ohmite.com/assets/docs/res_200.pdf?r=false> TE Connectivity/Holsworthy RN73 Series <https://www.mouser.com/datasheet/2/418/4/NG_DS_1773270_M-604713.pdf> Vishay Dale D/CRCW e3 <https://www.mouser.com/datasheet/2/427/dcrcwe3-1762152.pdf> Ohmite B20 <https://www.ohmite.com/assets/docs/res_200.pdf?r=false>; DKPN: P120DBCT-ND; MANUFACTURER: Panasonic Electronic Components; MOPN: 667-ERA-3AEB121V; MPN: ERA-3AEB121V; POWER: 0.1W; RESISTANCE: 120; TOLERANCE: 0.1%; VOLTAGE_CONTINUOUS: 3.46V; VOLTAGE_MAX: 75V
R28 = HyTechDevices:RESISTOR_?_*: Resistor PWR163 Series <https://www.mouser.com/datasheet/2/54/pwr163-777985.pdf> AC Series <https://www.mouser.com/datasheet/2/447/Yageo_PYu_AC_51_RoHS_L_7_1714230-1874691.pdf> PU Series <https://www.mouser.com/datasheet/2/447/PYu-PU_51_RoHS_L_6-1504619.pdf> UCR Series <https://fscdn.rohm.com/en/products/databook/datasheet/passive/resistor/chip_resistor/ucr-e.pdf> ERA Series <https://www.mouser.com/datasheet/2/315/AOA0000C307-1149632.pdf> PWR263 Series <https://www.mouser.com/datasheet/2/54/pwr263s_35-778069.pdf> KTR Series <https://www.mouser.com/datasheet/2/348/ROHM_S_A0011075115_1-2563276.pdf> RC Series <https://www.mouser.com/datasheet/2/447/Yageo_03_18_2021_PYu_RC_Group_51_RoHS_L_11-2199992.pdf> ERJ Low Resistance Series <https://www.mouser.com/datasheet/2/315/AOA0000C313-1141758.pdf> ERJ PB3, PB6 Series <https://www.mouser.com/datasheet/2/315/AOA0000C328-1530132.pdf> ERJ UP3, UP6, UP8 Series <https://www.mouser.com/datasheet/2/315/Panasonic_Resistors_Thick_Film_Anti_Sulf_Anti_Surg-1825099.pdf> ERJ PA2, P03, PA3, P06, P08, P14 Series <https://www.mouser.com/datasheet/2/315/AOA0000C331-1141874.pdf> B20 Series <https://www.ohmite.com/assets/docs/res_200.pdf?r=false> TE Connectivity/Holsworthy RN73 Series <https://www.mouser.com/datasheet/2/418/4/NG_DS_1773270_M-604713.pdf> Vishay Dale D/CRCW e3 <https://www.mouser.com/datasheet/2/427/dcrcwe3-1762152.pdf> Ohmite B20 <https://www.ohmite.com/assets/docs/res_200.pdf?r=false>; DKPN: 311-180HRCT-ND; MANUFACTURER: Yageo; MOPN: 603-RC0603FR-07180RL; MPN: RC0603FR-07180RL; POWER: 0.1W; RESISTANCE: 180; TOLERANCE: 1%; VOLTAGE_CONTINUOUS: 4.24V; VOLTAGE_MAX: 75V
R29 R41 R44 R48 R49 = HyTechDevices:RESISTOR_?_*: Resistor PWR163 Series <https://www.mouser.com/datasheet/2/54/pwr163-777985.pdf> AC Series <https://www.mouser.com/datasheet/2/447/Yageo_PYu_AC_51_RoHS_L_7_1714230-1874691.pdf> PU Series <https://www.mouser.com/datasheet/2/447/PYu-PU_51_RoHS_L_6-1504619.pdf> UCR Series <https://fscdn.rohm.com/en/products/databook/datasheet/passive/resistor/chip_resistor/ucr-e.pdf> ERA Series <https://www.mouser.com/datasheet/2/315/AOA0000C307-1149632.pdf> PWR263 Series <https://www.mouser.com/datasheet/2/54/pwr263s_35-778069.pdf> KTR Series <https://www.mouser.com/datasheet/2/348/ROHM_S_A0011075115_1-2563276.pdf> RC Series <https://www.mouser.com/datasheet/2/447/Yageo_03_18_2021_PYu_RC_Group_51_RoHS_L_11-2199992.pdf> ERJ Low Resistance Series <https://www.mouser.com/datasheet/2/315/AOA0000C313-1141758.pdf> ERJ PB3, PB6 Series <https://www.mouser.com/datasheet/2/315/AOA0000C328-1530132.pdf> ERJ UP3, UP6, UP8 Series <https://www.mouser.com/datasheet/2/315/Panasonic_Resistors_Thick_Film_Anti_Sulf_Anti_Surg-1825099.pdf> ERJ PA2, P03, PA3, P06, P08, P14 Series <https://www.mouser.com/datasheet/2/315/AOA0000C331-1141874.pdf> B20 Series <https://www.ohmite.com/assets/docs/res_200.pdf?r=false> TE Connectivity/Holsworthy RN73 Series <https://www.mouser.com/datasheet/2/418/4/NG_DS_1773270_M-604713.pdf> Vishay Dale D/CRCW e3 <https://www.mouser.com/datasheet/2/427/dcrcwe3-1762152.pdf> Ohmite B20 <https://www.ohmite.com/assets/docs/res_200.pdf?r=false>; DKPN: 311-240HRCT-ND; MANUFACTURER: Yageo; MOPN: 603-RC0603FR-07240RL; MPN: RC0603FR-07240RL; POWER: 0.1W; RESISTANCE: 240; TOLERANCE: 1%; VOLTAGE_CONTINUOUS: 4.90V; VOLTAGE_MAX: 75V
R33 R34 R62 = HyTechDevices:RESISTOR_?_*: Resistor PWR163 Series <https://www.mouser.com/datasheet/2/54/pwr163-777985.pdf> AC Series <https://www.mouser.com/datasheet/2/447/Yageo_PYu_AC_51_RoHS_L_7_1714230-1874691.pdf> PU Series <https://www.mouser.com/datasheet/2/447/PYu-PU_51_RoHS_L_6-1504619.pdf> UCR Series <https://fscdn.rohm.com/en/products/databook/datasheet/passive/resistor/chip_resistor/ucr-e.pdf> ERA Series <https://www.mouser.com/datasheet/2/315/AOA0000C307-1149632.pdf> PWR263 Series <https://www.mouser.com/datasheet/2/54/pwr263s_35-778069.pdf> KTR Series <https://www.mouser.com/datasheet/2/348/ROHM_S_A0011075115_1-2563276.pdf> RC Series <https://www.mouser.com/datasheet/2/447/Yageo_03_18_2021_PYu_RC_Group_51_RoHS_L_11-2199992.pdf> ERJ Low Resistance Series <https://www.mouser.com/datasheet/2/315/AOA0000C313-1141758.pdf> ERJ PB3, PB6 Series <https://www.mouser.com/datasheet/2/315/AOA0000C328-1530132.pdf> ERJ UP3, UP6, UP8 Series <https://www.mouser.com/datasheet/2/315/Panasonic_Resistors_Thick_Film_Anti_Sulf_Anti_Surg-1825099.pdf> ERJ PA2, P03, PA3, P06, P08, P14 Series <https://www.mouser.com/datasheet/2/315/AOA0000C331-1141874.pdf> B20 Series <https://www.ohmite.com/assets/docs/res_200.pdf?r=false> TE Connectivity/Holsworthy RN73 Series <https://www.mouser.com/datasheet/2/418/4/NG_DS_1773270_M-604713.pdf> Vishay Dale D/CRCW e3 <https://www.mouser.com/datasheet/2/427/dcrcwe3-1762152.pdf> Ohmite B20 <https://www.ohmite.com/assets/docs/res_200.pdf?r=false>; DKPN: P10.2KDBCT-ND; MANUFACTURER: Panasonic Electronic Components; MOPN: 667-ERA-3AEB1022V; MPN: ERA-3AEB1022V; POWER: 0.1W; RESISTANCE: 10.2k; TOLERANCE: 0.1%; VOLTAGE_CONTINUOUS: 31.94V; VOLTAGE_MAX: 75V
R37 R38 R65 = HyTechDevices:RESISTOR_?_*: Resistor PWR163 Series <https://www.mouser.com/datasheet/2/54/pwr163-777985.pdf> AC Series <https://www.mouser.com/datasheet/2/447/Yageo_PYu_AC_51_RoHS_L_7_1714230-1874691.pdf> PU Series <https://www.mouser.com/datasheet/2/447/PYu-PU_51_RoHS_L_6-1504619.pdf> UCR Series <https://fscdn.rohm.com/en/products/databook/datasheet/passive/resistor/chip_resistor/ucr-e.pdf> ERA Series <https://www.mouser.com/datasheet/2/315/AOA0000C307-1149632.pdf> PWR263 Series <https://www.mouser.com/datasheet/2/54/pwr263s_35-778069.pdf> KTR Series <https://www.mouser.com/datasheet/2/348/ROHM_S_A0011075115_1-2563276.pdf> RC Series <https://www.mouser.com/datasheet/2/447/Yageo_03_18_2021_PYu_RC_Group_51_RoHS_L_11-2199992.pdf> ERJ Low Resistance Series <https://www.mouser.com/datasheet/2/315/AOA0000C313-1141758.pdf> ERJ PB3, PB6 Series <https://www.mouser.com/datasheet/2/315/AOA0000C328-1530132.pdf> ERJ UP3, UP6, UP8 Series <https://www.mouser.com/datasheet/2/315/Panasonic_Resistors_Thick_Film_Anti_Sulf_Anti_Surg-1825099.pdf> ERJ PA2, P03, PA3, P06, P08, P14 Series <https://www.mouser.com/datasheet/2/315/AOA0000C331-1141874.pdf> B20 Series <https://www.ohmite.com/assets/docs/res_200.pdf?r=false> TE Connectivity/Holsworthy RN73 Series <https://www.mouser.com/datasheet/2/418/4/NG_DS_1773270_M-604713.pdf> Vishay Dale D/CRCW e3 <https://www.mouser.com/datasheet/2/427/dcrcwe3-1762152.pdf> Ohmite B20 <https://www.ohmite.com/assets/docs/res_200.pdf?r=false>; DKPN: 311-1.24KHRCT-ND; MANUFACTURER: Yageo; MOPN: 603-RC0603FR-071K24L; MPN: RC0603FR-071K24L; POWER: 0.1W; RESISTANCE: 1.24k; TOLERANCE: 1%; VOLTAGE_CONTINUOUS: 11.14V; VOLTAGE_MAX: 75V
R39 R42 R75 R79 R81-R84 R90 R91 R97 R98 R104 R105 R111 R112 R118 R125 = HyTechDevices:RESISTOR_?_*: Resistor PWR163 Series <https://www.mouser.com/datasheet/2/54/pwr163-777985.pdf> AC Series <https://www.mouser.com/datasheet/2/447/Yageo_PYu_AC_51_RoHS_L_7_1714230-1874691.pdf> PU Series <https://www.mouser.com/datasheet/2/447/PYu-PU_51_RoHS_L_6-1504619.pdf> UCR Series <https://fscdn.rohm.com/en/products/databook/datasheet/passive/resistor/chip_resistor/ucr-e.pdf> ERA Series <https://www.mouser.com/datasheet/2/315/AOA0000C307-1149632.pdf> PWR263 Series <https://www.mouser.com/datasheet/2/54/pwr263s_35-778069.pdf> KTR Series <https://www.mouser.com/datasheet/2/348/ROHM_S_A0011075115_1-2563276.pdf> RC Series <https://www.mouser.com/datasheet/2/447/Yageo_03_18_2021_PYu_RC_Group_51_RoHS_L_11-2199992.pdf> ERJ Low Resistance Series <https://www.mouser.com/datasheet/2/315/AOA0000C313-1141758.pdf> ERJ PB3, PB6 Series <https://www.mouser.com/datasheet/2/315/AOA0000C328-1530132.pdf> ERJ UP3, UP6, UP8 Series <https://www.mouser.com/datasheet/2/315/Panasonic_Resistors_Thick_Film_Anti_Sulf_Anti_Surg-1825099.pdf> ERJ PA2, P03, PA3, P06, P08, P14 Series <https://www.mouser.com/datasheet/2/315/AOA0000C331-1141874.pdf> B20 Series <https://www.ohmite.com/assets/docs/res_200.pdf?r=false> TE Connectivity/Holsworthy RN73 Series <https://www.mouser.com/datasheet/2/418/4/NG_DS_1773270_M-604713.pdf> Vishay Dale D/CRCW e3 <https://www.mouser.com/datasheet/2/427/dcrcwe3-1762152.pdf> Ohmite B20 <https://www.ohmite.com/assets/docs/res_200.pdf?r=false>; DKPN: 311-12.0KHRCT-ND; MANUFACTURER: Yageo; MOPN: 603-RC0603FR-0712KL; MPN: RC0603FR-0712KL; POWER: 0.1W; RESISTANCE: 12k; TOLERANCE: 1%; VOLTAGE_CONTINUOUS: 34.64V; VOLTAGE_MAX: 75V
R40 R43 R76 R80 R85 R86 R92 R93 R99 R100 R106 R107 R113 R114 R119 R120 R124 R126 = HyTechDevices:RESISTOR_?_*: Resistor PWR163 Series <https://www.mouser.com/datasheet/2/54/pwr163-777985.pdf> AC Series <https://www.mouser.com/datasheet/2/447/Yageo_PYu_AC_51_RoHS_L_7_1714230-1874691.pdf> PU Series <https://www.mouser.com/datasheet/2/447/PYu-PU_51_RoHS_L_6-1504619.pdf> UCR Series <https://fscdn.rohm.com/en/products/databook/datasheet/passive/resistor/chip_resistor/ucr-e.pdf> ERA Series <https://www.mouser.com/datasheet/2/315/AOA0000C307-1149632.pdf> PWR263 Series <https://www.mouser.com/datasheet/2/54/pwr263s_35-778069.pdf> KTR Series <https://www.mouser.com/datasheet/2/348/ROHM_S_A0011075115_1-2563276.pdf> RC Series <https://www.mouser.com/datasheet/2/447/Yageo_03_18_2021_PYu_RC_Group_51_RoHS_L_11-2199992.pdf> ERJ Low Resistance Series <https://www.mouser.com/datasheet/2/315/AOA0000C313-1141758.pdf> ERJ PB3, PB6 Series <https://www.mouser.com/datasheet/2/315/AOA0000C328-1530132.pdf> ERJ UP3, UP6, UP8 Series <https://www.mouser.com/datasheet/2/315/Panasonic_Resistors_Thick_Film_Anti_Sulf_Anti_Surg-1825099.pdf> ERJ PA2, P03, PA3, P06, P08, P14 Series <https://www.mouser.com/datasheet/2/315/AOA0000C331-1141874.pdf> B20 Series <https://www.ohmite.com/assets/docs/res_200.pdf?r=false> TE Connectivity/Holsworthy RN73 Series <https://www.mouser.com/datasheet/2/418/4/NG_DS_1773270_M-604713.pdf> Vishay Dale D/CRCW e3 <https://www.mouser.com/datasheet/2/427/dcrcwe3-1762152.pdf> Ohmite B20 <https://www.ohmite.com/assets/docs/res_200.pdf?r=false>; DKPN: P20072CT-ND; MANUFACTURER: Panasonic Electronic Components; MOPN: 667-ERJ-PB3B7501V; MPN: ERJ-PB3B7501V; POWER: 0.2W; RESISTANCE: 7.5k; TOLERANCE: 0.1%; VOLTAGE_CONTINUOUS: 38.73V; VOLTAGE_MAX: 150V
R45 R51 = HyTechDevices:RESISTOR_?_*: Resistor PWR163 Series <https://www.mouser.com/datasheet/2/54/pwr163-777985.pdf> AC Series <https://www.mouser.com/datasheet/2/447/Yageo_PYu_AC_51_RoHS_L_7_1714230-1874691.pdf> PU Series <https://www.mouser.com/datasheet/2/447/PYu-PU_51_RoHS_L_6-1504619.pdf> UCR Series <https://fscdn.rohm.com/en/products/databook/datasheet/passive/resistor/chip_resistor/ucr-e.pdf> ERA Series <https://www.mouser.com/datasheet/2/315/AOA0000C307-1149632.pdf> PWR263 Series <https://www.mouser.com/datasheet/2/54/pwr263s_35-778069.pdf> KTR Series <https://www.mouser.com/datasheet/2/348/ROHM_S_A0011075115_1-2563276.pdf> RC Series <https://www.mouser.com/datasheet/2/447/Yageo_03_18_2021_PYu_RC_Group_51_RoHS_L_11-2199992.pdf> ERJ Low Resistance Series <https://www.mouser.com/datasheet/2/315/AOA0000C313-1141758.pdf> ERJ PB3, PB6 Series <https://www.mouser.com/datasheet/2/315/AOA0000C328-1530132.pdf> ERJ UP3, UP6, UP8 Series <https://www.mouser.com/datasheet/2/315/Panasonic_Resistors_Thick_Film_Anti_Sulf_Anti_Surg-1825099.pdf> ERJ PA2, P03, PA3, P06, P08, P14 Series <https://www.mouser.com/datasheet/2/315/AOA0000C331-1141874.pdf> B20 Series <https://www.ohmite.com/assets/docs/res_200.pdf?r=false> TE Connectivity/Holsworthy RN73 Series <https://www.mouser.com/datasheet/2/418/4/NG_DS_1773270_M-604713.pdf> Vishay Dale D/CRCW e3 <https://www.mouser.com/datasheet/2/427/dcrcwe3-1762152.pdf> Ohmite B20 <https://www.ohmite.com/assets/docs/res_200.pdf?r=false>; DKPN: 311-43.0KHRCT-ND; MANUFACTURER: Yageo; MOPN: 603-RC0603FR-0743KL; MPN: RC0603FR-0743KL; POWER: 0.1W; RESISTANCE: 43k; TOLERANCE: 1%; VOLTAGE_CONTINUOUS: 65.57V; VOLTAGE_MAX: 75V
R46 R50 = HyTechDevices:RESISTOR_?_*: Resistor PWR163 Series <https://www.mouser.com/datasheet/2/54/pwr163-777985.pdf> AC Series <https://www.mouser.com/datasheet/2/447/Yageo_PYu_AC_51_RoHS_L_7_1714230-1874691.pdf> PU Series <https://www.mouser.com/datasheet/2/447/PYu-PU_51_RoHS_L_6-1504619.pdf> UCR Series <https://fscdn.rohm.com/en/products/databook/datasheet/passive/resistor/chip_resistor/ucr-e.pdf> ERA Series <https://www.mouser.com/datasheet/2/315/AOA0000C307-1149632.pdf> PWR263 Series <https://www.mouser.com/datasheet/2/54/pwr263s_35-778069.pdf> KTR Series <https://www.mouser.com/datasheet/2/348/ROHM_S_A0011075115_1-2563276.pdf> RC Series <https://www.mouser.com/datasheet/2/447/Yageo_03_18_2021_PYu_RC_Group_51_RoHS_L_11-2199992.pdf> ERJ Low Resistance Series <https://www.mouser.com/datasheet/2/315/AOA0000C313-1141758.pdf> ERJ PB3, PB6 Series <https://www.mouser.com/datasheet/2/315/AOA0000C328-1530132.pdf> ERJ UP3, UP6, UP8 Series <https://www.mouser.com/datasheet/2/315/Panasonic_Resistors_Thick_Film_Anti_Sulf_Anti_Surg-1825099.pdf> ERJ PA2, P03, PA3, P06, P08, P14 Series <https://www.mouser.com/datasheet/2/315/AOA0000C331-1141874.pdf> B20 Series <https://www.ohmite.com/assets/docs/res_200.pdf?r=false> TE Connectivity/Holsworthy RN73 Series <https://www.mouser.com/datasheet/2/418/4/NG_DS_1773270_M-604713.pdf> Vishay Dale D/CRCW e3 <https://www.mouser.com/datasheet/2/427/dcrcwe3-1762152.pdf> Ohmite B20 <https://www.ohmite.com/assets/docs/res_200.pdf?r=false>; DKPN: 1712-CPF-A-0603B1K0ETR-ND; MANUFACTURER: TE Connectivity Passive Product; MOPN: 279-CPF-A-0603B1K0E; MPN: CPF-A-0603B1K0E; POWER: 0.0625W; RESISTANCE: 1k; TOLERANCE: 0.1%; VOLTAGE_CONTINUOUS: 7.9V; VOLTAGE_MAX: 50V
R47 R52 R141 R142 = HyTechDevices:RESISTOR_?_*: Resistor PWR163 Series <https://www.mouser.com/datasheet/2/54/pwr163-777985.pdf> AC Series <https://www.mouser.com/datasheet/2/447/Yageo_PYu_AC_51_RoHS_L_7_1714230-1874691.pdf> PU Series <https://www.mouser.com/datasheet/2/447/PYu-PU_51_RoHS_L_6-1504619.pdf> UCR Series <https://fscdn.rohm.com/en/products/databook/datasheet/passive/resistor/chip_resistor/ucr-e.pdf> ERA Series <https://www.mouser.com/datasheet/2/315/AOA0000C307-1149632.pdf> PWR263 Series <https://www.mouser.com/datasheet/2/54/pwr263s_35-778069.pdf> KTR Series <https://www.mouser.com/datasheet/2/348/ROHM_S_A0011075115_1-2563276.pdf> RC Series <https://www.mouser.com/datasheet/2/447/Yageo_03_18_2021_PYu_RC_Group_51_RoHS_L_11-2199992.pdf> ERJ Low Resistance Series <https://www.mouser.com/datasheet/2/315/AOA0000C313-1141758.pdf> ERJ PB3, PB6 Series <https://www.mouser.com/datasheet/2/315/AOA0000C328-1530132.pdf> ERJ UP3, UP6, UP8 Series <https://www.mouser.com/datasheet/2/315/Panasonic_Resistors_Thick_Film_Anti_Sulf_Anti_Surg-1825099.pdf> ERJ PA2, P03, PA3, P06, P08, P14 Series <https://www.mouser.com/datasheet/2/315/AOA0000C331-1141874.pdf> B20 Series <https://www.ohmite.com/assets/docs/res_200.pdf?r=false> TE Connectivity/Holsworthy RN73 Series <https://www.mouser.com/datasheet/2/418/4/NG_DS_1773270_M-604713.pdf> Vishay Dale D/CRCW e3 <https://www.mouser.com/datasheet/2/427/dcrcwe3-1762152.pdf> Ohmite B20 <https://www.ohmite.com/assets/docs/res_200.pdf?r=false>; DKPN: 311-60.4HRCT-ND; MANUFACTURER: Yageo; MOPN: 603-RC0603FR-0760R4L; MPN: RC0603FR-0760R4L; POWER: 0.1W; RESISTANCE: 60.4; TOLERANCE: 1%; VOLTAGE_CONTINUOUS: 2.48V; VOLTAGE_MAX: 75V
R53 = HyTechDevices:RESISTOR_?_*: Resistor PWR163 Series <https://www.mouser.com/datasheet/2/54/pwr163-777985.pdf> AC Series <https://www.mouser.com/datasheet/2/447/Yageo_PYu_AC_51_RoHS_L_7_1714230-1874691.pdf> PU Series <https://www.mouser.com/datasheet/2/447/PYu-PU_51_RoHS_L_6-1504619.pdf> UCR Series <https://fscdn.rohm.com/en/products/databook/datasheet/passive/resistor/chip_resistor/ucr-e.pdf> ERA Series <https://www.mouser.com/datasheet/2/315/AOA0000C307-1149632.pdf> PWR263 Series <https://www.mouser.com/datasheet/2/54/pwr263s_35-778069.pdf> KTR Series <https://www.mouser.com/datasheet/2/348/ROHM_S_A0011075115_1-2563276.pdf> RC Series <https://www.mouser.com/datasheet/2/447/Yageo_03_18_2021_PYu_RC_Group_51_RoHS_L_11-2199992.pdf> ERJ Low Resistance Series <https://www.mouser.com/datasheet/2/315/AOA0000C313-1141758.pdf> ERJ PB3, PB6 Series <https://www.mouser.com/datasheet/2/315/AOA0000C328-1530132.pdf> ERJ UP3, UP6, UP8 Series <https://www.mouser.com/datasheet/2/315/Panasonic_Resistors_Thick_Film_Anti_Sulf_Anti_Surg-1825099.pdf> ERJ PA2, P03, PA3, P06, P08, P14 Series <https://www.mouser.com/datasheet/2/315/AOA0000C331-1141874.pdf> B20 Series <https://www.ohmite.com/assets/docs/res_200.pdf?r=false> TE Connectivity/Holsworthy RN73 Series <https://www.mouser.com/datasheet/2/418/4/NG_DS_1773270_M-604713.pdf> Vishay Dale D/CRCW e3 <https://www.mouser.com/datasheet/2/427/dcrcwe3-1762152.pdf> Ohmite B20 <https://www.ohmite.com/assets/docs/res_200.pdf?r=false>; DKPN: RT0603BRB0714KL-ND; MANUFACTURER: YAGEO; MOPN: 603-RT0603BRB0714KL; MPN: RT0603BRB0714KL; POWER: 0.1W; RESISTANCE: 14k; TOLERANCE: 0.1%; VOLTAGE_CONTINUOUS: 37.4V; VOLTAGE_MAX: 75V
R56 R78 = HyTechDevices:RESISTOR_?_*: Resistor PWR163 Series <https://www.mouser.com/datasheet/2/54/pwr163-777985.pdf> AC Series <https://www.mouser.com/datasheet/2/447/Yageo_PYu_AC_51_RoHS_L_7_1714230-1874691.pdf> PU Series <https://www.mouser.com/datasheet/2/447/PYu-PU_51_RoHS_L_6-1504619.pdf> UCR Series <https://fscdn.rohm.com/en/products/databook/datasheet/passive/resistor/chip_resistor/ucr-e.pdf> ERA Series <https://www.mouser.com/datasheet/2/315/AOA0000C307-1149632.pdf> PWR263 Series <https://www.mouser.com/datasheet/2/54/pwr263s_35-778069.pdf> KTR Series <https://www.mouser.com/datasheet/2/348/ROHM_S_A0011075115_1-2563276.pdf> RC Series <https://www.mouser.com/datasheet/2/447/Yageo_03_18_2021_PYu_RC_Group_51_RoHS_L_11-2199992.pdf> ERJ Low Resistance Series <https://www.mouser.com/datasheet/2/315/AOA0000C313-1141758.pdf> ERJ PB3, PB6 Series <https://www.mouser.com/datasheet/2/315/AOA0000C328-1530132.pdf> ERJ UP3, UP6, UP8 Series <https://www.mouser.com/datasheet/2/315/Panasonic_Resistors_Thick_Film_Anti_Sulf_Anti_Surg-1825099.pdf> ERJ PA2, P03, PA3, P06, P08, P14 Series <https://www.mouser.com/datasheet/2/315/AOA0000C331-1141874.pdf> B20 Series <https://www.ohmite.com/assets/docs/res_200.pdf?r=false> TE Connectivity/Holsworthy RN73 Series <https://www.mouser.com/datasheet/2/418/4/NG_DS_1773270_M-604713.pdf> Vishay Dale D/CRCW e3 <https://www.mouser.com/datasheet/2/427/dcrcwe3-1762152.pdf> Ohmite B20 <https://www.ohmite.com/assets/docs/res_200.pdf?r=false>; DKPN: P20020CT-ND; MANUFACTURER: Panasonic Electronic Components; MOPN: 667-ERJ-PB3B2741V; MPN: ERJ-PB3B2741V; POWER: 0.2W; RESISTANCE: 2.74k; TOLERANCE: 0.1%; VOLTAGE_CONTINUOUS: 23.41V; VOLTAGE_MAX: 150V
R63 R64 = HyTechDevices:RESISTOR_?_*: Resistor PWR163 Series <https://www.mouser.com/datasheet/2/54/pwr163-777985.pdf> AC Series <https://www.mouser.com/datasheet/2/447/Yageo_PYu_AC_51_RoHS_L_7_1714230-1874691.pdf> PU Series <https://www.mouser.com/datasheet/2/447/PYu-PU_51_RoHS_L_6-1504619.pdf> UCR Series <https://fscdn.rohm.com/en/products/databook/datasheet/passive/resistor/chip_resistor/ucr-e.pdf> ERA Series <https://www.mouser.com/datasheet/2/315/AOA0000C307-1149632.pdf> PWR263 Series <https://www.mouser.com/datasheet/2/54/pwr263s_35-778069.pdf> KTR Series <https://www.mouser.com/datasheet/2/348/ROHM_S_A0011075115_1-2563276.pdf> RC Series <https://www.mouser.com/datasheet/2/447/Yageo_03_18_2021_PYu_RC_Group_51_RoHS_L_11-2199992.pdf> ERJ Low Resistance Series <https://www.mouser.com/datasheet/2/315/AOA0000C313-1141758.pdf> ERJ PB3, PB6 Series <https://www.mouser.com/datasheet/2/315/AOA0000C328-1530132.pdf> ERJ UP3, UP6, UP8 Series <https://www.mouser.com/datasheet/2/315/Panasonic_Resistors_Thick_Film_Anti_Sulf_Anti_Surg-1825099.pdf> ERJ PA2, P03, PA3, P06, P08, P14 Series <https://www.mouser.com/datasheet/2/315/AOA0000C331-1141874.pdf> B20 Series <https://www.ohmite.com/assets/docs/res_200.pdf?r=false> TE Connectivity/Holsworthy RN73 Series <https://www.mouser.com/datasheet/2/418/4/NG_DS_1773270_M-604713.pdf> Vishay Dale D/CRCW e3 <https://www.mouser.com/datasheet/2/427/dcrcwe3-1762152.pdf> Ohmite B20 <https://www.ohmite.com/assets/docs/res_200.pdf?r=false>; DKPN: P1.13KHCT-ND; MANUFACTURER: Panasonic Electronic Components; MOPN: 667-ERJ-3EKF1131V; MPN: ERJ-3EKF1131V; POWER: 0.1W; RESISTANCE: 1.13k; TOLERANCE: 1%; VOLTAGE_CONTINUOUS: 75V; VOLTAGE_MAX: 150V
R66 = HyTechDevices:RESISTOR_?_*: Resistor PWR163 Series <https://www.mouser.com/datasheet/2/54/pwr163-777985.pdf> AC Series <https://www.mouser.com/datasheet/2/447/Yageo_PYu_AC_51_RoHS_L_7_1714230-1874691.pdf> PU Series <https://www.mouser.com/datasheet/2/447/PYu-PU_51_RoHS_L_6-1504619.pdf> UCR Series <https://fscdn.rohm.com/en/products/databook/datasheet/passive/resistor/chip_resistor/ucr-e.pdf> ERA Series <https://www.mouser.com/datasheet/2/315/AOA0000C307-1149632.pdf> PWR263 Series <https://www.mouser.com/datasheet/2/54/pwr263s_35-778069.pdf> KTR Series <https://www.mouser.com/datasheet/2/348/ROHM_S_A0011075115_1-2563276.pdf> RC Series <https://www.mouser.com/datasheet/2/447/Yageo_03_18_2021_PYu_RC_Group_51_RoHS_L_11-2199992.pdf> ERJ Low Resistance Series <https://www.mouser.com/datasheet/2/315/AOA0000C313-1141758.pdf> ERJ PB3, PB6 Series <https://www.mouser.com/datasheet/2/315/AOA0000C328-1530132.pdf> ERJ UP3, UP6, UP8 Series <https://www.mouser.com/datasheet/2/315/Panasonic_Resistors_Thick_Film_Anti_Sulf_Anti_Surg-1825099.pdf> ERJ PA2, P03, PA3, P06, P08, P14 Series <https://www.mouser.com/datasheet/2/315/AOA0000C331-1141874.pdf> B20 Series <https://www.ohmite.com/assets/docs/res_200.pdf?r=false> TE Connectivity/Holsworthy RN73 Series <https://www.mouser.com/datasheet/2/418/4/NG_DS_1773270_M-604713.pdf> Vishay Dale D/CRCW e3 <https://www.mouser.com/datasheet/2/427/dcrcwe3-1762152.pdf> Ohmite B20 <https://www.ohmite.com/assets/docs/res_200.pdf?r=false>; DKPN: 311-2.55KHRCT-ND; MANUFACTURER: Yageo; MOPN: 603-RC0603FR-072K55L; MPN: RC0603FR-072K55L; POWER: 0.1W; RESISTANCE: 2.55k; TOLERANCE: 1%; VOLTAGE_CONTINUOUS: 15.97V; VOLTAGE_MAX: 75V
R68 = HyTechDevices:RESISTOR_?_*: Resistor PWR163 Series <https://www.mouser.com/datasheet/2/54/pwr163-777985.pdf> AC Series <https://www.mouser.com/datasheet/2/447/Yageo_PYu_AC_51_RoHS_L_7_1714230-1874691.pdf> PU Series <https://www.mouser.com/datasheet/2/447/PYu-PU_51_RoHS_L_6-1504619.pdf> UCR Series <https://fscdn.rohm.com/en/products/databook/datasheet/passive/resistor/chip_resistor/ucr-e.pdf> ERA Series <https://www.mouser.com/datasheet/2/315/AOA0000C307-1149632.pdf> PWR263 Series <https://www.mouser.com/datasheet/2/54/pwr263s_35-778069.pdf> KTR Series <https://www.mouser.com/datasheet/2/348/ROHM_S_A0011075115_1-2563276.pdf> RC Series <https://www.mouser.com/datasheet/2/447/Yageo_03_18_2021_PYu_RC_Group_51_RoHS_L_11-2199992.pdf> ERJ Low Resistance Series <https://www.mouser.com/datasheet/2/315/AOA0000C313-1141758.pdf> ERJ PB3, PB6 Series <https://www.mouser.com/datasheet/2/315/AOA0000C328-1530132.pdf> ERJ UP3, UP6, UP8 Series <https://www.mouser.com/datasheet/2/315/Panasonic_Resistors_Thick_Film_Anti_Sulf_Anti_Surg-1825099.pdf> ERJ PA2, P03, PA3, P06, P08, P14 Series <https://www.mouser.com/datasheet/2/315/AOA0000C331-1141874.pdf> B20 Series <https://www.ohmite.com/assets/docs/res_200.pdf?r=false> TE Connectivity/Holsworthy RN73 Series <https://www.mouser.com/datasheet/2/418/4/NG_DS_1773270_M-604713.pdf> Vishay Dale D/CRCW e3 <https://www.mouser.com/datasheet/2/427/dcrcwe3-1762152.pdf> Ohmite B20 <https://www.ohmite.com/assets/docs/res_200.pdf?r=false>; DKPN: 13-RT0805BRD072K18LTR-ND; MANUFACTURER: YAGEO; MOPN: 603-RT0805BRD072K18L; MPN: RT0805BRD072K18L; POWER: 0.125W; RESISTANCE: 2.18k; TOLERANCE: 0.1%; VOLTAGE_CONTINUOUS: 16.51V; VOLTAGE_MAX: 150V
R70 = HyTechDevices:RESISTOR_?_*: Resistor PWR163 Series <https://www.mouser.com/datasheet/2/54/pwr163-777985.pdf> AC Series <https://www.mouser.com/datasheet/2/447/Yageo_PYu_AC_51_RoHS_L_7_1714230-1874691.pdf> PU Series <https://www.mouser.com/datasheet/2/447/PYu-PU_51_RoHS_L_6-1504619.pdf> UCR Series <https://fscdn.rohm.com/en/products/databook/datasheet/passive/resistor/chip_resistor/ucr-e.pdf> ERA Series <https://www.mouser.com/datasheet/2/315/AOA0000C307-1149632.pdf> PWR263 Series <https://www.mouser.com/datasheet/2/54/pwr263s_35-778069.pdf> KTR Series <https://www.mouser.com/datasheet/2/348/ROHM_S_A0011075115_1-2563276.pdf> RC Series <https://www.mouser.com/datasheet/2/447/Yageo_03_18_2021_PYu_RC_Group_51_RoHS_L_11-2199992.pdf> ERJ Low Resistance Series <https://www.mouser.com/datasheet/2/315/AOA0000C313-1141758.pdf> ERJ PB3, PB6 Series <https://www.mouser.com/datasheet/2/315/AOA0000C328-1530132.pdf> ERJ UP3, UP6, UP8 Series <https://www.mouser.com/datasheet/2/315/Panasonic_Resistors_Thick_Film_Anti_Sulf_Anti_Surg-1825099.pdf> ERJ PA2, P03, PA3, P06, P08, P14 Series <https://www.mouser.com/datasheet/2/315/AOA0000C331-1141874.pdf> B20 Series <https://www.ohmite.com/assets/docs/res_200.pdf?r=false> TE Connectivity/Holsworthy RN73 Series <https://www.mouser.com/datasheet/2/418/4/NG_DS_1773270_M-604713.pdf> Vishay Dale D/CRCW e3 <https://www.mouser.com/datasheet/2/427/dcrcwe3-1762152.pdf> Ohmite B20 <https://www.ohmite.com/assets/docs/res_200.pdf?r=false>; RESISTANCE: DNP
R71 R72 = HyTechDevices:RESISTOR_?_*: Resistor PWR163 Series <https://www.mouser.com/datasheet/2/54/pwr163-777985.pdf> AC Series <https://www.mouser.com/datasheet/2/447/Yageo_PYu_AC_51_RoHS_L_7_1714230-1874691.pdf> PU Series <https://www.mouser.com/datasheet/2/447/PYu-PU_51_RoHS_L_6-1504619.pdf> UCR Series <https://fscdn.rohm.com/en/products/databook/datasheet/passive/resistor/chip_resistor/ucr-e.pdf> ERA Series <https://www.mouser.com/datasheet/2/315/AOA0000C307-1149632.pdf> PWR263 Series <https://www.mouser.com/datasheet/2/54/pwr263s_35-778069.pdf> KTR Series <https://www.mouser.com/datasheet/2/348/ROHM_S_A0011075115_1-2563276.pdf> RC Series <https://www.mouser.com/datasheet/2/447/Yageo_03_18_2021_PYu_RC_Group_51_RoHS_L_11-2199992.pdf> ERJ Low Resistance Series <https://www.mouser.com/datasheet/2/315/AOA0000C313-1141758.pdf> ERJ PB3, PB6 Series <https://www.mouser.com/datasheet/2/315/AOA0000C328-1530132.pdf> ERJ UP3, UP6, UP8 Series <https://www.mouser.com/datasheet/2/315/Panasonic_Resistors_Thick_Film_Anti_Sulf_Anti_Surg-1825099.pdf> ERJ PA2, P03, PA3, P06, P08, P14 Series <https://www.mouser.com/datasheet/2/315/AOA0000C331-1141874.pdf> B20 Series <https://www.ohmite.com/assets/docs/res_200.pdf?r=false> TE Connectivity/Holsworthy RN73 Series <https://www.mouser.com/datasheet/2/418/4/NG_DS_1773270_M-604713.pdf> Vishay Dale D/CRCW e3 <https://www.mouser.com/datasheet/2/427/dcrcwe3-1762152.pdf> Ohmite B20 <https://www.ohmite.com/assets/docs/res_200.pdf?r=false>; DKPN: 311-18.7KHRCT-ND; MANUFACTURER: Yageo; MOPN: 603-RC0603FR-0718K7L; MPN: RC0603FR-0718K7L; POWER: 0.1W; RESISTANCE: 18.7k; TOLERANCE: 1%; VOLTAGE_CONTINUOUS: 43.24V; VOLTAGE_MAX: 75V
R87 R94 R101 R108 R115 R121 = HyTechDevices:RESISTOR_?_*: Resistor PWR163 Series <https://www.mouser.com/datasheet/2/54/pwr163-777985.pdf> AC Series <https://www.mouser.com/datasheet/2/447/Yageo_PYu_AC_51_RoHS_L_7_1714230-1874691.pdf> PU Series <https://www.mouser.com/datasheet/2/447/PYu-PU_51_RoHS_L_6-1504619.pdf> UCR Series <https://fscdn.rohm.com/en/products/databook/datasheet/passive/resistor/chip_resistor/ucr-e.pdf> ERA Series <https://www.mouser.com/datasheet/2/315/AOA0000C307-1149632.pdf> PWR263 Series <https://www.mouser.com/datasheet/2/54/pwr263s_35-778069.pdf> KTR Series <https://www.mouser.com/datasheet/2/348/ROHM_S_A0011075115_1-2563276.pdf> RC Series <https://www.mouser.com/datasheet/2/447/Yageo_03_18_2021_PYu_RC_Group_51_RoHS_L_11-2199992.pdf> ERJ Low Resistance Series <https://www.mouser.com/datasheet/2/315/AOA0000C313-1141758.pdf> ERJ PB3, PB6 Series <https://www.mouser.com/datasheet/2/315/AOA0000C328-1530132.pdf> ERJ UP3, UP6, UP8 Series <https://www.mouser.com/datasheet/2/315/Panasonic_Resistors_Thick_Film_Anti_Sulf_Anti_Surg-1825099.pdf> ERJ PA2, P03, PA3, P06, P08, P14 Series <https://www.mouser.com/datasheet/2/315/AOA0000C331-1141874.pdf> B20 Series <https://www.ohmite.com/assets/docs/res_200.pdf?r=false> TE Connectivity/Holsworthy RN73 Series <https://www.mouser.com/datasheet/2/418/4/NG_DS_1773270_M-604713.pdf> Vishay Dale D/CRCW e3 <https://www.mouser.com/datasheet/2/427/dcrcwe3-1762152.pdf> Ohmite B20 <https://www.ohmite.com/assets/docs/res_200.pdf?r=false>; DKPN: P30KBDCT-ND; MANUFACTURER: Panasonic Electronic Components; MOPN: 667-ERA-3ARB303V; MPN: ERA-3ARB303V; POWER: 0.1W; RESISTANCE: 30k; TOLERANCE: 0.1%; VOLTAGE_CONTINUOUS: 54.77V; VOLTAGE_MAX: 75V
R89 R96 R103 R110 R117 R123 = HyTechDevices:RESISTOR_?_*: Resistor PWR163 Series <https://www.mouser.com/datasheet/2/54/pwr163-777985.pdf> AC Series <https://www.mouser.com/datasheet/2/447/Yageo_PYu_AC_51_RoHS_L_7_1714230-1874691.pdf> PU Series <https://www.mouser.com/datasheet/2/447/PYu-PU_51_RoHS_L_6-1504619.pdf> UCR Series <https://fscdn.rohm.com/en/products/databook/datasheet/passive/resistor/chip_resistor/ucr-e.pdf> ERA Series <https://www.mouser.com/datasheet/2/315/AOA0000C307-1149632.pdf> PWR263 Series <https://www.mouser.com/datasheet/2/54/pwr263s_35-778069.pdf> KTR Series <https://www.mouser.com/datasheet/2/348/ROHM_S_A0011075115_1-2563276.pdf> RC Series <https://www.mouser.com/datasheet/2/447/Yageo_03_18_2021_PYu_RC_Group_51_RoHS_L_11-2199992.pdf> ERJ Low Resistance Series <https://www.mouser.com/datasheet/2/315/AOA0000C313-1141758.pdf> ERJ PB3, PB6 Series <https://www.mouser.com/datasheet/2/315/AOA0000C328-1530132.pdf> ERJ UP3, UP6, UP8 Series <https://www.mouser.com/datasheet/2/315/Panasonic_Resistors_Thick_Film_Anti_Sulf_Anti_Surg-1825099.pdf> ERJ PA2, P03, PA3, P06, P08, P14 Series <https://www.mouser.com/datasheet/2/315/AOA0000C331-1141874.pdf> B20 Series <https://www.ohmite.com/assets/docs/res_200.pdf?r=false> TE Connectivity/Holsworthy RN73 Series <https://www.mouser.com/datasheet/2/418/4/NG_DS_1773270_M-604713.pdf> Vishay Dale D/CRCW e3 <https://www.mouser.com/datasheet/2/427/dcrcwe3-1762152.pdf> Ohmite B20 <https://www.ohmite.com/assets/docs/res_200.pdf?r=false>; DKPN: P15KBDCT-ND; MANUFACTURER: Panasonic Electronic Components; MOPN: 667-ERA-3ARB153V; MPN: ERA-3ARB153V; POWER: 0.1W; RESISTANCE: 15k; TOLERANCE: 0.1%; VOLTAGE_CONTINUOUS: 38.73V; VOLTAGE_MAX: 75V
R127 = HyTechDevices:RESISTOR_?_*: Resistor PWR163 Series <https://www.mouser.com/datasheet/2/54/pwr163-777985.pdf> AC Series <https://www.mouser.com/datasheet/2/447/Yageo_PYu_AC_51_RoHS_L_7_1714230-1874691.pdf> PU Series <https://www.mouser.com/datasheet/2/447/PYu-PU_51_RoHS_L_6-1504619.pdf> UCR Series <https://fscdn.rohm.com/en/products/databook/datasheet/passive/resistor/chip_resistor/ucr-e.pdf> ERA Series <https://www.mouser.com/datasheet/2/315/AOA0000C307-1149632.pdf> PWR263 Series <https://www.mouser.com/datasheet/2/54/pwr263s_35-778069.pdf> KTR Series <https://www.mouser.com/datasheet/2/348/ROHM_S_A0011075115_1-2563276.pdf> RC Series <https://www.mouser.com/datasheet/2/447/Yageo_03_18_2021_PYu_RC_Group_51_RoHS_L_11-2199992.pdf> ERJ Low Resistance Series <https://www.mouser.com/datasheet/2/315/AOA0000C313-1141758.pdf> ERJ PB3, PB6 Series <https://www.mouser.com/datasheet/2/315/AOA0000C328-1530132.pdf> ERJ UP3, UP6, UP8 Series <https://www.mouser.com/datasheet/2/315/Panasonic_Resistors_Thick_Film_Anti_Sulf_Anti_Surg-1825099.pdf> ERJ PA2, P03, PA3, P06, P08, P14 Series <https://www.mouser.com/datasheet/2/315/AOA0000C331-1141874.pdf> B20 Series <https://www.ohmite.com/assets/docs/res_200.pdf?r=false> TE Connectivity/Holsworthy RN73 Series <https://www.mouser.com/datasheet/2/418/4/NG_DS_1773270_M-604713.pdf> Vishay Dale D/CRCW e3 <https://www.mouser.com/datasheet/2/427/dcrcwe3-1762152.pdf> Ohmite B20 <https://www.ohmite.com/assets/docs/res_200.pdf?r=false>; DKPN: 311-100KHRTR-ND; MANUFACTURER: Yageo; MOPN: 603-RC0603FR-07100KL; MPN: RC0603FR-07100KL; POWER: 0.1W; RESISTANCE: 100k; TOLERANCE: 1%; VOLTAGE_CONTINUOUS: 75V; VOLTAGE_MAX: 75V
R128-R130 R150 = HyTechDevices:RESISTOR_?_*: Resistor PWR163 Series <https://www.mouser.com/datasheet/2/54/pwr163-777985.pdf> AC Series <https://www.mouser.com/datasheet/2/447/Yageo_PYu_AC_51_RoHS_L_7_1714230-1874691.pdf> PU Series <https://www.mouser.com/datasheet/2/447/PYu-PU_51_RoHS_L_6-1504619.pdf> UCR Series <https://fscdn.rohm.com/en/products/databook/datasheet/passive/resistor/chip_resistor/ucr-e.pdf> ERA Series <https://www.mouser.com/datasheet/2/315/AOA0000C307-1149632.pdf> PWR263 Series <https://www.mouser.com/datasheet/2/54/pwr263s_35-778069.pdf> KTR Series <https://www.mouser.com/datasheet/2/348/ROHM_S_A0011075115_1-2563276.pdf> RC Series <https://www.mouser.com/datasheet/2/447/Yageo_03_18_2021_PYu_RC_Group_51_RoHS_L_11-2199992.pdf> ERJ Low Resistance Series <https://www.mouser.com/datasheet/2/315/AOA0000C313-1141758.pdf> ERJ PB3, PB6 Series <https://www.mouser.com/datasheet/2/315/AOA0000C328-1530132.pdf> ERJ UP3, UP6, UP8 Series <https://www.mouser.com/datasheet/2/315/Panasonic_Resistors_Thick_Film_Anti_Sulf_Anti_Surg-1825099.pdf> ERJ PA2, P03, PA3, P06, P08, P14 Series <https://www.mouser.com/datasheet/2/315/AOA0000C331-1141874.pdf> B20 Series <https://www.ohmite.com/assets/docs/res_200.pdf?r=false> TE Connectivity/Holsworthy RN73 Series <https://www.mouser.com/datasheet/2/418/4/NG_DS_1773270_M-604713.pdf> Vishay Dale D/CRCW e3 <https://www.mouser.com/datasheet/2/427/dcrcwe3-1762152.pdf> Ohmite B20 <https://www.ohmite.com/assets/docs/res_200.pdf?r=false>; DKPN: 311-20.0KHRTR-ND; MANUFACTURER: Yageo; MOPN: 603-RC0603FR-0720KL; MPN: RC0603FR-0720KL; POWER: 0.1 W; RESISTANCE: 20k; TOLERANCE: 1%; VOLTAGE_CONTINUOUS: 44.72V; VOLTAGE_MAX: 75V
R131 R132 = HyTechDevices:RESISTOR_?_*: Resistor PWR163 Series <https://www.mouser.com/datasheet/2/54/pwr163-777985.pdf> AC Series <https://www.mouser.com/datasheet/2/447/Yageo_PYu_AC_51_RoHS_L_7_1714230-1874691.pdf> PU Series <https://www.mouser.com/datasheet/2/447/PYu-PU_51_RoHS_L_6-1504619.pdf> UCR Series <https://fscdn.rohm.com/en/products/databook/datasheet/passive/resistor/chip_resistor/ucr-e.pdf> ERA Series <https://www.mouser.com/datasheet/2/315/AOA0000C307-1149632.pdf> PWR263 Series <https://www.mouser.com/datasheet/2/54/pwr263s_35-778069.pdf> KTR Series <https://www.mouser.com/datasheet/2/348/ROHM_S_A0011075115_1-2563276.pdf> RC Series <https://www.mouser.com/datasheet/2/447/Yageo_03_18_2021_PYu_RC_Group_51_RoHS_L_11-2199992.pdf> ERJ Low Resistance Series <https://www.mouser.com/datasheet/2/315/AOA0000C313-1141758.pdf> ERJ PB3, PB6 Series <https://www.mouser.com/datasheet/2/315/AOA0000C328-1530132.pdf> ERJ UP3, UP6, UP8 Series <https://www.mouser.com/datasheet/2/315/Panasonic_Resistors_Thick_Film_Anti_Sulf_Anti_Surg-1825099.pdf> ERJ PA2, P03, PA3, P06, P08, P14 Series <https://www.mouser.com/datasheet/2/315/AOA0000C331-1141874.pdf> B20 Series <https://www.ohmite.com/assets/docs/res_200.pdf?r=false> TE Connectivity/Holsworthy RN73 Series <https://www.mouser.com/datasheet/2/418/4/NG_DS_1773270_M-604713.pdf> Vishay Dale D/CRCW e3 <https://www.mouser.com/datasheet/2/427/dcrcwe3-1762152.pdf> Ohmite B20 <https://www.ohmite.com/assets/docs/res_200.pdf?r=false>; DKPN: 764-1461-2-ND; MANUFACTURER: Vishay Dale Thin Film; MOPN: 71-PTN0603E8351BST1; MPN: PTN0603E8351BST1; POWER: 0.15W; RESISTANCE: 8.35k; TOLERANCE: 0.1%; VOLTAGE_CONTINUOUS: 28.90V; VOLTAGE_MAX: 75V
R144-R146 R148 = HyTechDevices:RESISTOR_?_*: Resistor PWR163 Series <https://www.mouser.com/datasheet/2/54/pwr163-777985.pdf> AC Series <https://www.mouser.com/datasheet/2/447/Yageo_PYu_AC_51_RoHS_L_7_1714230-1874691.pdf> PU Series <https://www.mouser.com/datasheet/2/447/PYu-PU_51_RoHS_L_6-1504619.pdf> UCR Series <https://fscdn.rohm.com/en/products/databook/datasheet/passive/resistor/chip_resistor/ucr-e.pdf> ERA Series <https://www.mouser.com/datasheet/2/315/AOA0000C307-1149632.pdf> PWR263 Series <https://www.mouser.com/datasheet/2/54/pwr263s_35-778069.pdf> KTR Series <https://www.mouser.com/datasheet/2/348/ROHM_S_A0011075115_1-2563276.pdf> RC Series <https://www.mouser.com/datasheet/2/447/Yageo_03_18_2021_PYu_RC_Group_51_RoHS_L_11-2199992.pdf> ERJ Low Resistance Series <https://www.mouser.com/datasheet/2/315/AOA0000C313-1141758.pdf> ERJ PB3, PB6 Series <https://www.mouser.com/datasheet/2/315/AOA0000C328-1530132.pdf> ERJ UP3, UP6, UP8 Series <https://www.mouser.com/datasheet/2/315/Panasonic_Resistors_Thick_Film_Anti_Sulf_Anti_Surg-1825099.pdf> ERJ PA2, P03, PA3, P06, P08, P14 Series <https://www.mouser.com/datasheet/2/315/AOA0000C331-1141874.pdf> B20 Series <https://www.ohmite.com/assets/docs/res_200.pdf?r=false> TE Connectivity/Holsworthy RN73 Series <https://www.mouser.com/datasheet/2/418/4/NG_DS_1773270_M-604713.pdf> Vishay Dale D/CRCW e3 <https://www.mouser.com/datasheet/2/427/dcrcwe3-1762152.pdf> Ohmite B20 <https://www.ohmite.com/assets/docs/res_200.pdf?r=false>; DKPN: 311-5.10KHRTR-ND; MANUFACTURER: Yageo; MOPN: 603-RC0603FR-075K1L; MPN: RC0603FR-075K1L; POWER: 0.1W; RESISTANCE: 5.1k; TOLERANCE: 1%; VOLTAGE_CONTINUOUS: 22.58V; VOLTAGE_MAX: 75V
S1 = HyTechDevices:BUTTON: Button Datasheet <https://www.mouser.com/datasheet/2/307/en_b3s-1221332.pdf>; DKPN: SW415-ND; MANUFACTURER: Omron; MOPN: 653-B3S-1000; MPN: B3S-1000
U1 = HyTechDevices:VOLTAGE_REGULATOR_?_*: Voltage Regulators LDL1117S50R Datasheet <https://www.mouser.com/datasheet/2/389/dm00366442-1799212.pdf> NCP785AH120T1G <https://www.mouser.com/datasheet/2/308/NCP785A_D-1812704.pdf> LMS8117A Datasheet <https://www.ti.com/lit/ds/symlink/lms8117a.pdf?HQS> ST732M50R Datasheet <https://www.mouser.com/datasheet/2/389/st732-1830546.pdf> LM2937IMPX-10/NOPB Datasheet <https://www.ti.com/lit/ds/symlink/lm2937.pdf> L78L15ACUTR Datasheet <https://www.mouser.com/datasheet/2/389/l78l-1849295.pdf>; DKPN: LMS8117AMP-3.3/NOPBCT-ND; MANUFACTURER: Texas Instruments; MOPN: 926-LMS8117AMP33NOPB; MPN: LMS8117AMP-3.3/NOPB
U2 U6 = HyTechDevices:MCP3208: Microchip MCP3208 ADC 8-channel 12-bit SPI Datasheet <https://www.mouser.com/datasheet/2/268/21298e-1101808.pdf>; DKPN: MCP3208T-BI/SLCT-ND; MANUFACTURER: Microchip Technology; MOPN: 579-MCP3208T-BI/SL; MPN: MCP3208T-BI/SL
U3 U5 U7 = HyTechDevices:OPAMP_1_CHANNEL_*: Op-Amp 1 Channel OPA991 Datasheet <https://www.ti.com/lit/ds/symlink/opa991.pdf?ts=1615503614502> Note: OPA991 is also a comparator; DKPN: 296-OPA991IDCKRCT-ND; MANUFACTURER: Texas Instruments; MOPN: 595-OPA991IDCKR; MPN: OPA991IDCKR
U4 U14 U29 U30 = HyTechDevices:TCAN1051*V-Q1: TCAN1051*V Can Tranciever Datasheet <https://www.ti.com/lit/ds/symlink/tcan1051hgv-q1.pdf?HQS=dis-mous-null-mousermode-dsf-pf-null-wwe&ts=1610765132518&ref_url=https%253A%252F%252Fwww.mouser.com%252Ff>; DKPN: 296-49935-1-ND; MANUFACTURER: Texas Instruments; MOPN: 595-TCAN1051HGVDQ1; MPN: TCAN1051HGVDRQ1
U8-U12 = HyTechDevices:LOGICGATE_OR: OR Gate SN74LVC Datasheet <https://www.ti.com/lit/ds/symlink/sn74lvc1g34.pdf>; DKPN: 296-22348-2-ND; MANUFACTURER: Texas Instruments; MOPN: 595-SN74LVC32IDCKREP; MPN: SN74LVC1G32IDCKREP
U13 = HyTechDevices:LOGICGATE_NOR: NOR Gate SN74LVC Datasheet <https://www.ti.com/lit/ds/symlink/sn74lvc1g02.pdf>; DKPN: 296-11598-1-ND; MANUFACTURER: Texas Instruments; MOPN: 595-SN74LVC1G02DCKR; MPN: SN74LVC1G02DCKR
U15 = HyTechDevices:LOGICGATE_AND_: AND Gate SN74LVC Datasheet <https://www.ti.com/lit/ds/symlink/sn74lvc1g08.pdf>; DKPN: 296-SN74LVC1G08DCK3TR-ND; MANUFACTURER: Texas Instruments; MOPN: 595-SN74LVC1G08DCK3; MPN: SN74LVC1G08DCK3
U16 = HyTechDevices:MAX3074EESA+: Maxim Integrated MAX3074EESA+ Datasheet <https://www.mouser.com/datasheet/2/609/MAX3070E_MAX3079E-3128184.pdf>; DKPN: MAX3074EESA+-ND; MANUFACTURER: Maxim Integrated; MOPN: 700-MAX3074EESA; MPN: MAX3074EESA+
U17 U18 = HyTechDevices:MAX74*: 8th-Order Maxim Filter MAX7480 Datasheet <https://www.mouser.com/datasheet/2/256/MAX7480-1515905.pdf> MAX7400 Datsheet <https://www.mouser.com/datasheet/2/256/MAX7404-1514314.pdf> Recommended clock capacitor for the MAX7400/MAX7404: 885012006013 <https://www.mouser.com/datasheet/2/445/885012006013-1726946.pdf>; DKPN: MAX7400CSA+-ND; MANUFACTURER: Maxim Integrated; MOPN: 700-MAX7400CSA; MPN: MAX7400CSA+
U19-U28 U32 U33 = HyTechDevices:OPAMP_2_CHANNEL_*: Op-Amp 2 Channel OPA2991 Datasheet <https://www.ti.com/lit/ds/symlink/opa2991.pdf?HQS=dis-mous-null-mousermode-dsf-pf-null-wwe&ts=1697521669896&ref_url=https%253A%252F%252Fwww.mouser.com%252F> Note: OPA2991 is also a comparator; DKPN: 296-OPA2991IDDFRCT-ND; MANUFACTURER: Texas Instruments; MOPN: 595-OPA2991IDDFR; MPN: OPA2991IDDFR
U31 = HyTechDevices:ADM8316: ADM8316 Watchdog Datasheet <https://www.mouser.com/datasheet/2/609/adm8316_8318_8319_8320_8321_8322-1503275.pdf>; DKPN: ADM8316WBX30ARJZR7TR-ND; MANUFACTURER: Analog Devices Inc.; MOPN: 584-M8316WBX30ARJZR7; MPN: ADM8316WBX30ARJZR7; RESET_VOLTAGE: 3V; TIMEOUT: 102ms
VR1 VR2 = HyTechDevices:RESISTOR_TRIMPOT_*_?: Variable Resistor Bourns 3362P Datasheet <https://www.mouser.com/datasheet/2/54/3362-776956.pdf>; DKPN: 3362P-103LF-ND; MANUFACTURER: Bourns Inc.; MOPN: 652-3362P-1-103LF; MPN: 3362P-1-103LF; POWER: 0.5W; RESISTANCE: 10k; TOLERANCE: 10%; VOLTAGE: 70.711V
XB1 = HyTechDevices:BATTERY_HOLDER_*: Keystone 498 1/3N Cell Holder PN for the holder; if 1/3N batteries needed, order separately. Datasheet <https://www.mouser.com/datasheet/2/215/98-745913.pdf>; BATTERY_TYPE: 1/3N; DKPN: 36-498-ND; MANUFACTURER: Keystone Electronics; MOPN: 534-498; MPN: 498

## Net classes
1 diff pairs: width 0.254 mm